# EAGLE schematic 10MHzRefOsc_3V0 (EAGLE 7.2.0), part 1 of 2
DF4IAH - 10 MHz Reference Oscillator

## Sheet 1 of 28: Overview
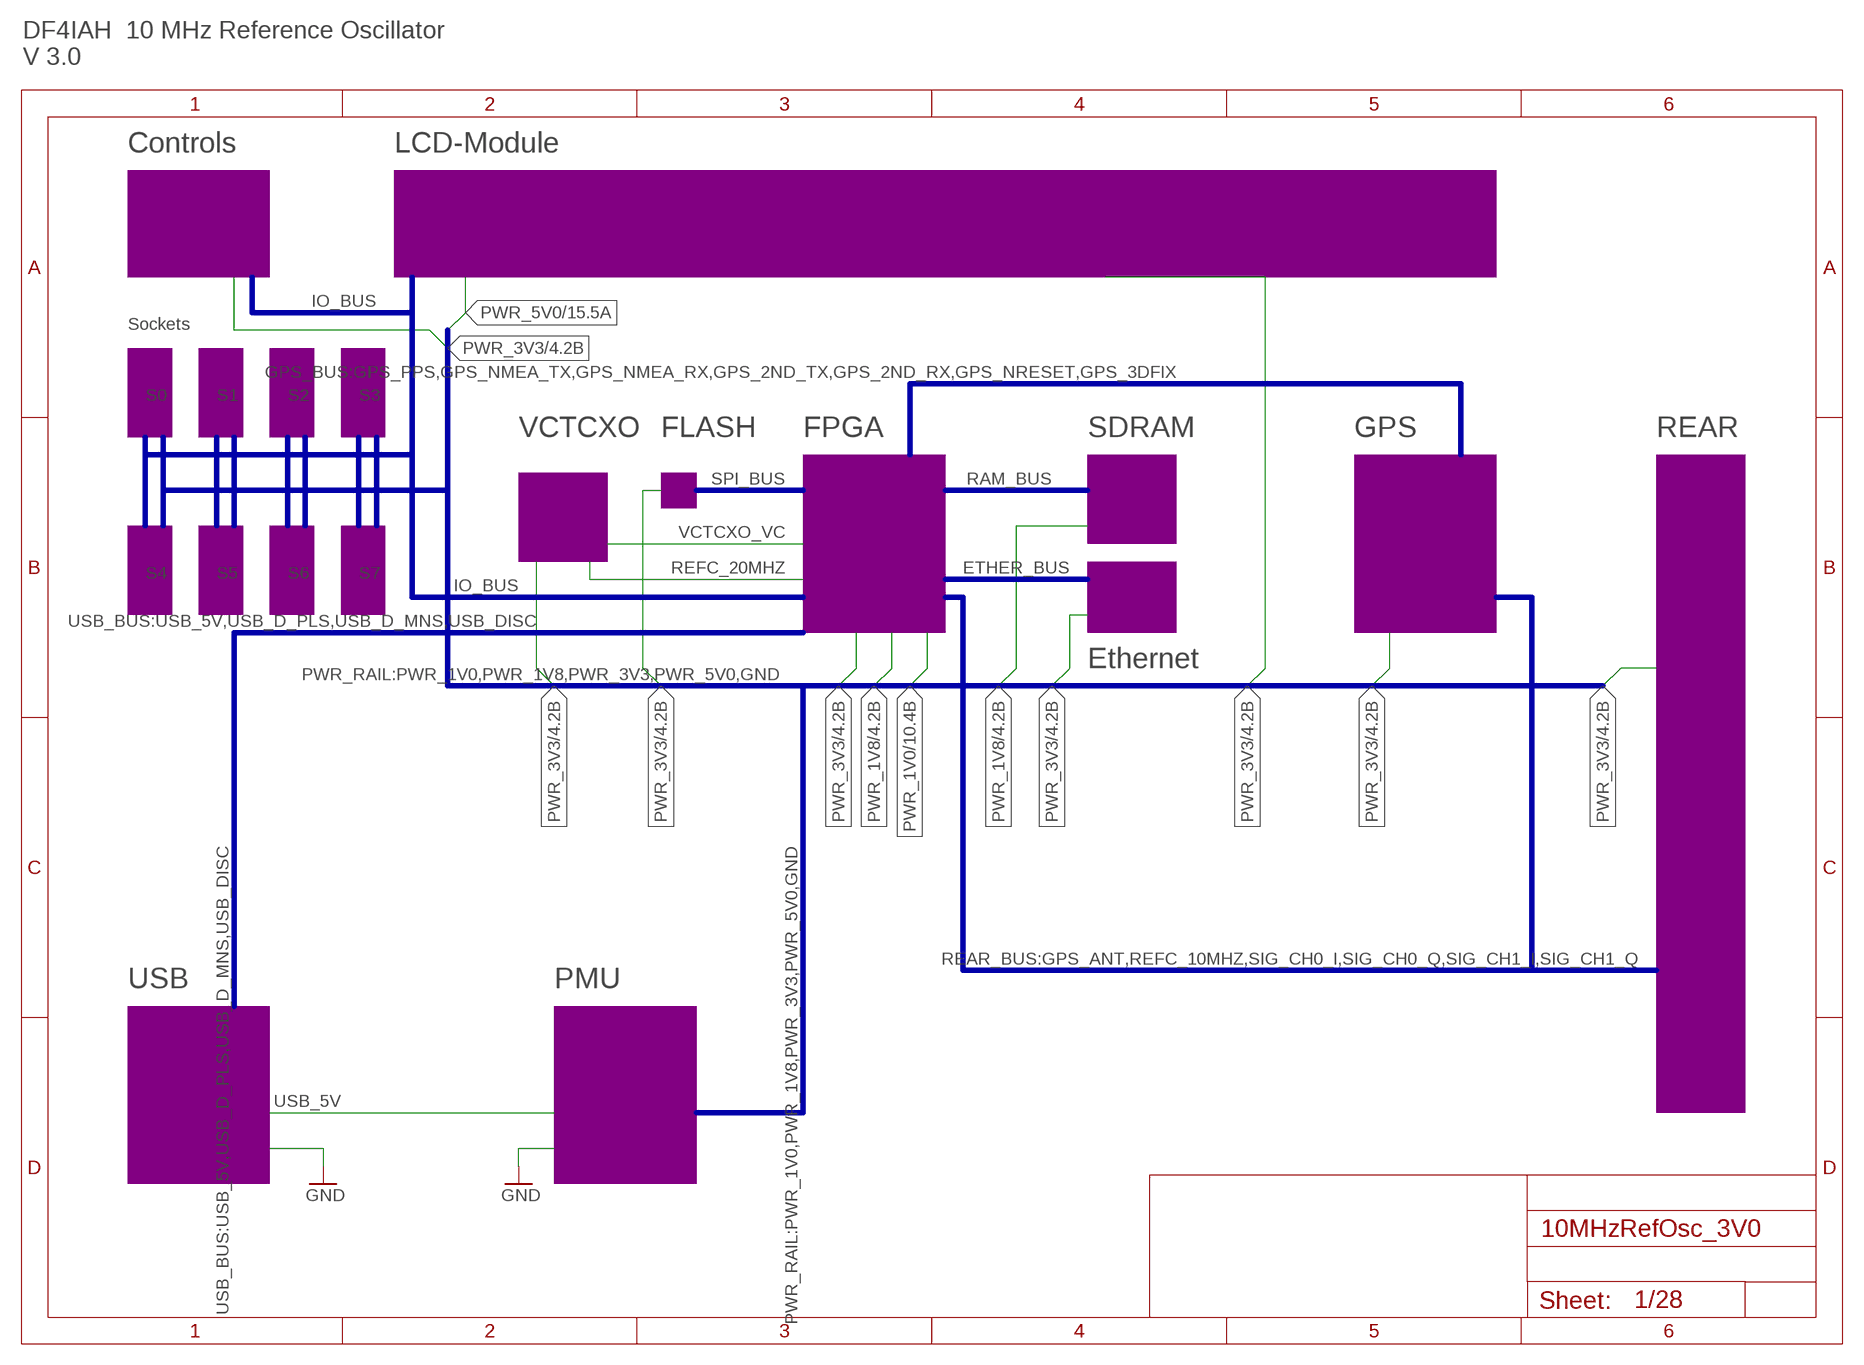
[diagram p0: schematic, sheet 1]

### Buses
USB_BUS:USB_5V,USB_D_PLS,USB_D_MNS,USB_DISC
PWR_RAIL:PWR_1V0,PWR_1V8,PWR_3V3,PWR_5V0,GND
GPS_BUS:GPS_PPS,GPS_NMEA_TX,GPS_NMEA_RX,GPS_2ND_TX,GPS_2ND_RX,GPS_NRESET,GPS_3DFIX
REAR_BUS:GPS_ANT,REFC_10MHZ,SIG_CH0_I,SIG_CH0_Q,SIG_CH1_I,SIG_CH1_Q
IO_BUS
RAM_BUS
ETHER_BUS
SPI_BUS

### Notes on the sheet
- DF4IAH  10 MHz Reference Oscillator
  V 3.0
- Controls | LCD-Module
- Sockets
- S0 | S1 | S2 | S3
- VCTCXO | FLASH | FPGA | SDRAM | GPS | REAR
- S4 | S5 | S6 | S7
- Ethernet
- USB | PMU

## Sheet 2 of 28: PMU
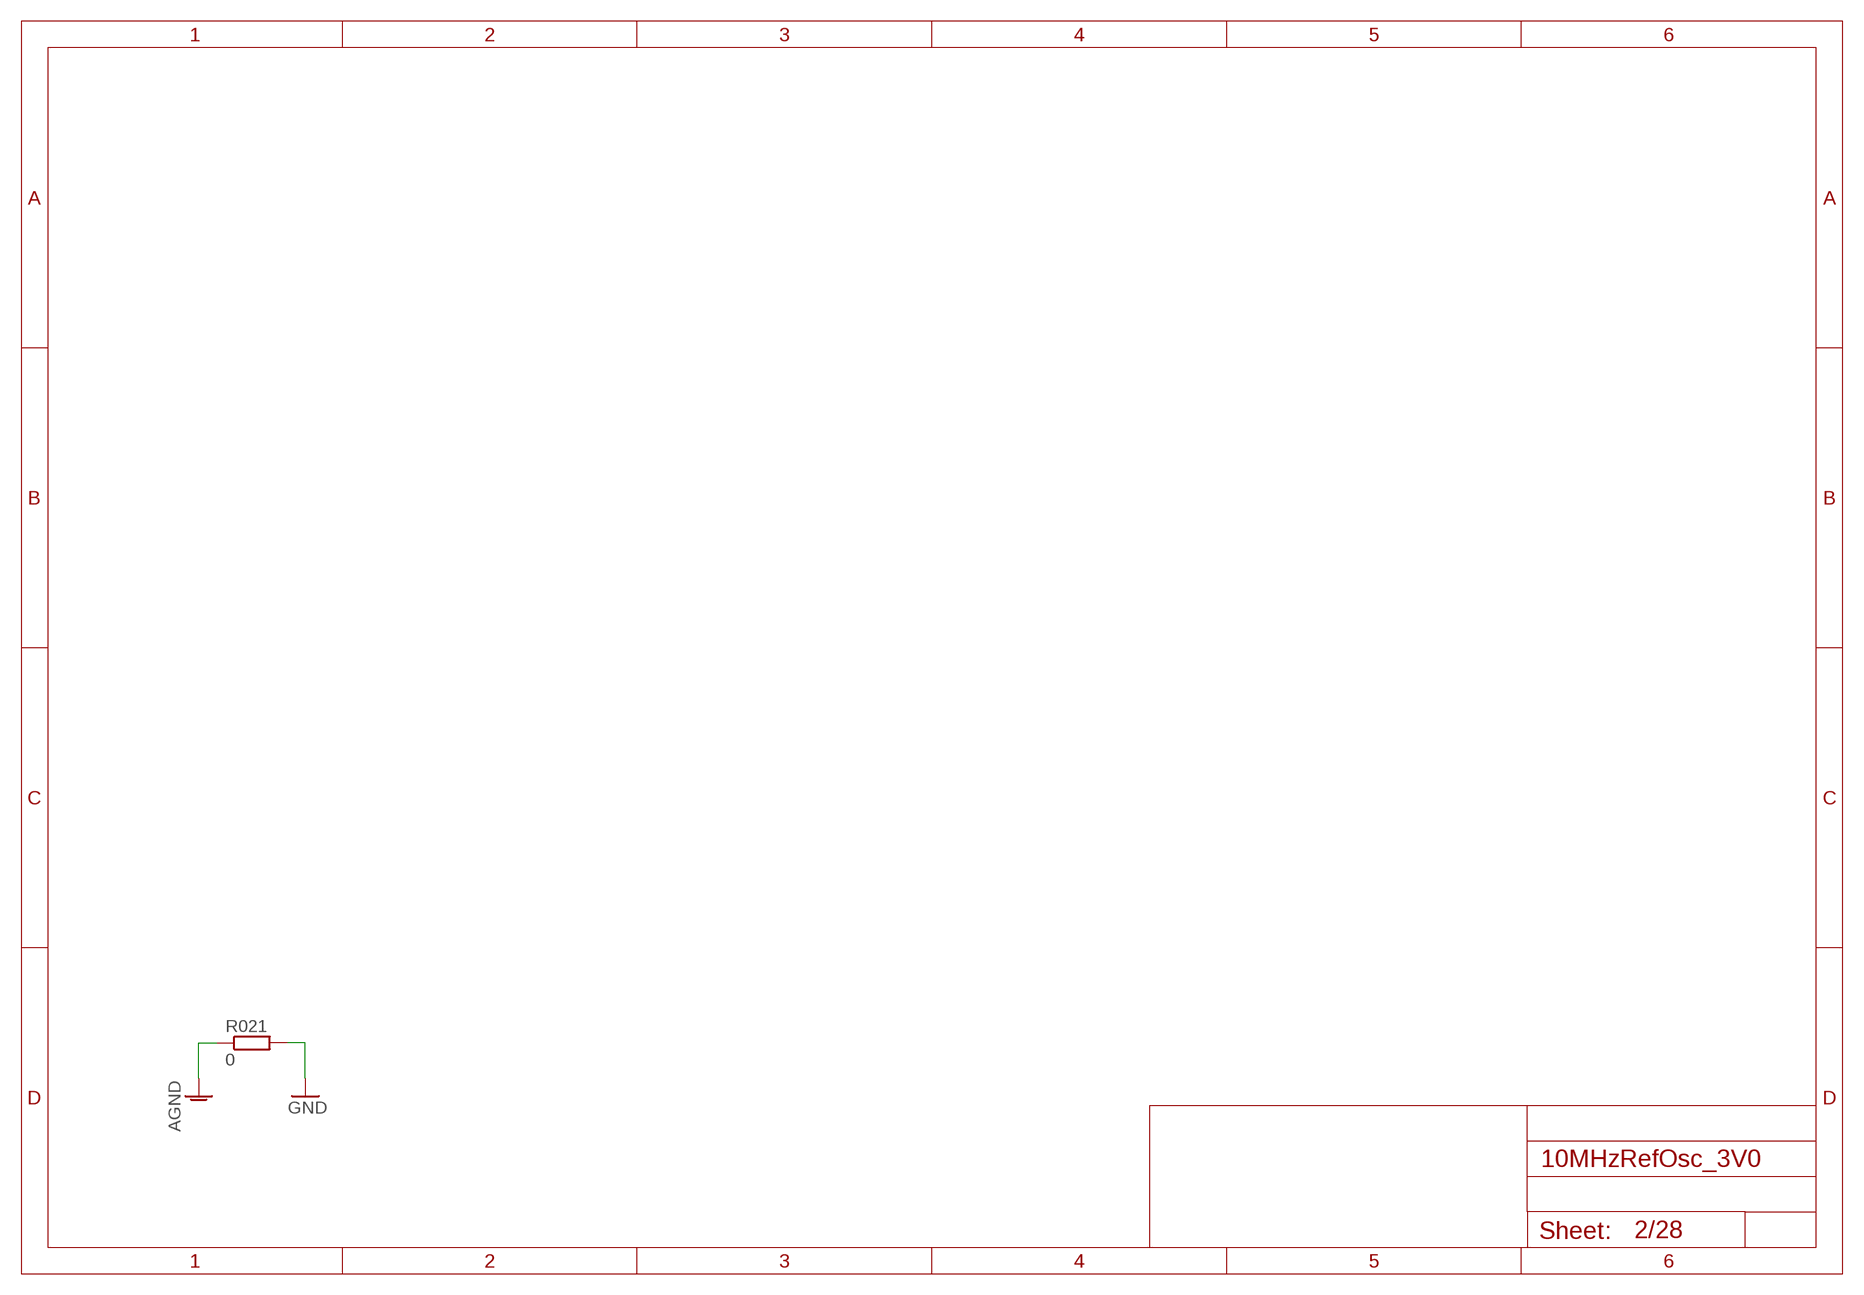
[diagram p1: schematic, sheet 2]

### Parts
R021  0  R-EU_R0805  [R0805]

### Nets
AGND: R021.1 ; also sheet 9
GND: R021.2 ; also sheet 1,3,4,5,6,7,8,9,10,14,15,18,19

## Sheet 3 of 28: VCTCXO
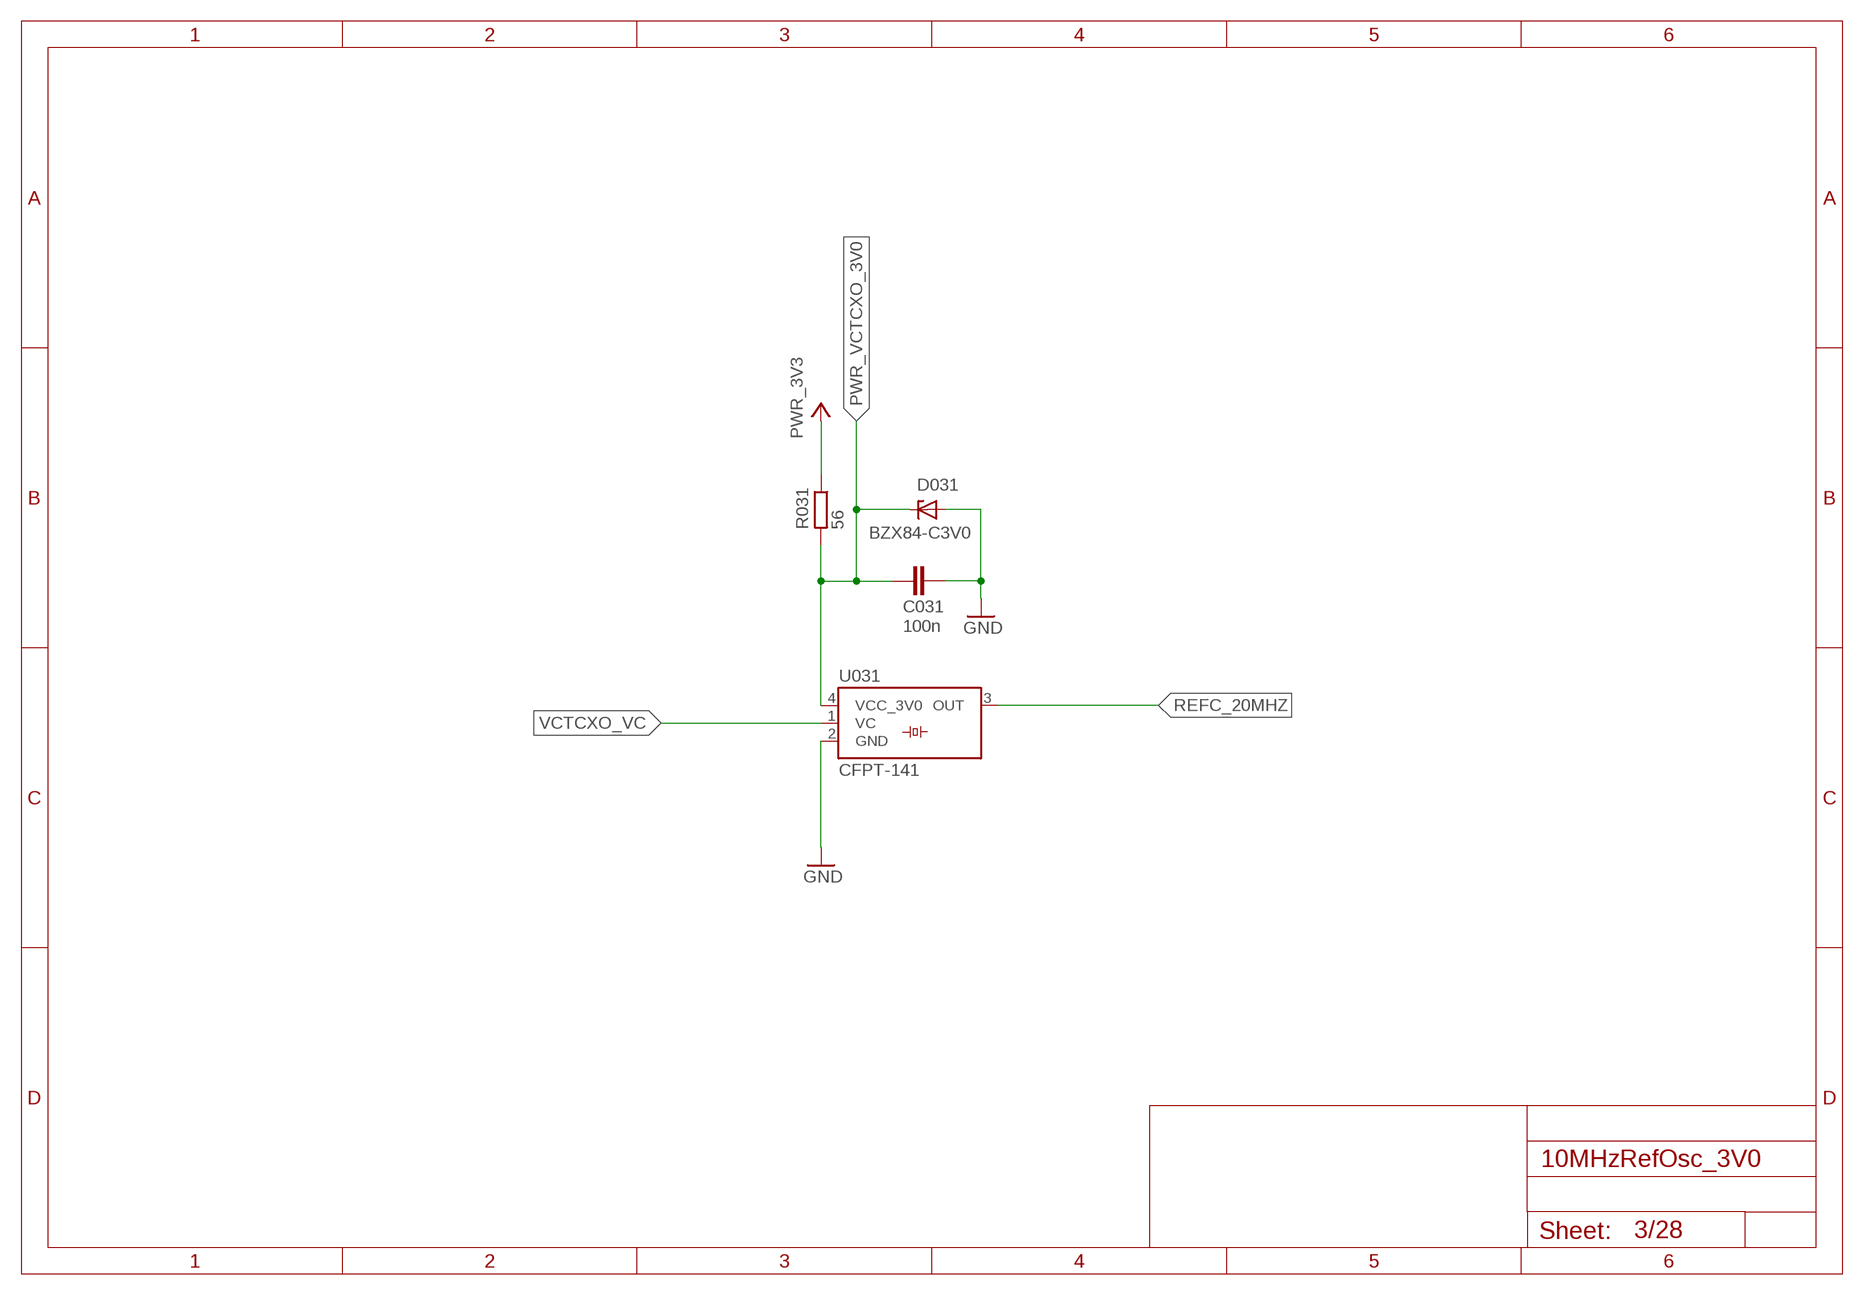
[diagram p2: schematic, sheet 3]

### Parts
C031  100n  C-EUC0805  [C0805]
D031  BZX84-C3V0  BZX84CSMD  [TO236]
R031  56  R-EU_R0805  [R0805]
U031  CFPT-141  [CFPT-141]

### Nets
GND: C031.2 D031.A U031.2(GND) ; also sheet 1,2,4,5,6,7,8,9,10,14,15,18,19
PWR_3V3 [PWR_MED]: R031.1 ; also sheet 1,4,5,6,7,8,15
PWR_VCTCXO_3V0 [PWR_LOW]: C031.1 D031.C R031.2 U031.4(VCC_3V0)
REFC_20MHZ [CLK]: U031.3(OUT) ; also sheet 1
VCTCXO_VC: U031.1(VC) ; also sheet 1

## Sheet 4 of 28: FPGA_B0_1of7
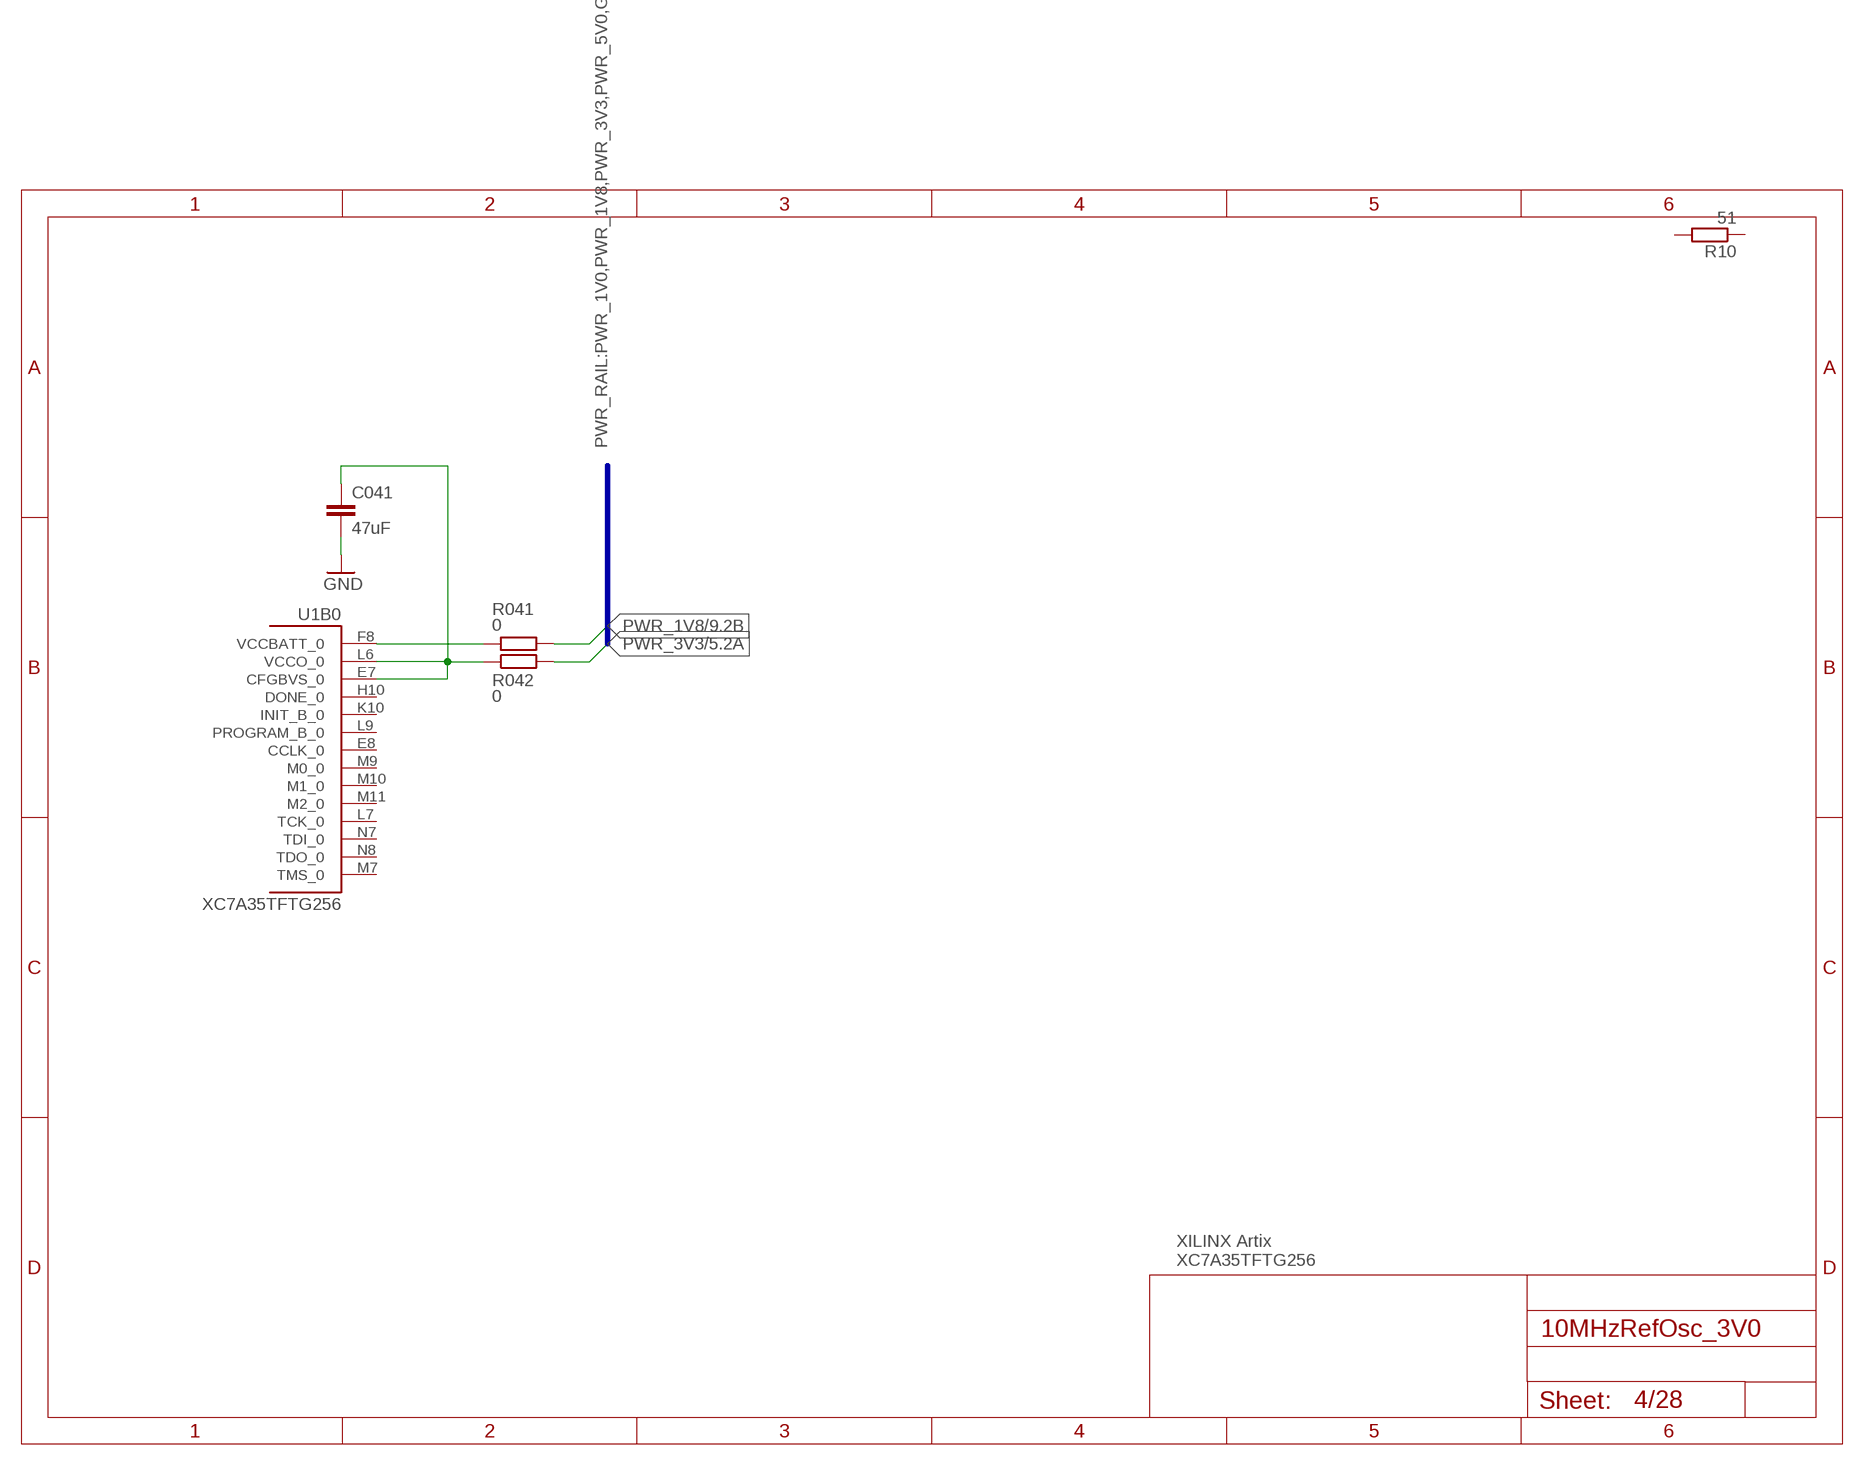
[diagram p3: schematic, sheet 4]

### Parts
C041  47uF  C-EUC0805  [C0805]
R10  51  R-EU_R0805  [R0805]
R041  0  R-EU_R0402  [R0402]
R042  0  R-EU_R0402  [R0402]
U1  XC7A35TFTG256  [FTG256_0MM4]

### Nets
FPGA_VCCBATT: R041.1 U1.F8(B0:VCCBATT_0)
FPGA_VCCO_0: C041.1 R042.1 U1.E7(B0:CFGBVS_0) U1.L6(B0:VCCO_0)
GND: C041.2 ; also sheet 1,2,3,5,6,7,8,9,10,14,15,18,19
PWR_1V8 [PWR_LOW]: R041.2 ; also sheet 1,9,10
PWR_3V3 [PWR_MED]: R042.2 ; also sheet 1,3,5,6,7,8,15
Unconnected: R10.1 R10.2 U1.E8(B0:CCLK_0) U1.H10(B0:DONE_0) U1.K10(B0:INIT_B_0) U1.L7(B0:TCK_0) U1.L9(B0:PROGRAM_B_0) U1.M7(B0:TMS_0) U1.M9(B0:M0_0) U1.M10(B0:M1_0) U1.M11(B0:M2_0) U1.N7(B0:TDI_0) U1.N8(B0:TDO_0)

### Buses
PWR_RAIL:PWR_1V0,PWR_1V8,PWR_3V3,PWR_5V0,GND

### Notes on the sheet
- XILINX Artix
  XC7A35TFTG256

## Sheet 5 of 28: FPGA_B14_2of7
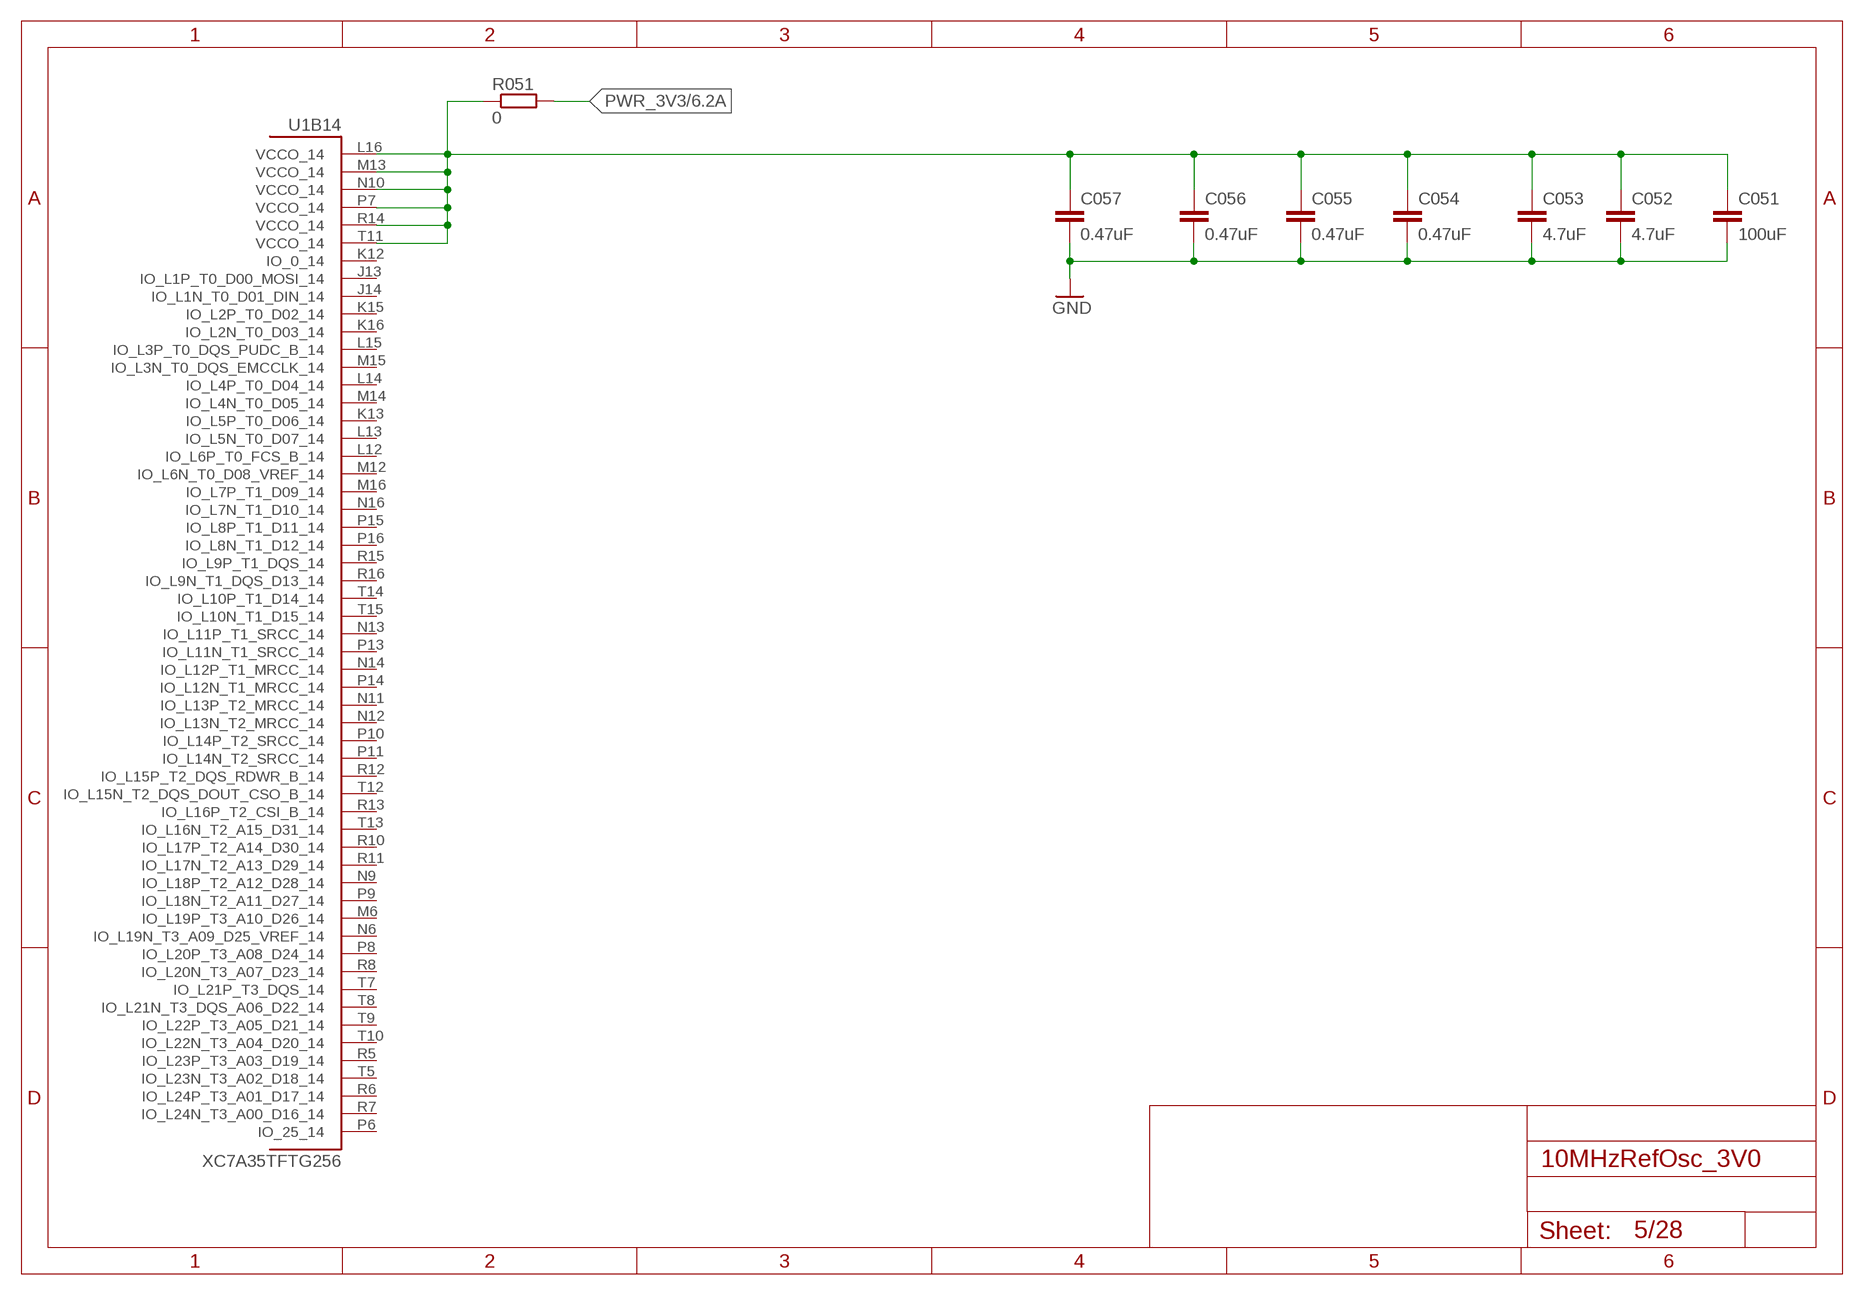
[diagram p4: schematic, sheet 5]

### Parts
C051  100uF  C-EUC1206  [C1206]
C052  4.7uF  C-EUC0402  [C0402]
C053  4.7uF  C-EUC0402  [C0402]
C054  0.47uF  C-EUC0402  [C0402]
C055  0.47uF  C-EUC0402  [C0402]
C056  0.47uF  C-EUC0402  [C0402]
C057  0.47uF  C-EUC0402  [C0402]
R051  0  R-EU_R0402  [R0402]

### Nets
FPGA_VCCO_14: C051.1 C052.1 C053.1 C054.1 C055.1 C056.1 C057.1 R051.1 U1.L16(B14:VCCO_14) U1.M13(B14:VCCO_14) U1.N10(B14:VCCO_14) U1.P7(B14:VCCO_14) U1.R14(B14:VCCO_14) U1.T11(B14:VCCO_14)
GND: C051.2 C052.2 C053.2 C054.2 C055.2 C056.2 C057.2 ; also sheet 1,2,3,4,6,7,8,9,10,14,15,18,19
PWR_3V3 [PWR_MED]: R051.2 ; also sheet 1,3,4,6,7,8,15
Unconnected: U1.J13(B14:IO_L1P_T0_D00_MOSI_14) U1.J14(B14:IO_L1N_T0_D01_DIN_14) U1.K12(B14:IO_0_14) U1.K13(B14:IO_L5P_T0_D06_14) U1.K15(B14:IO_L2P_T0_D02_14) U1.K16(B14:IO_L2N_T0_D03_14) U1.L12(B14:IO_L6P_T0_FCS_B_14) U1.L13(B14:IO_L5N_T0_D07_14) U1.L14(B14:IO_L4P_T0_D04_14) U1.L15(B14:IO_L3P_T0_DQS_PUDC_B_14) U1.M6(B14:IO_L19P_T3_A10_D26_14) U1.M12(B14:IO_L6N_T0_D08_VREF_14) U1.M14(B14:IO_L4N_T0_D05_14) U1.M15(B14:IO_L3N_T0_DQS_EMCCLK_14) U1.M16(B14:IO_L7P_T1_D09_14) U1.N6(B14:IO_L19N_T3_A09_D25_VREF_14) U1.N9(B14:IO_L18P_T2_A12_D28_14) U1.N11(B14:IO_L13P_T2_MRCC_14) U1.N12(B14:IO_L13N_T2_MRCC_14) U1.N13(B14:IO_L11P_T1_SRCC_14) U1.N14(B14:IO_L12P_T1_MRCC_14) U1.N16(B14:IO_L7N_T1_D10_14) U1.P6(B14:IO_25_14) U1.P8(B14:IO_L20P_T3_A08_D24_14) U1.P9(B14:IO_L18N_T2_A11_D27_14) U1.P10(B14:IO_L14P_T2_SRCC_14) U1.P11(B14:IO_L14N_T2_SRCC_14) U1.P13(B14:IO_L11N_T1_SRCC_14) U1.P14(B14:IO_L12N_T1_MRCC_14) U1.P15(B14:IO_L8P_T1_D11_14) U1.P16(B14:IO_L8N_T1_D12_14) U1.R5(B14:IO_L23P_T3_A03_D19_14) U1.R6(B14:IO_L24P_T3_A01_D17_14) U1.R7(B14:IO_L24N_T3_A00_D16_14) U1.R8(B14:IO_L20N_T3_A07_D23_14) U1.R10(B14:IO_L17P_T2_A14_D30_14) U1.R11(B14:IO_L17N_T2_A13_D29_14) U1.R12(B14:IO_L15P_T2_DQS_RDWR_B_14) U1.R13(B14:IO_L16P_T2_CSI_B_14) U1.R15(B14:IO_L9P_T1_DQS_14) U1.R16(B14:IO_L9N_T1_DQS_D13_14) U1.T5(B14:IO_L23N_T3_A02_D18_14) U1.T7(B14:IO_L21P_T3_DQS_14) U1.T8(B14:IO_L21N_T3_DQS_A06_D22_14) U1.T9(B14:IO_L22P_T3_A05_D21_14) U1.T10(B14:IO_L22N_T3_A04_D20_14) U1.T12(B14:IO_L15N_T2_DQS_DOUT_CSO_B_14) U1.T13(B14:IO_L16N_T2_A15_D31_14) U1.T14(B14:IO_L10P_T1_D14_14) U1.T15(B14:IO_L10N_T1_D15_14)

## Sheet 6 of 28: FPGA_B15_3of7
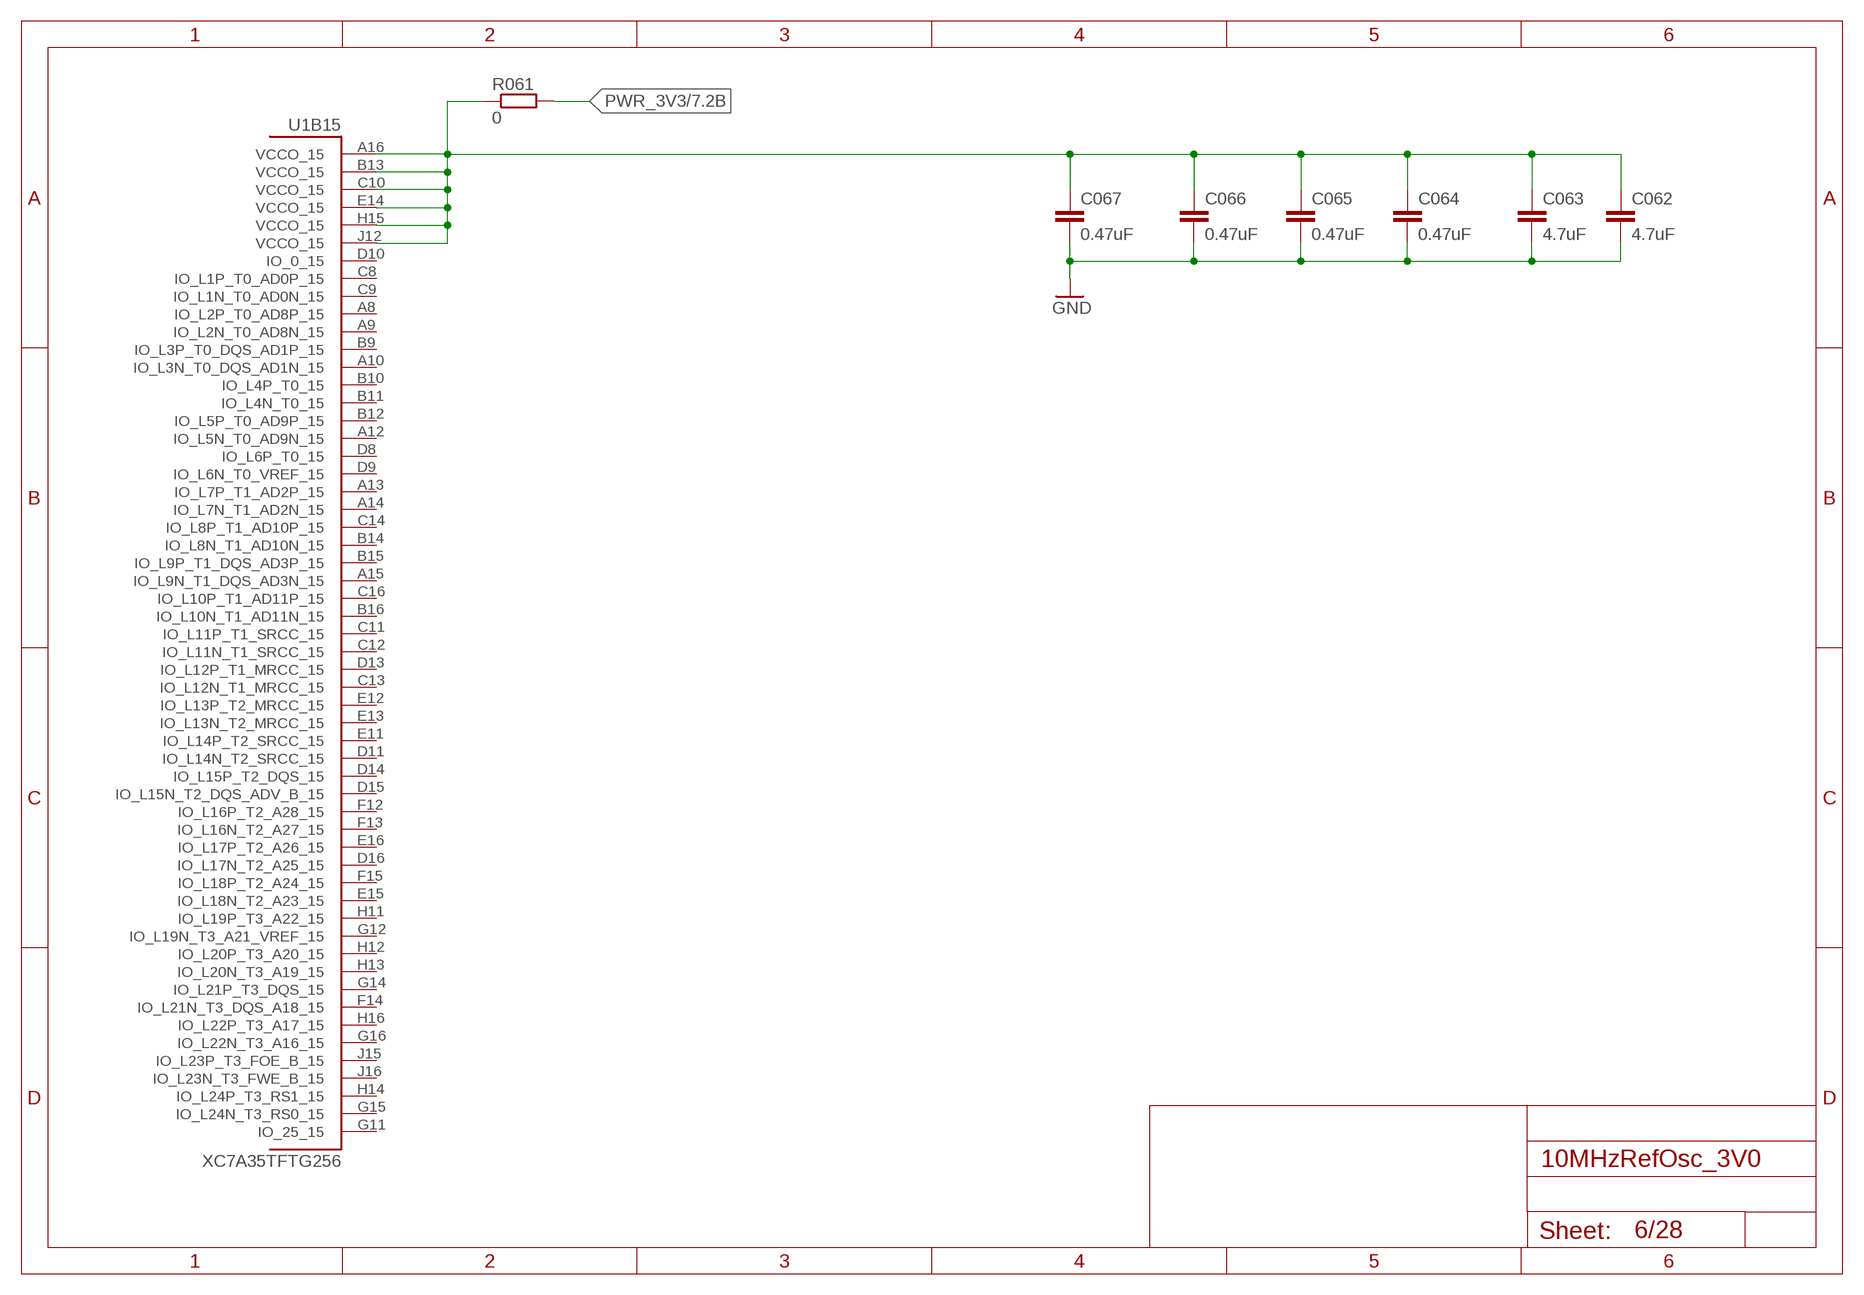
[diagram p5: schematic, sheet 6]

### Parts
C062  4.7uF  C-EUC0402  [C0402]
C063  4.7uF  C-EUC0402  [C0402]
C064  0.47uF  C-EUC0402  [C0402]
C065  0.47uF  C-EUC0402  [C0402]
C066  0.47uF  C-EUC0402  [C0402]
C067  0.47uF  C-EUC0402  [C0402]
R061  0  R-EU_R0402  [R0402]

### Nets
FPGA_VCCO_15: C062.1 C063.1 C064.1 C065.1 C066.1 C067.1 R061.1 U1.A16(B15:VCCO_15) U1.B13(B15:VCCO_15) U1.C10(B15:VCCO_15) U1.E14(B15:VCCO_15) U1.H15(B15:VCCO_15) U1.J12(B15:VCCO_15)
GND: C062.2 C063.2 C064.2 C065.2 C066.2 C067.2 ; also sheet 1,2,3,4,5,7,8,9,10,14,15,18,19
PWR_3V3 [PWR_MED]: R061.2 ; also sheet 1,3,4,5,7,8,15
Unconnected: U1.A8(B15:IO_L2P_T0_AD8P_15) U1.A9(B15:IO_L2N_T0_AD8N_15) U1.A10(B15:IO_L3N_T0_DQS_AD1N_15) U1.A12(B15:IO_L5N_T0_AD9N_15) U1.A13(B15:IO_L7P_T1_AD2P_15) U1.A14(B15:IO_L7N_T1_AD2N_15) U1.A15(B15:IO_L9N_T1_DQS_AD3N_15) U1.B9(B15:IO_L3P_T0_DQS_AD1P_15) U1.B10(B15:IO_L4P_T0_15) U1.B11(B15:IO_L4N_T0_15) U1.B12(B15:IO_L5P_T0_AD9P_15) U1.B14(B15:IO_L8N_T1_AD10N_15) U1.B15(B15:IO_L9P_T1_DQS_AD3P_15) U1.B16(B15:IO_L10N_T1_AD11N_15) U1.C8(B15:IO_L1P_T0_AD0P_15) U1.C9(B15:IO_L1N_T0_AD0N_15) U1.C11(B15:IO_L11P_T1_SRCC_15) U1.C12(B15:IO_L11N_T1_SRCC_15) U1.C13(B15:IO_L12N_T1_MRCC_15) U1.C14(B15:IO_L8P_T1_AD10P_15) U1.C16(B15:IO_L10P_T1_AD11P_15) U1.D8(B15:IO_L6P_T0_15) U1.D9(B15:IO_L6N_T0_VREF_15) U1.D10(B15:IO_0_15) U1.D11(B15:IO_L14N_T2_SRCC_15) U1.D13(B15:IO_L12P_T1_MRCC_15) U1.D14(B15:IO_L15P_T2_DQS_15) U1.D15(B15:IO_L15N_T2_DQS_ADV_B_15) U1.D16(B15:IO_L17N_T2_A25_15) U1.E11(B15:IO_L14P_T2_SRCC_15) U1.E12(B15:IO_L13P_T2_MRCC_15) U1.E13(B15:IO_L13N_T2_MRCC_15) U1.E15(B15:IO_L18N_T2_A23_15) U1.E16(B15:IO_L17P_T2_A26_15) U1.F12(B15:IO_L16P_T2_A28_15) U1.F13(B15:IO_L16N_T2_A27_15) U1.F14(B15:IO_L21N_T3_DQS_A18_15) U1.F15(B15:IO_L18P_T2_A24_15) U1.G11(B15:IO_25_15) U1.G12(B15:IO_L19N_T3_A21_VREF_15) U1.G14(B15:IO_L21P_T3_DQS_15) U1.G15(B15:IO_L24N_T3_RS0_15) U1.G16(B15:IO_L22N_T3_A16_15) U1.H11(B15:IO_L19P_T3_A22_15) U1.H12(B15:IO_L20P_T3_A20_15) U1.H13(B15:IO_L20N_T3_A19_15) U1.H14(B15:IO_L24P_T3_RS1_15) U1.H16(B15:IO_L22P_T3_A17_15) U1.J15(B15:IO_L23P_T3_FOE_B_15) U1.J16(B15:IO_L23N_T3_FWE_B_15)

## Sheet 7 of 28: FPGA_B34_4of7
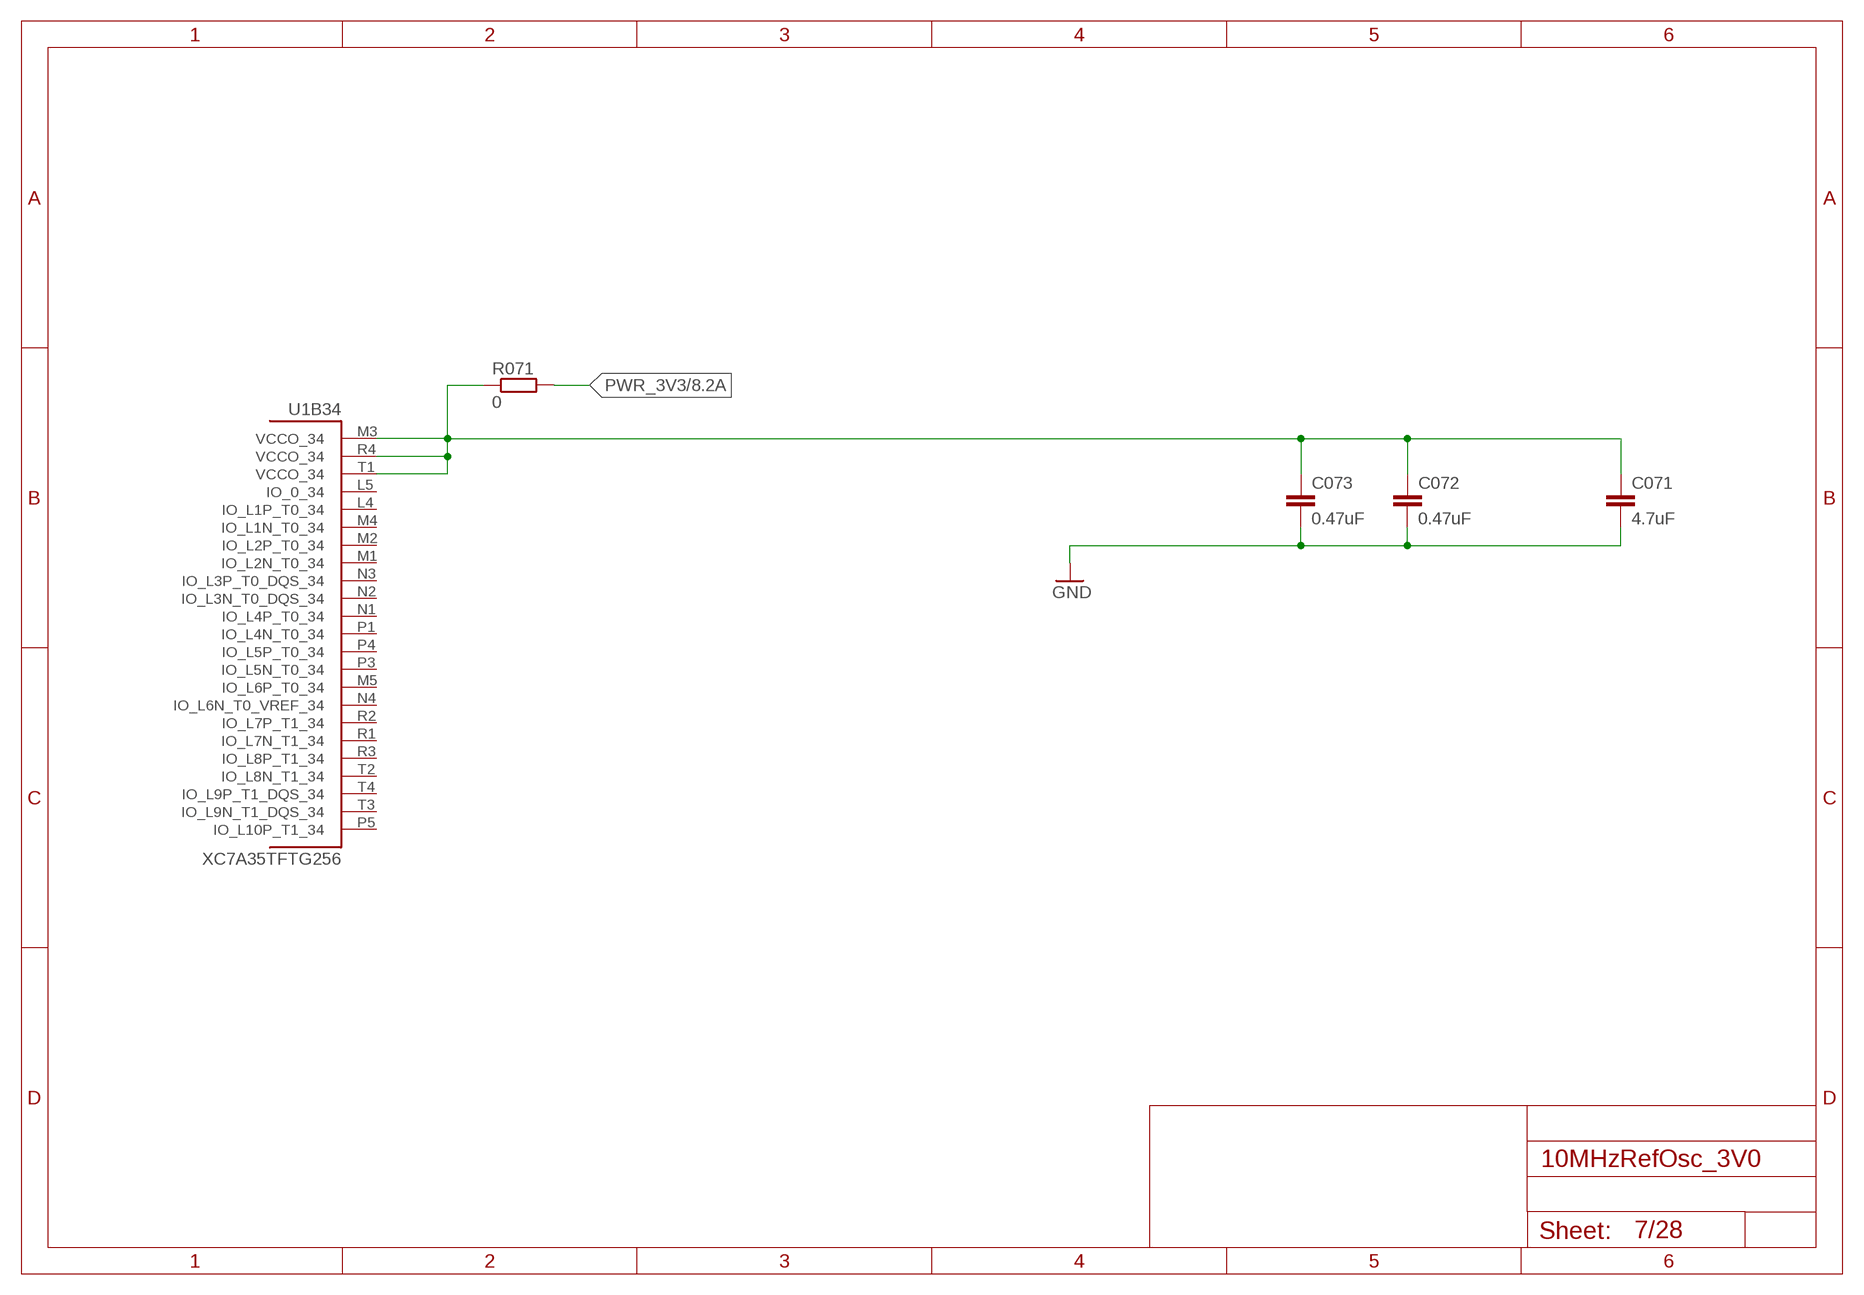
[diagram p6: schematic, sheet 7]

### Parts
C071  4.7uF  C-EUC0402  [C0402]
C072  0.47uF  C-EUC0402  [C0402]
C073  0.47uF  C-EUC0402  [C0402]
R071  0  R-EU_R0402  [R0402]

### Nets
FPGA_VCCO_34: C071.1 C072.1 C073.1 R071.1 U1.M3(B34:VCCO_34) U1.R4(B34:VCCO_34) U1.T1(B34:VCCO_34)
GND: C071.2 C072.2 C073.2 ; also sheet 1,2,3,4,5,6,8,9,10,14,15,18,19
PWR_3V3 [PWR_MED]: R071.2 ; also sheet 1,3,4,5,6,8,15
Unconnected: U1.L4(B34:IO_L1P_T0_34) U1.L5(B34:IO_0_34) U1.M1(B34:IO_L2N_T0_34) U1.M2(B34:IO_L2P_T0_34) U1.M4(B34:IO_L1N_T0_34) U1.M5(B34:IO_L6P_T0_34) U1.N1(B34:IO_L4P_T0_34) U1.N2(B34:IO_L3N_T0_DQS_34) U1.N3(B34:IO_L3P_T0_DQS_34) U1.N4(B34:IO_L6N_T0_VREF_34) U1.P1(B34:IO_L4N_T0_34) U1.P3(B34:IO_L5N_T0_34) U1.P4(B34:IO_L5P_T0_34) U1.P5(B34:IO_L10P_T1_34) U1.R1(B34:IO_L7N_T1_34) U1.R2(B34:IO_L7P_T1_34) U1.R3(B34:IO_L8P_T1_34) U1.T2(B34:IO_L8N_T1_34) U1.T3(B34:IO_L9N_T1_DQS_34) U1.T4(B34:IO_L9P_T1_DQS_34)

## Sheet 8 of 28: FPGA_B35_5of7
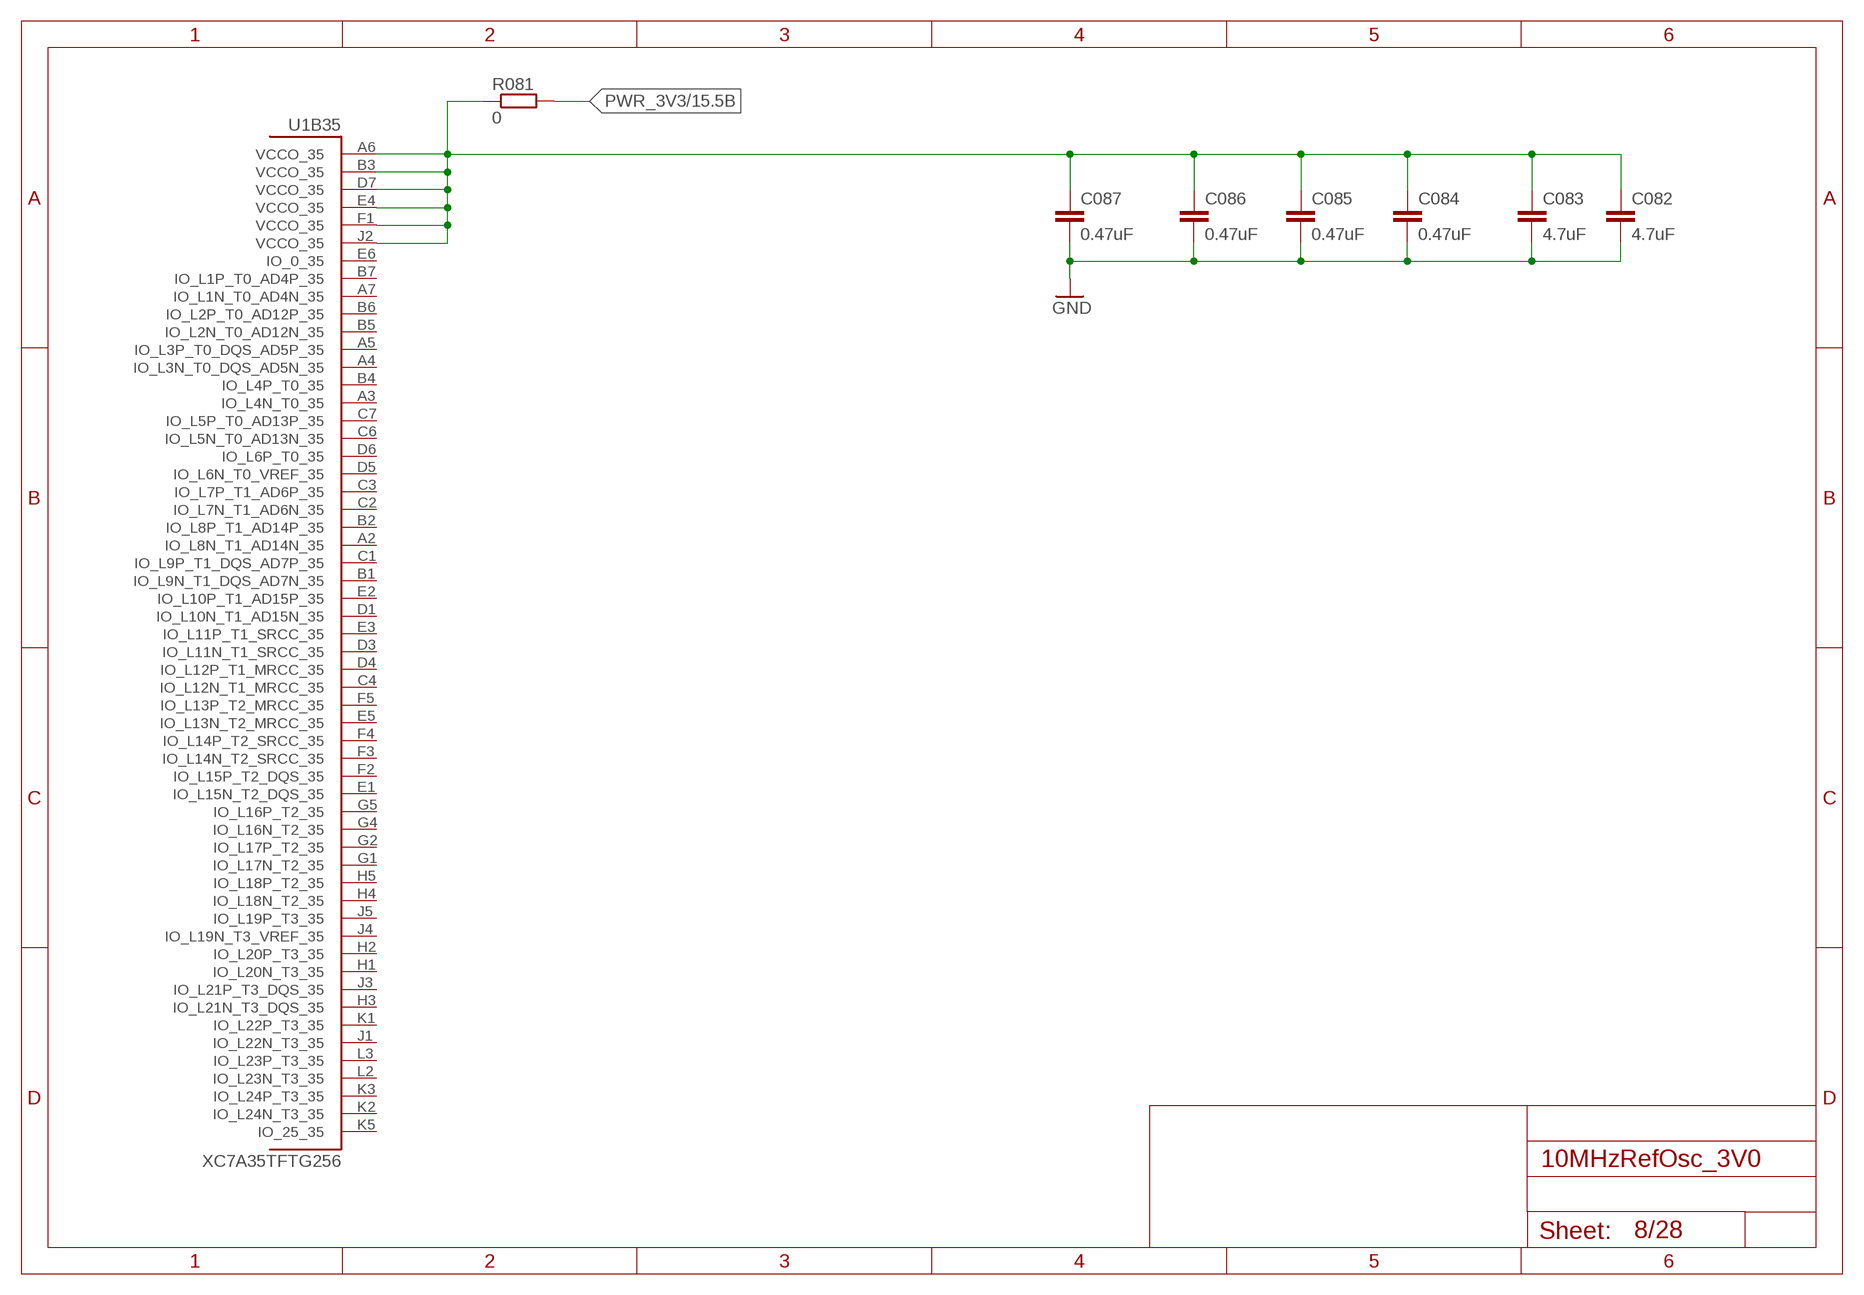
[diagram p7: schematic, sheet 8]

### Parts
C082  4.7uF  C-EUC0402  [C0402]
C083  4.7uF  C-EUC0402  [C0402]
C084  0.47uF  C-EUC0402  [C0402]
C085  0.47uF  C-EUC0402  [C0402]
C086  0.47uF  C-EUC0402  [C0402]
C087  0.47uF  C-EUC0402  [C0402]
R081  0  R-EU_R0402  [R0402]

### Nets
FPGA_VCCO_35: C082.1 C083.1 C084.1 C085.1 C086.1 C087.1 R081.1 U1.A6(B35:VCCO_35) U1.B3(B35:VCCO_35) U1.D7(B35:VCCO_35) U1.E4(B35:VCCO_35) U1.F1(B35:VCCO_35) U1.J2(B35:VCCO_35)
GND: C082.2 C083.2 C084.2 C085.2 C086.2 C087.2 ; also sheet 1,2,3,4,5,6,7,9,10,14,15,18,19
PWR_3V3 [PWR_MED]: R081.2 ; also sheet 1,3,4,5,6,7,15
Unconnected: U1.A2(B35:IO_L8N_T1_AD14N_35) U1.A3(B35:IO_L4N_T0_35) U1.A4(B35:IO_L3N_T0_DQS_AD5N_35) U1.A5(B35:IO_L3P_T0_DQS_AD5P_35) U1.A7(B35:IO_L1N_T0_AD4N_35) U1.B1(B35:IO_L9N_T1_DQS_AD7N_35) U1.B2(B35:IO_L8P_T1_AD14P_35) U1.B4(B35:IO_L4P_T0_35) U1.B5(B35:IO_L2N_T0_AD12N_35) U1.B6(B35:IO_L2P_T0_AD12P_35) U1.B7(B35:IO_L1P_T0_AD4P_35) U1.C1(B35:IO_L9P_T1_DQS_AD7P_35) U1.C2(B35:IO_L7N_T1_AD6N_35) U1.C3(B35:IO_L7P_T1_AD6P_35) U1.C4(B35:IO_L12N_T1_MRCC_35) U1.C6(B35:IO_L5N_T0_AD13N_35) U1.C7(B35:IO_L5P_T0_AD13P_35) U1.D1(B35:IO_L10N_T1_AD15N_35) U1.D3(B35:IO_L11N_T1_SRCC_35) U1.D4(B35:IO_L12P_T1_MRCC_35) U1.D5(B35:IO_L6N_T0_VREF_35) U1.D6(B35:IO_L6P_T0_35) U1.E1(B35:IO_L15N_T2_DQS_35) U1.E2(B35:IO_L10P_T1_AD15P_35) U1.E3(B35:IO_L11P_T1_SRCC_35) U1.E5(B35:IO_L13N_T2_MRCC_35) U1.E6(B35:IO_0_35) U1.F2(B35:IO_L15P_T2_DQS_35) U1.F3(B35:IO_L14N_T2_SRCC_35) U1.F4(B35:IO_L14P_T2_SRCC_35) U1.F5(B35:IO_L13P_T2_MRCC_35) U1.G1(B35:IO_L17N_T2_35) U1.G2(B35:IO_L17P_T2_35) U1.G4(B35:IO_L16N_T2_35) U1.G5(B35:IO_L16P_T2_35) U1.H1(B35:IO_L20N_T3_35) U1.H2(B35:IO_L20P_T3_35) U1.H3(B35:IO_L21N_T3_DQS_35) U1.H4(B35:IO_L18N_T2_35) U1.H5(B35:IO_L18P_T2_35) U1.J1(B35:IO_L22N_T3_35) U1.J3(B35:IO_L21P_T3_DQS_35) U1.J4(B35:IO_L19N_T3_VREF_35) U1.J5(B35:IO_L19P_T3_35) U1.K1(B35:IO_L22P_T3_35) U1.K2(B35:IO_L24N_T3_35) U1.K3(B35:IO_L24P_T3_35) U1.K5(B35:IO_25_35) U1.L2(B35:IO_L23N_T3_35) U1.L3(B35:IO_L23P_T3_35)

## Sheet 9 of 28: FPGA_BADC_6of7
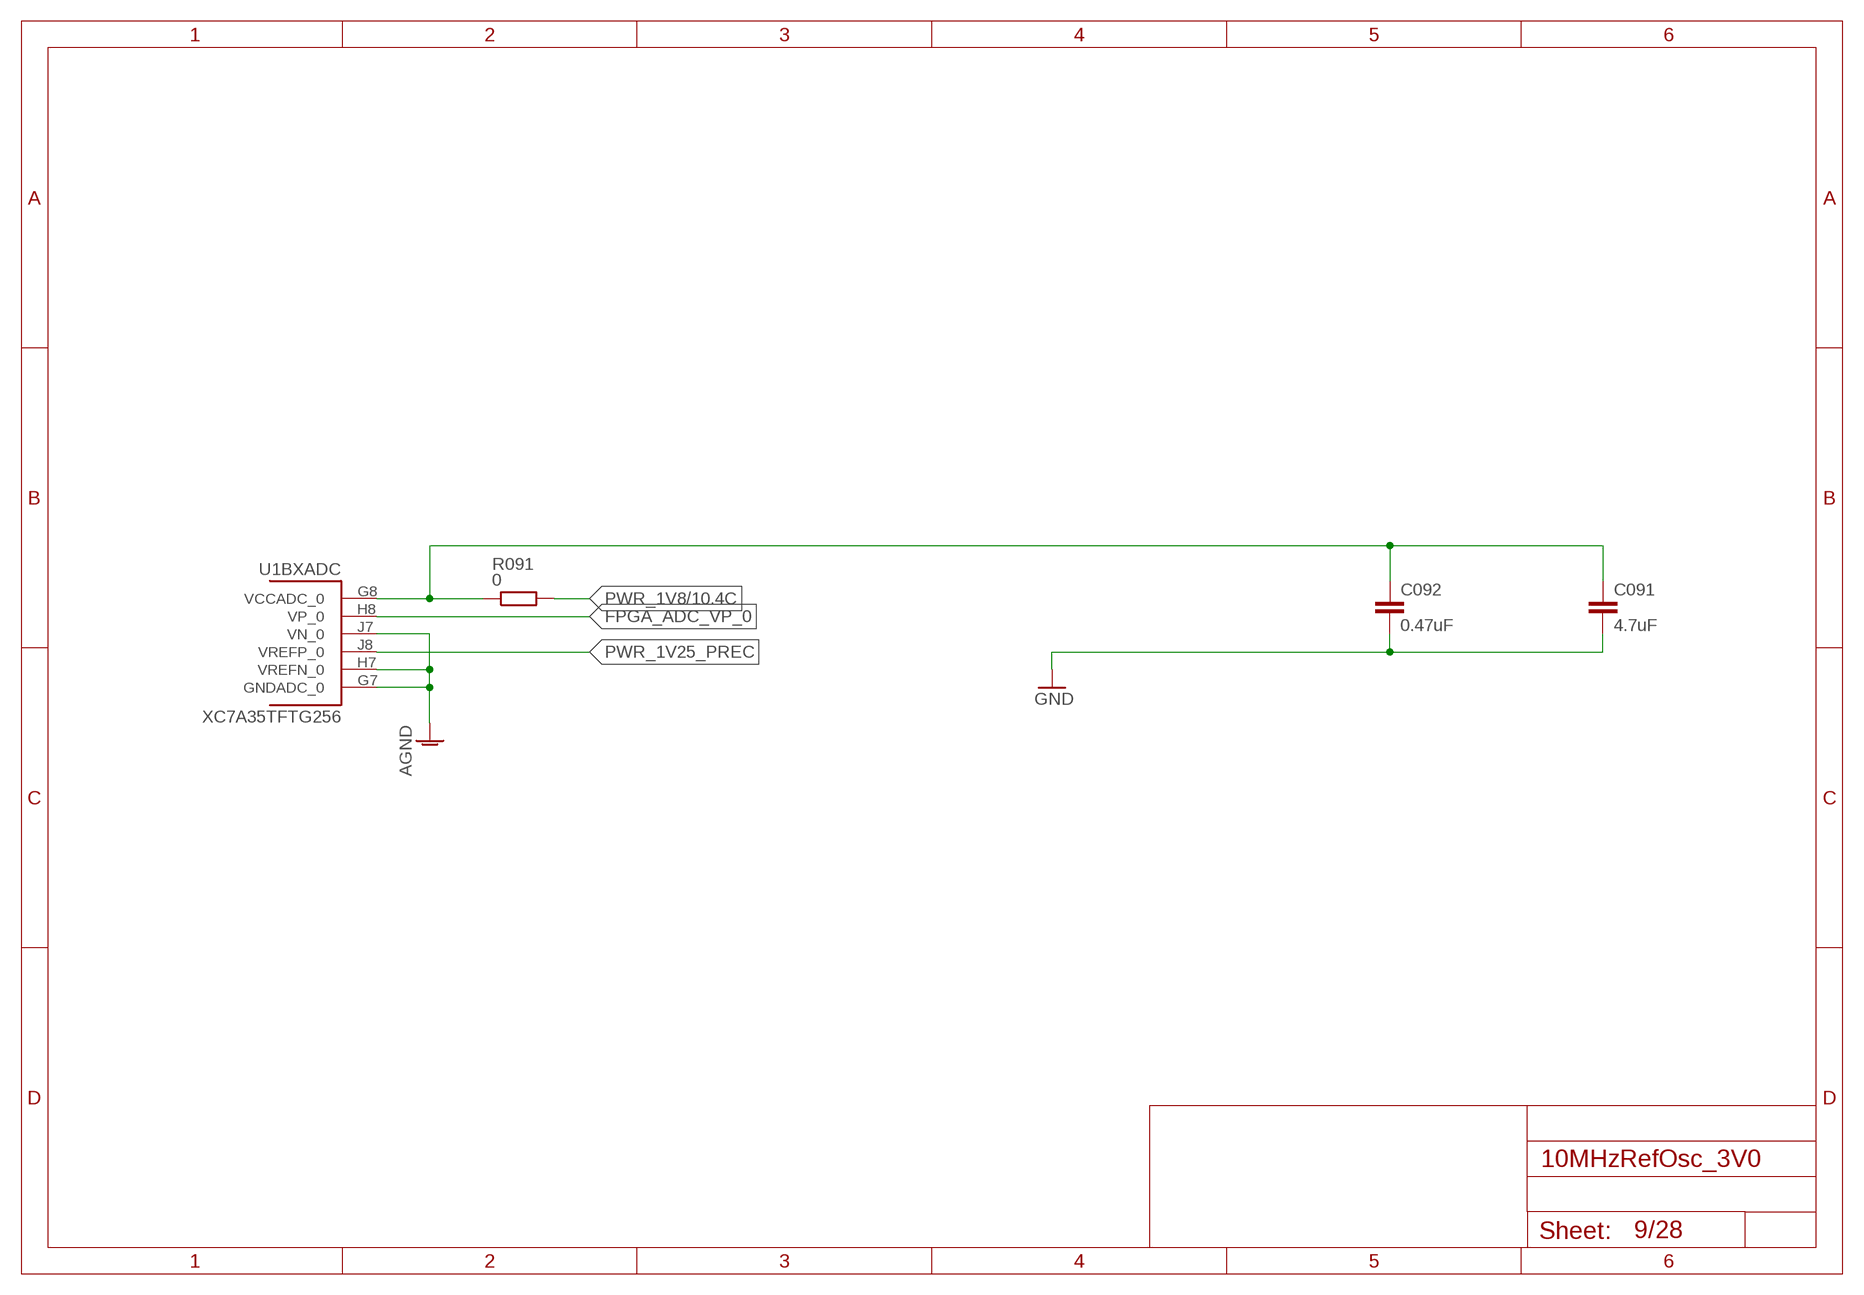
[diagram p8: schematic, sheet 9]

### Parts
C091  4.7uF  C-EUC0402  [C0402]
C092  0.47uF  C-EUC0402  [C0402]
R091  0  R-EU_R0402  [R0402]

### Nets
AGND: U1.G7(BXADC:GNDADC_0) U1.H7(BXADC:VREFN_0) U1.J7(BXADC:VN_0) ; also sheet 2
FPGA_ADC_VP_0: U1.H8(BXADC:VP_0)
FPGA_VCCADC_0: C091.1 C092.1 R091.1 U1.G8(BXADC:VCCADC_0)
GND: C091.2 C092.2 ; also sheet 1,2,3,4,5,6,7,8,10,14,15,18,19
PWR_1V8 [PWR_LOW]: R091.2 ; also sheet 1,4,10
PWR_1V25_PREC: U1.J8(BXADC:VREFP_0)

## Sheet 10 of 28: FPGA_SUPPLY_7of7
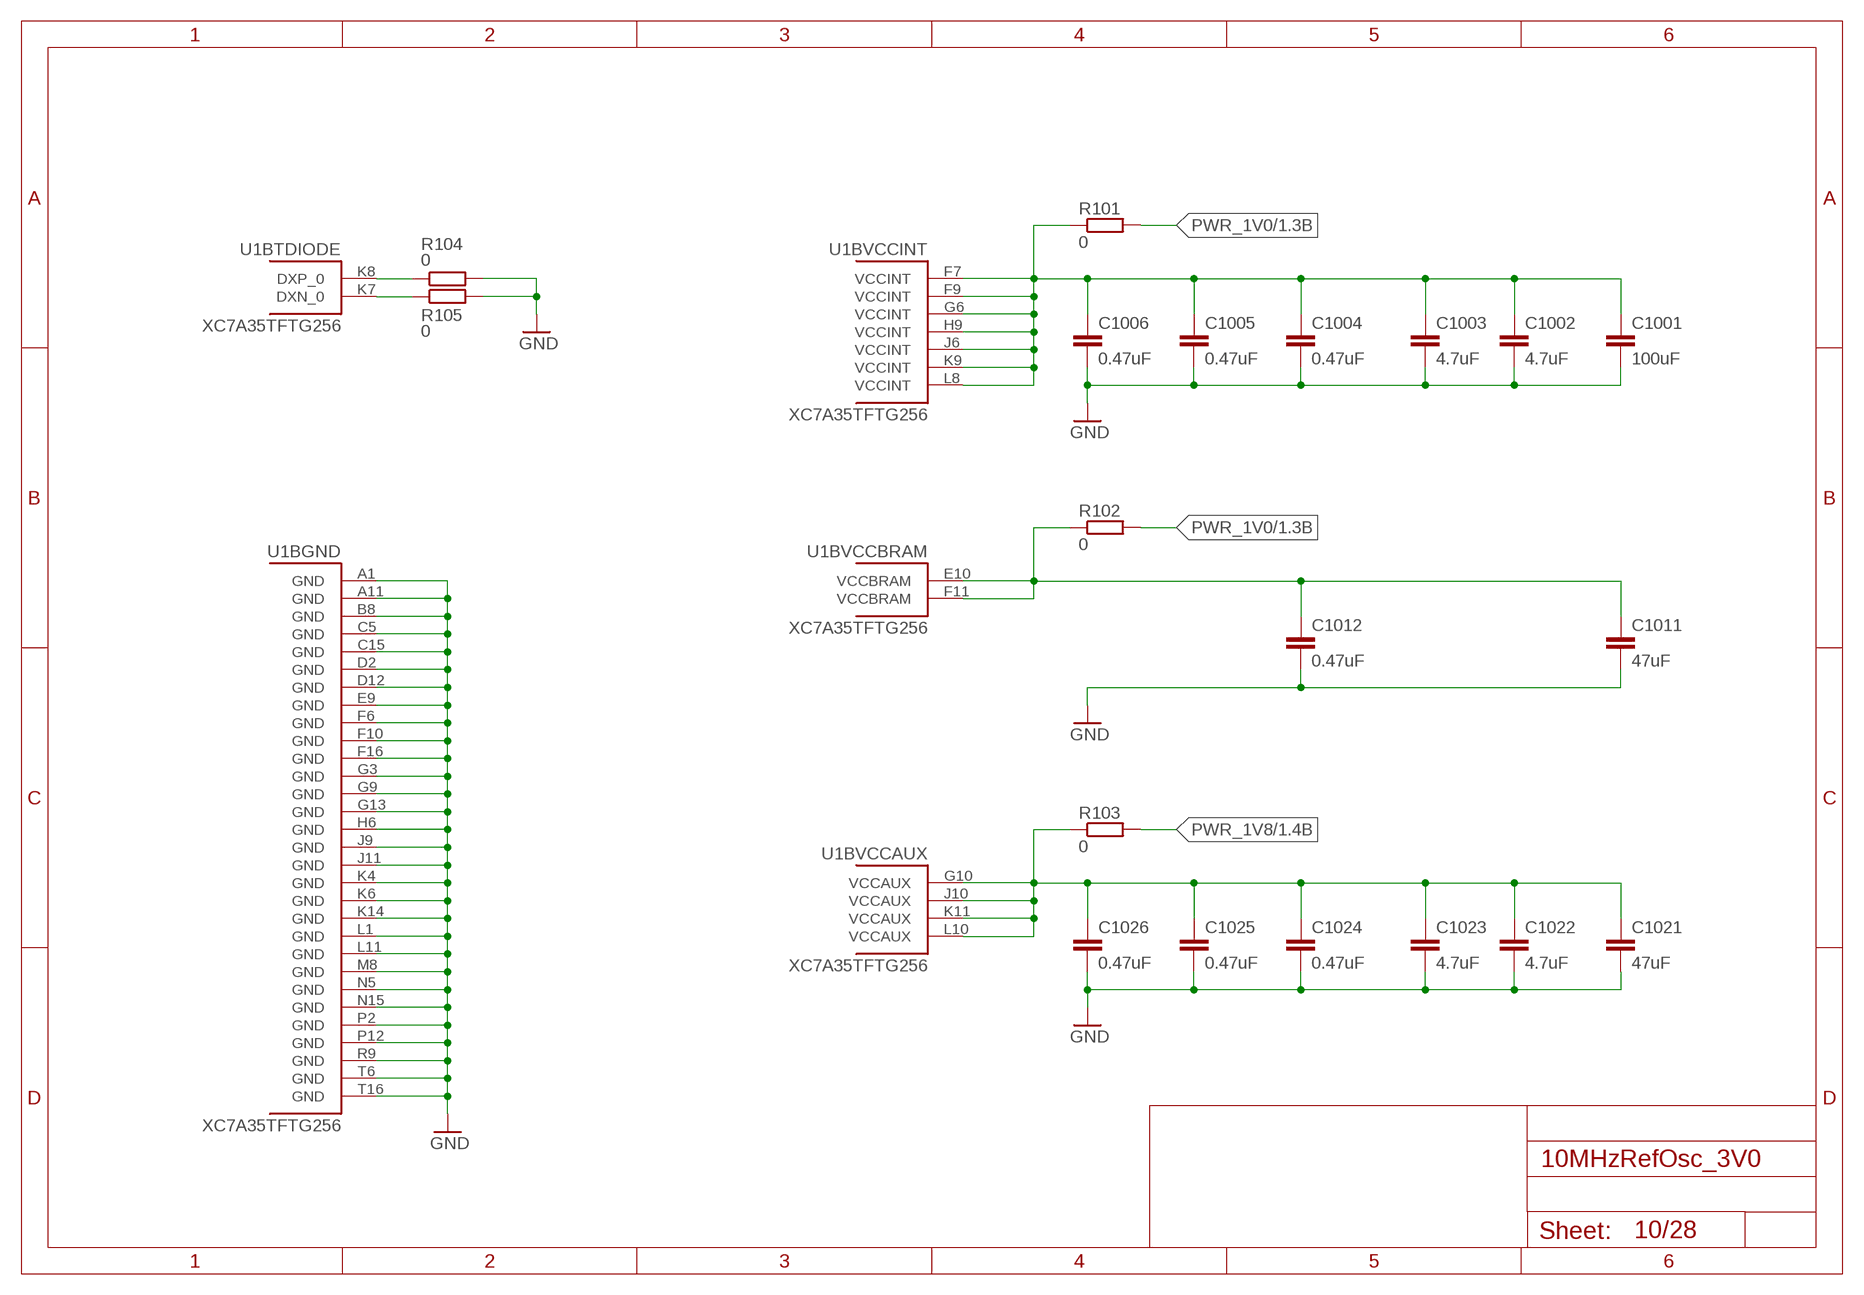
[diagram p9: schematic, sheet 10]

### Parts
C1001  100uF  C-EUC1206  [C1206]
C1002  4.7uF  C-EUC0402  [C0402]
C1003  4.7uF  C-EUC0402  [C0402]
C1004  0.47uF  C-EUC0402  [C0402]
C1005  0.47uF  C-EUC0402  [C0402]
C1006  0.47uF  C-EUC0402  [C0402]
C1011  47uF  C-EUC0805  [C0805]
C1012  0.47uF  C-EUC0402  [C0402]
C1021  47uF  C-EUC0805  [C0805]
C1022  4.7uF  C-EUC0402  [C0402]
C1023  4.7uF  C-EUC0402  [C0402]
C1024  0.47uF  C-EUC0402  [C0402]
C1025  0.47uF  C-EUC0402  [C0402]
C1026  0.47uF  C-EUC0402  [C0402]
R101  0  R-EU_R0402  [R0402]
R102  0  R-EU_R0402  [R0402]
R103  0  R-EU_R0402  [R0402]
R104  0  R-EU_R0402  [R0402]
R105  0  R-EU_R0402  [R0402]

### Nets
FPGA_DXN_0: R105.1 U1.K7(BTDIODE:DXN_0)
FPGA_DXP_0: R104.1 U1.K8(BTDIODE:DXP_0)
FPGA_VCCAUX: C1021.1 C1022.1 C1023.1 C1024.1 C1025.1 C1026.1 R103.1 U1.G10(BVCCAUX:VCCAUX) U1.J10(BVCCAUX:VCCAUX) U1.K11(BVCCAUX:VCCAUX) U1.L10(BVCCAUX:VCCAUX)
FPGA_VCCBRAM: C1011.1 C1012.1 R102.1 U1.E10(BVCCBRAM:VCCBRAM) U1.F11(BVCCBRAM:VCCBRAM)
FPGA_VCCINT: C1001.1 C1002.1 C1003.1 C1004.1 C1005.1 C1006.1 R101.1 U1.F7(BVCCINT:VCCINT) U1.F9(BVCCINT:VCCINT) U1.G6(BVCCINT:VCCINT) U1.H9(BVCCINT:VCCINT) U1.J6(BVCCINT:VCCINT) U1.K9(BVCCINT:VCCINT) U1.L8(BVCCINT:VCCINT)
GND: C1001.2 C1002.2 C1003.2 C1004.2 C1005.2 C1006.2 C1011.2 C1012.2 C1021.2 C1022.2 C1023.2 C1024.2 C1025.2 C1026.2 R104.2 R105.2 U1.A1(BGND:GND) U1.A11(BGND:GND) U1.B8(BGND:GND) U1.C5(BGND:GND) U1.C15(BGND:GND) U1.D2(BGND:GND) U1.D12(BGND:GND) U1.E9(BGND:GND) U1.F6(BGND:GND) U1.F10(BGND:GND) U1.F16(BGND:GND) U1.G3(BGND:GND) U1.G9(BGND:GND) U1.G13(BGND:GND) U1.H6(BGND:GND) U1.J9(BGND:GND) U1.J11(BGND:GND) U1.K4(BGND:GND) U1.K6(BGND:GND) U1.K14(BGND:GND) U1.L1(BGND:GND) U1.L11(BGND:GND) U1.M8(BGND:GND) U1.N5(BGND:GND) U1.N15(BGND:GND) U1.P2(BGND:GND) U1.P12(BGND:GND) U1.R9(BGND:GND) U1.T6(BGND:GND) U1.T16(BGND:GND) ; also sheet 1,2,3,4,5,6,7,8,9,14,15,18,19
PWR_1V0 [PWR_LOW]: R101.2 R102.2 ; also sheet 1
PWR_1V8 [PWR_LOW]: R103.2 ; also sheet 1,4,9

## Sheet 11 of 28: FLASH
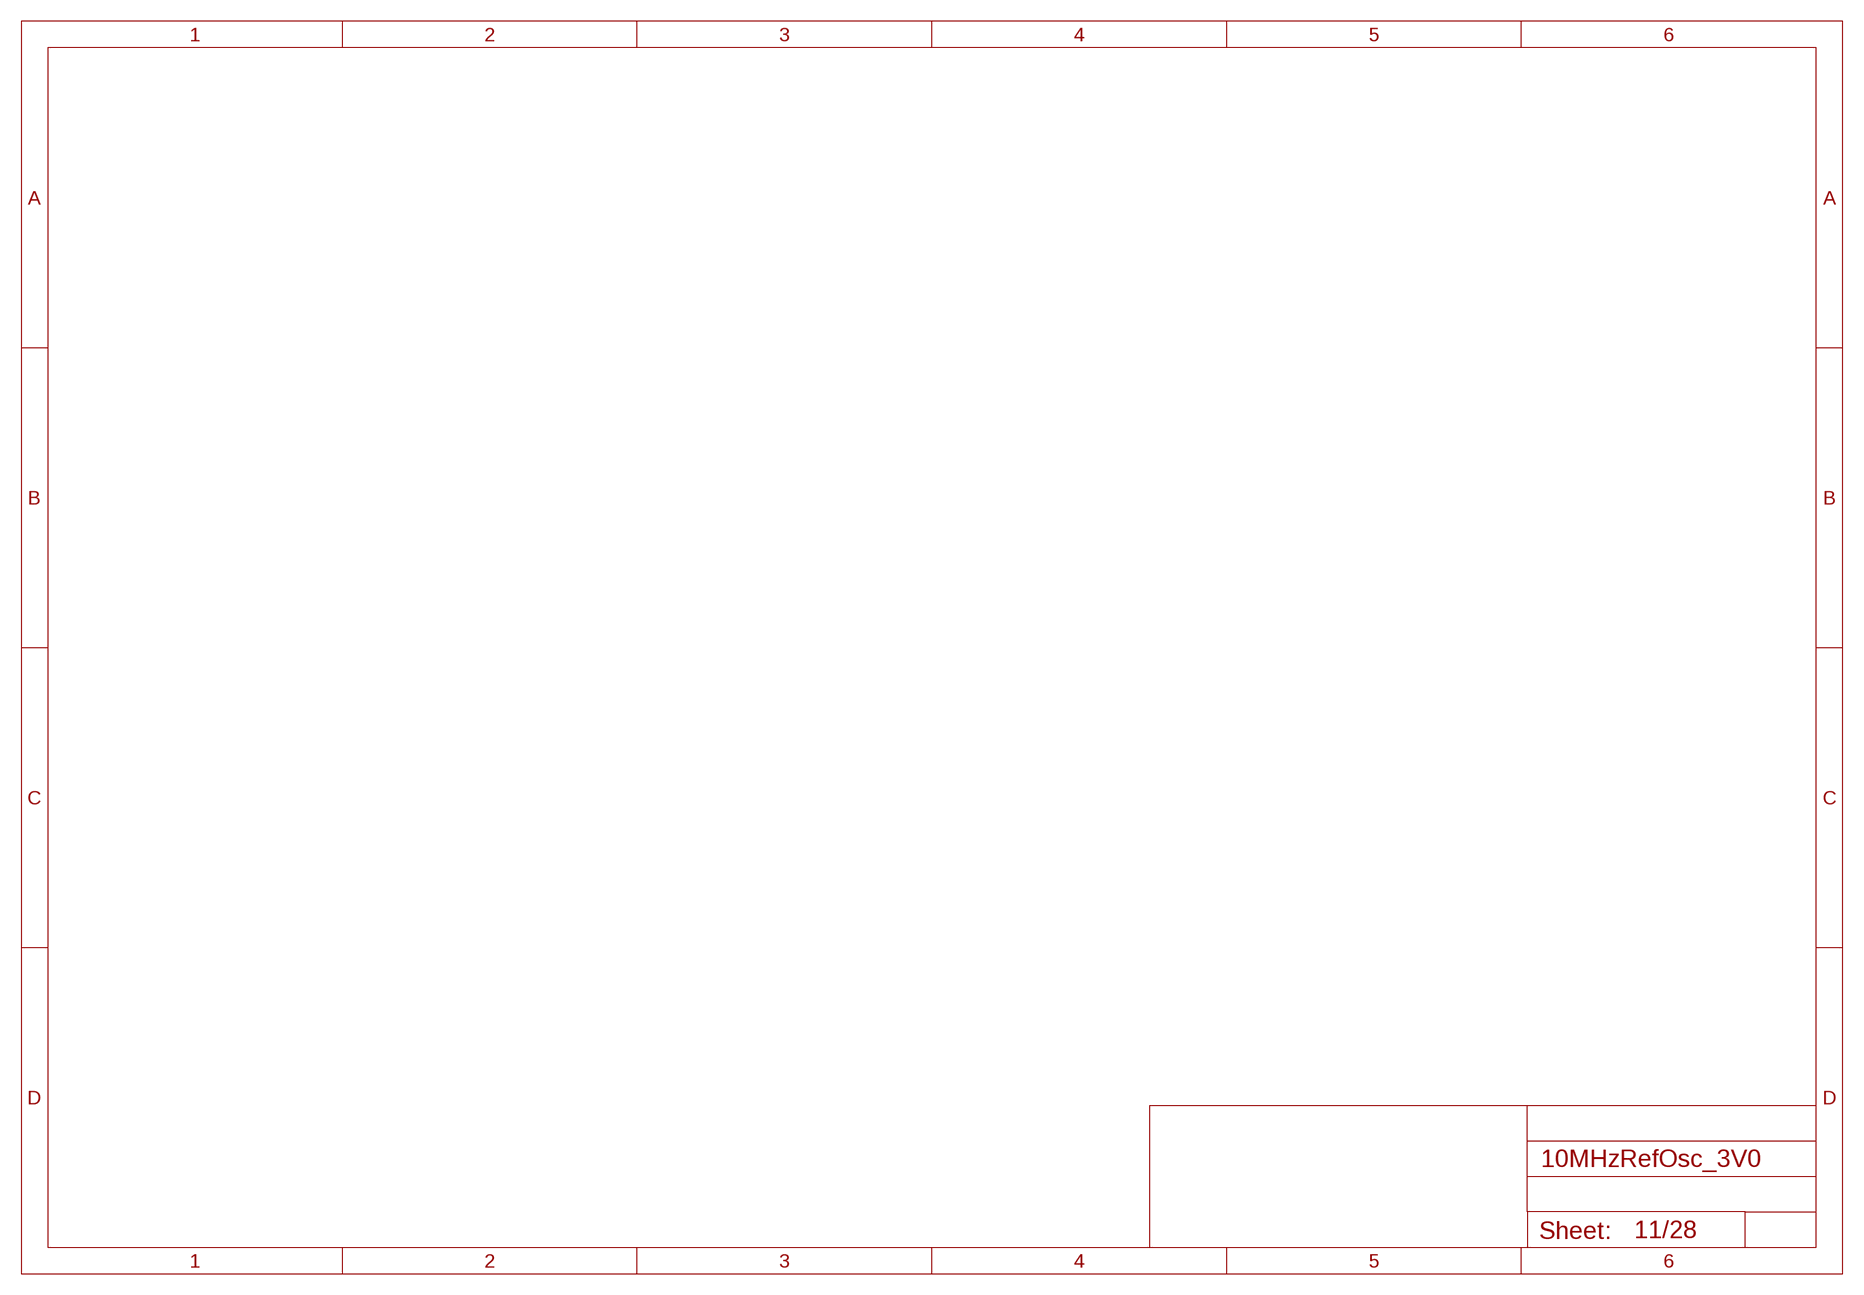
[diagram p10: schematic, sheet 11]

## Sheet 12 of 28: SDRAM
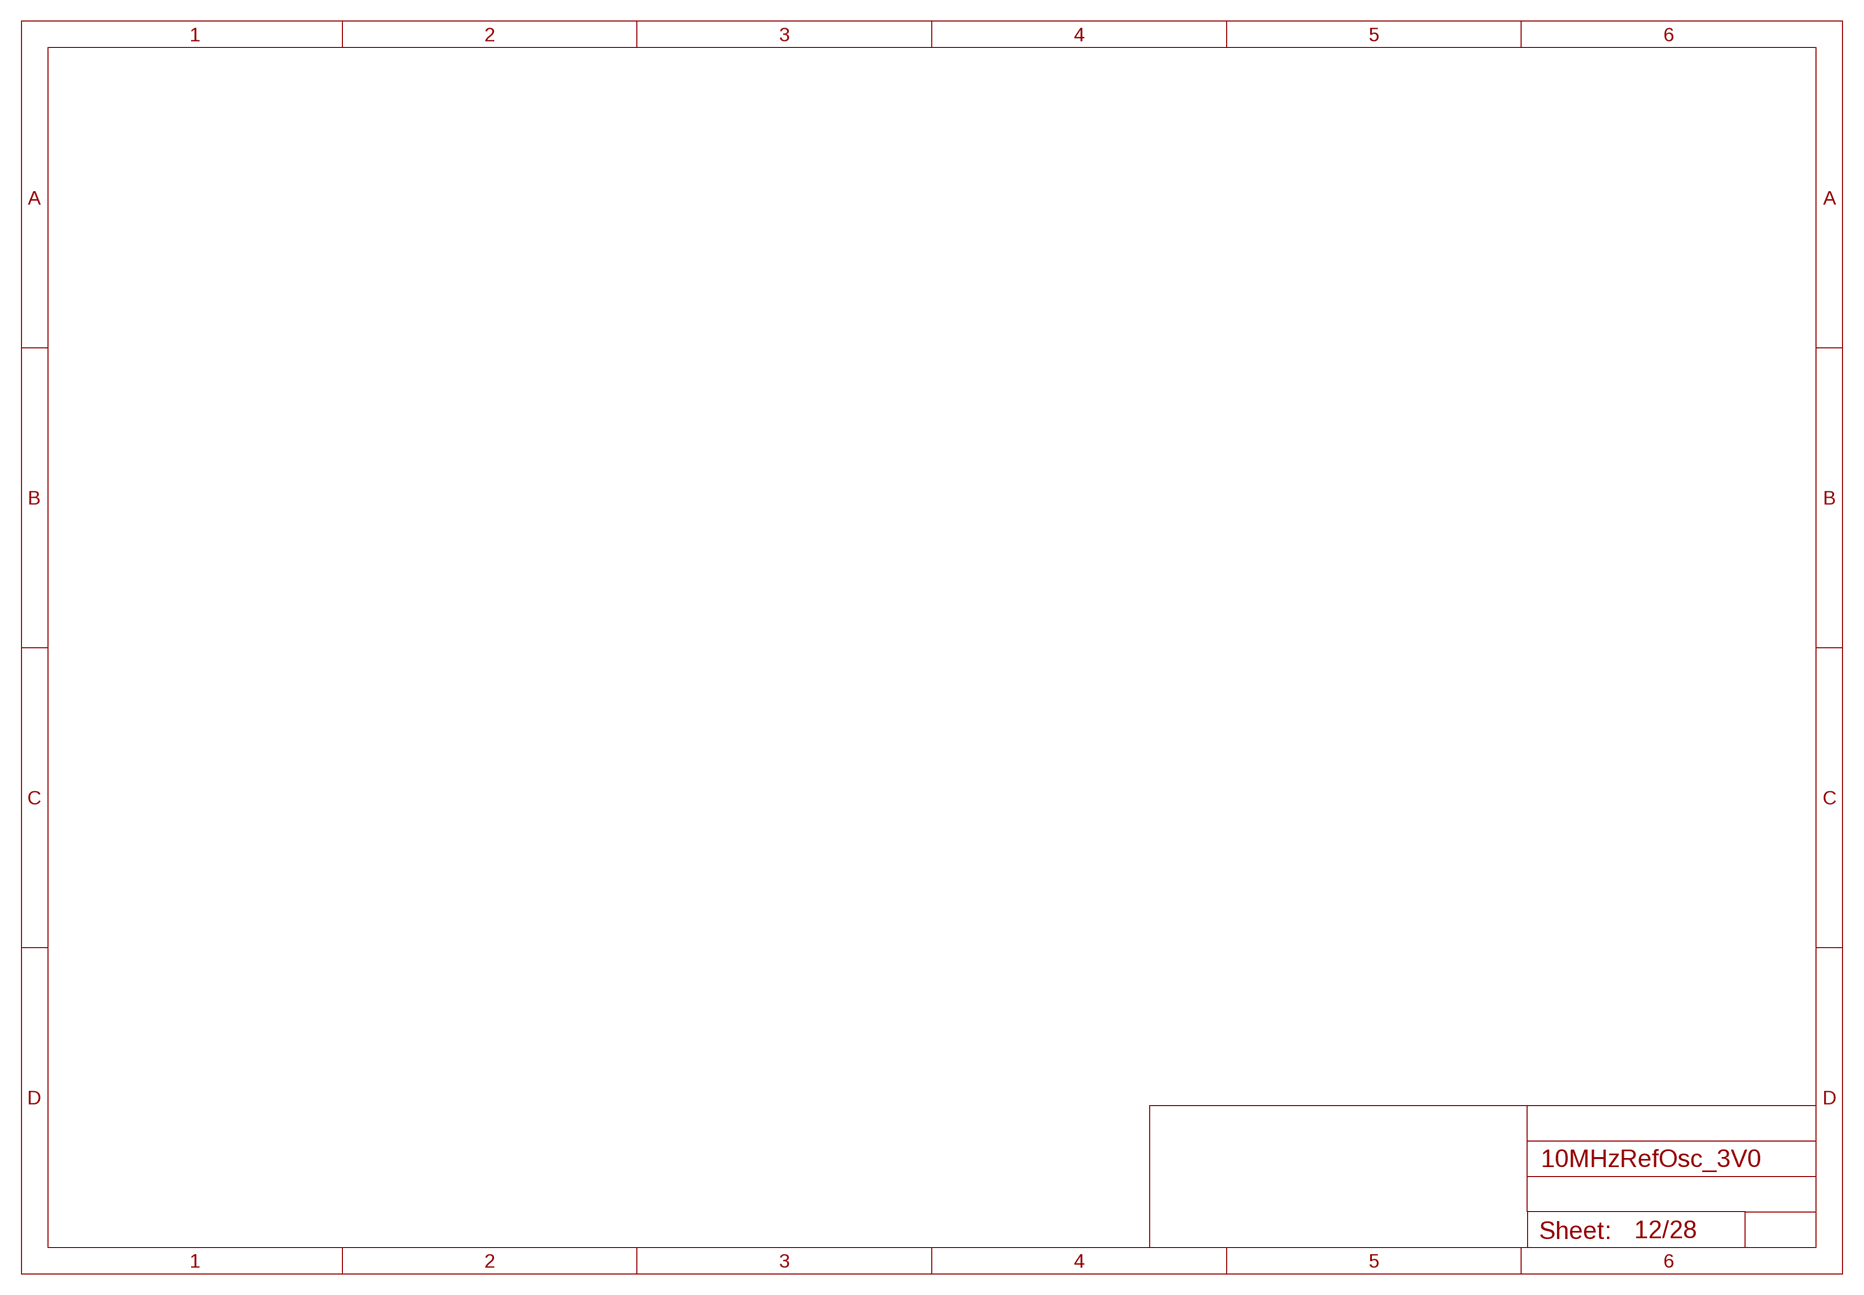
[diagram p11: schematic, sheet 12]

## Sheet 13 of 28: Ethernet
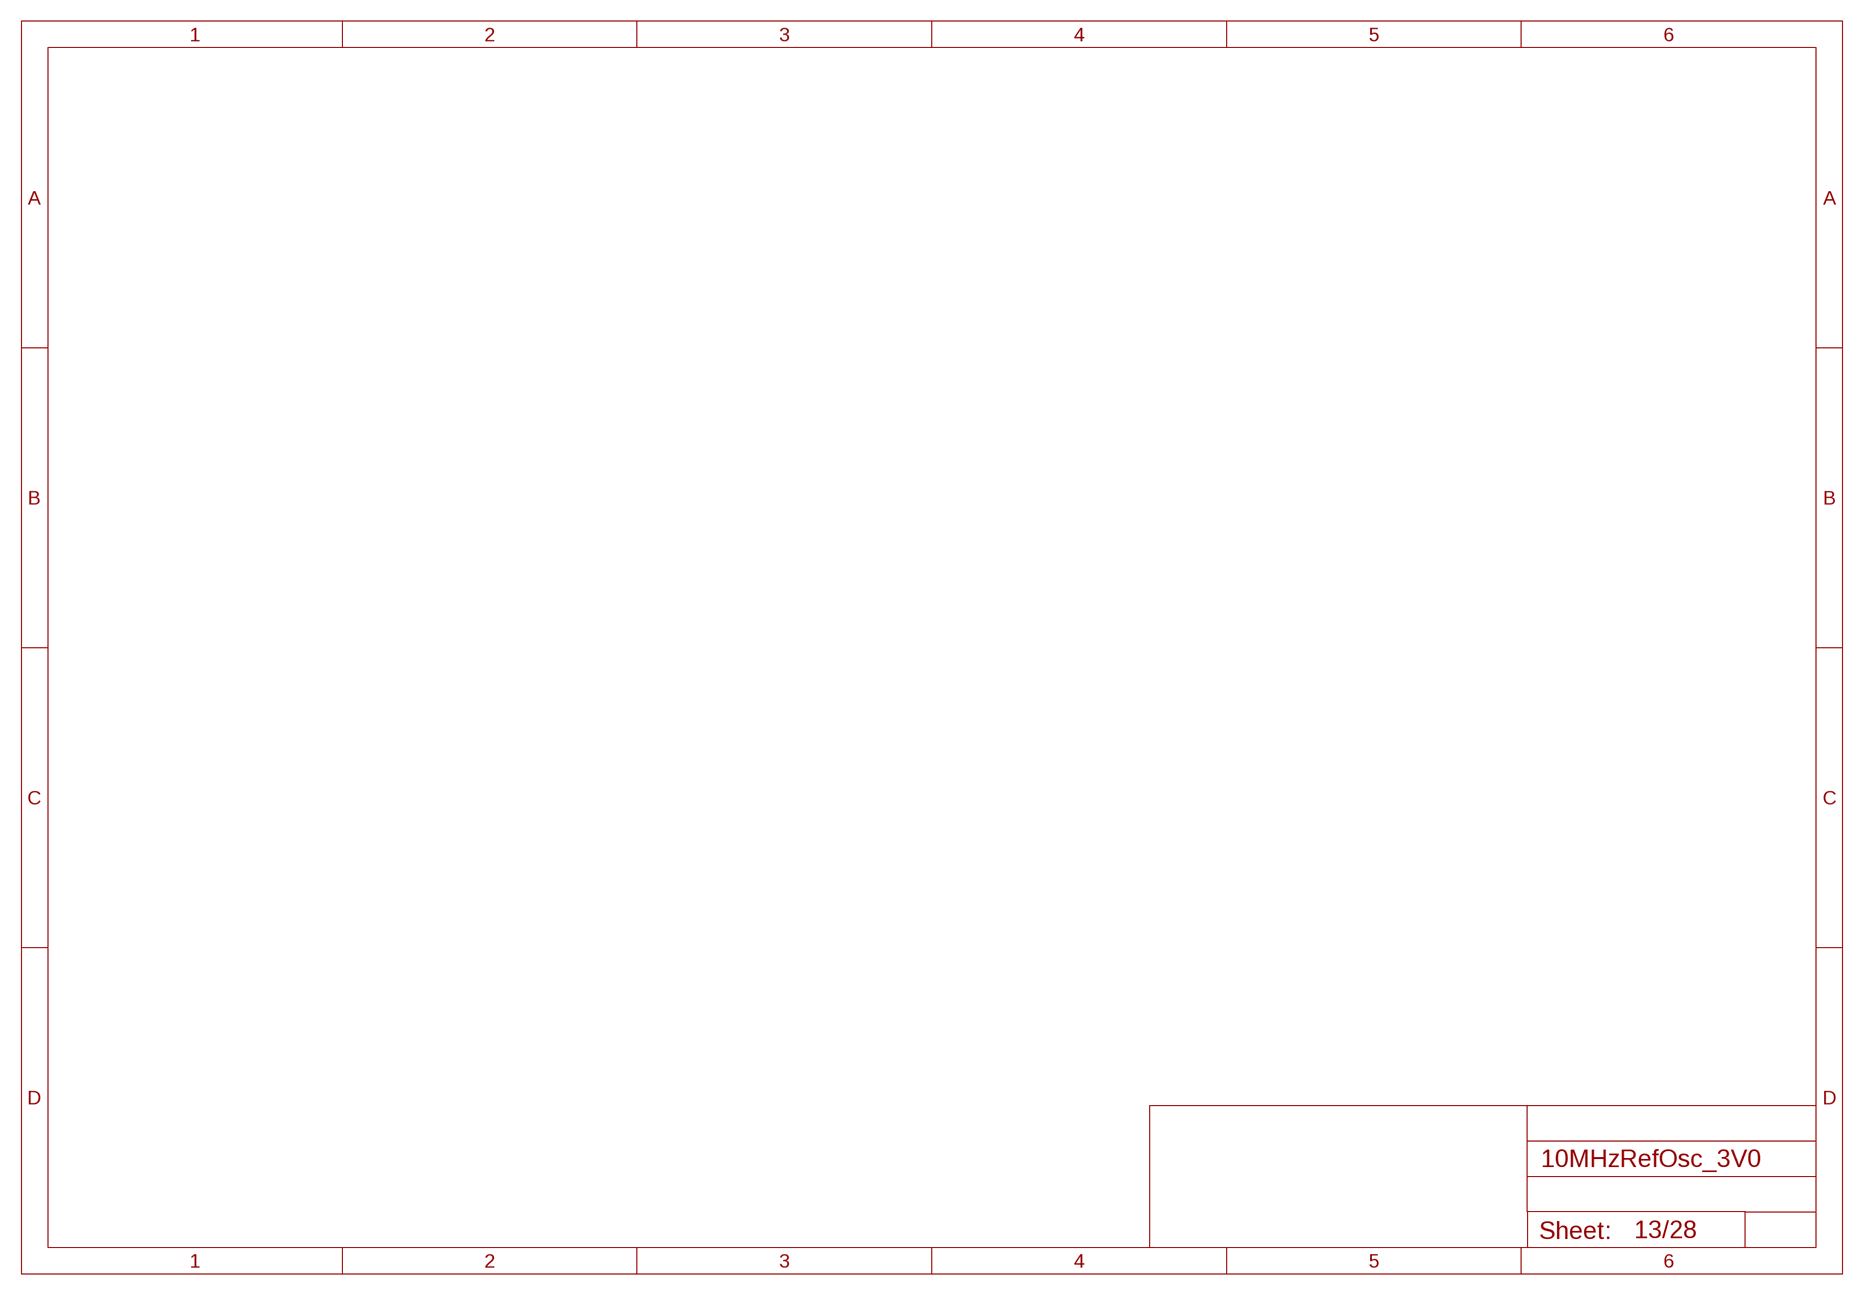
[diagram p12: schematic, sheet 13]

## Sheet 14 of 28: USB
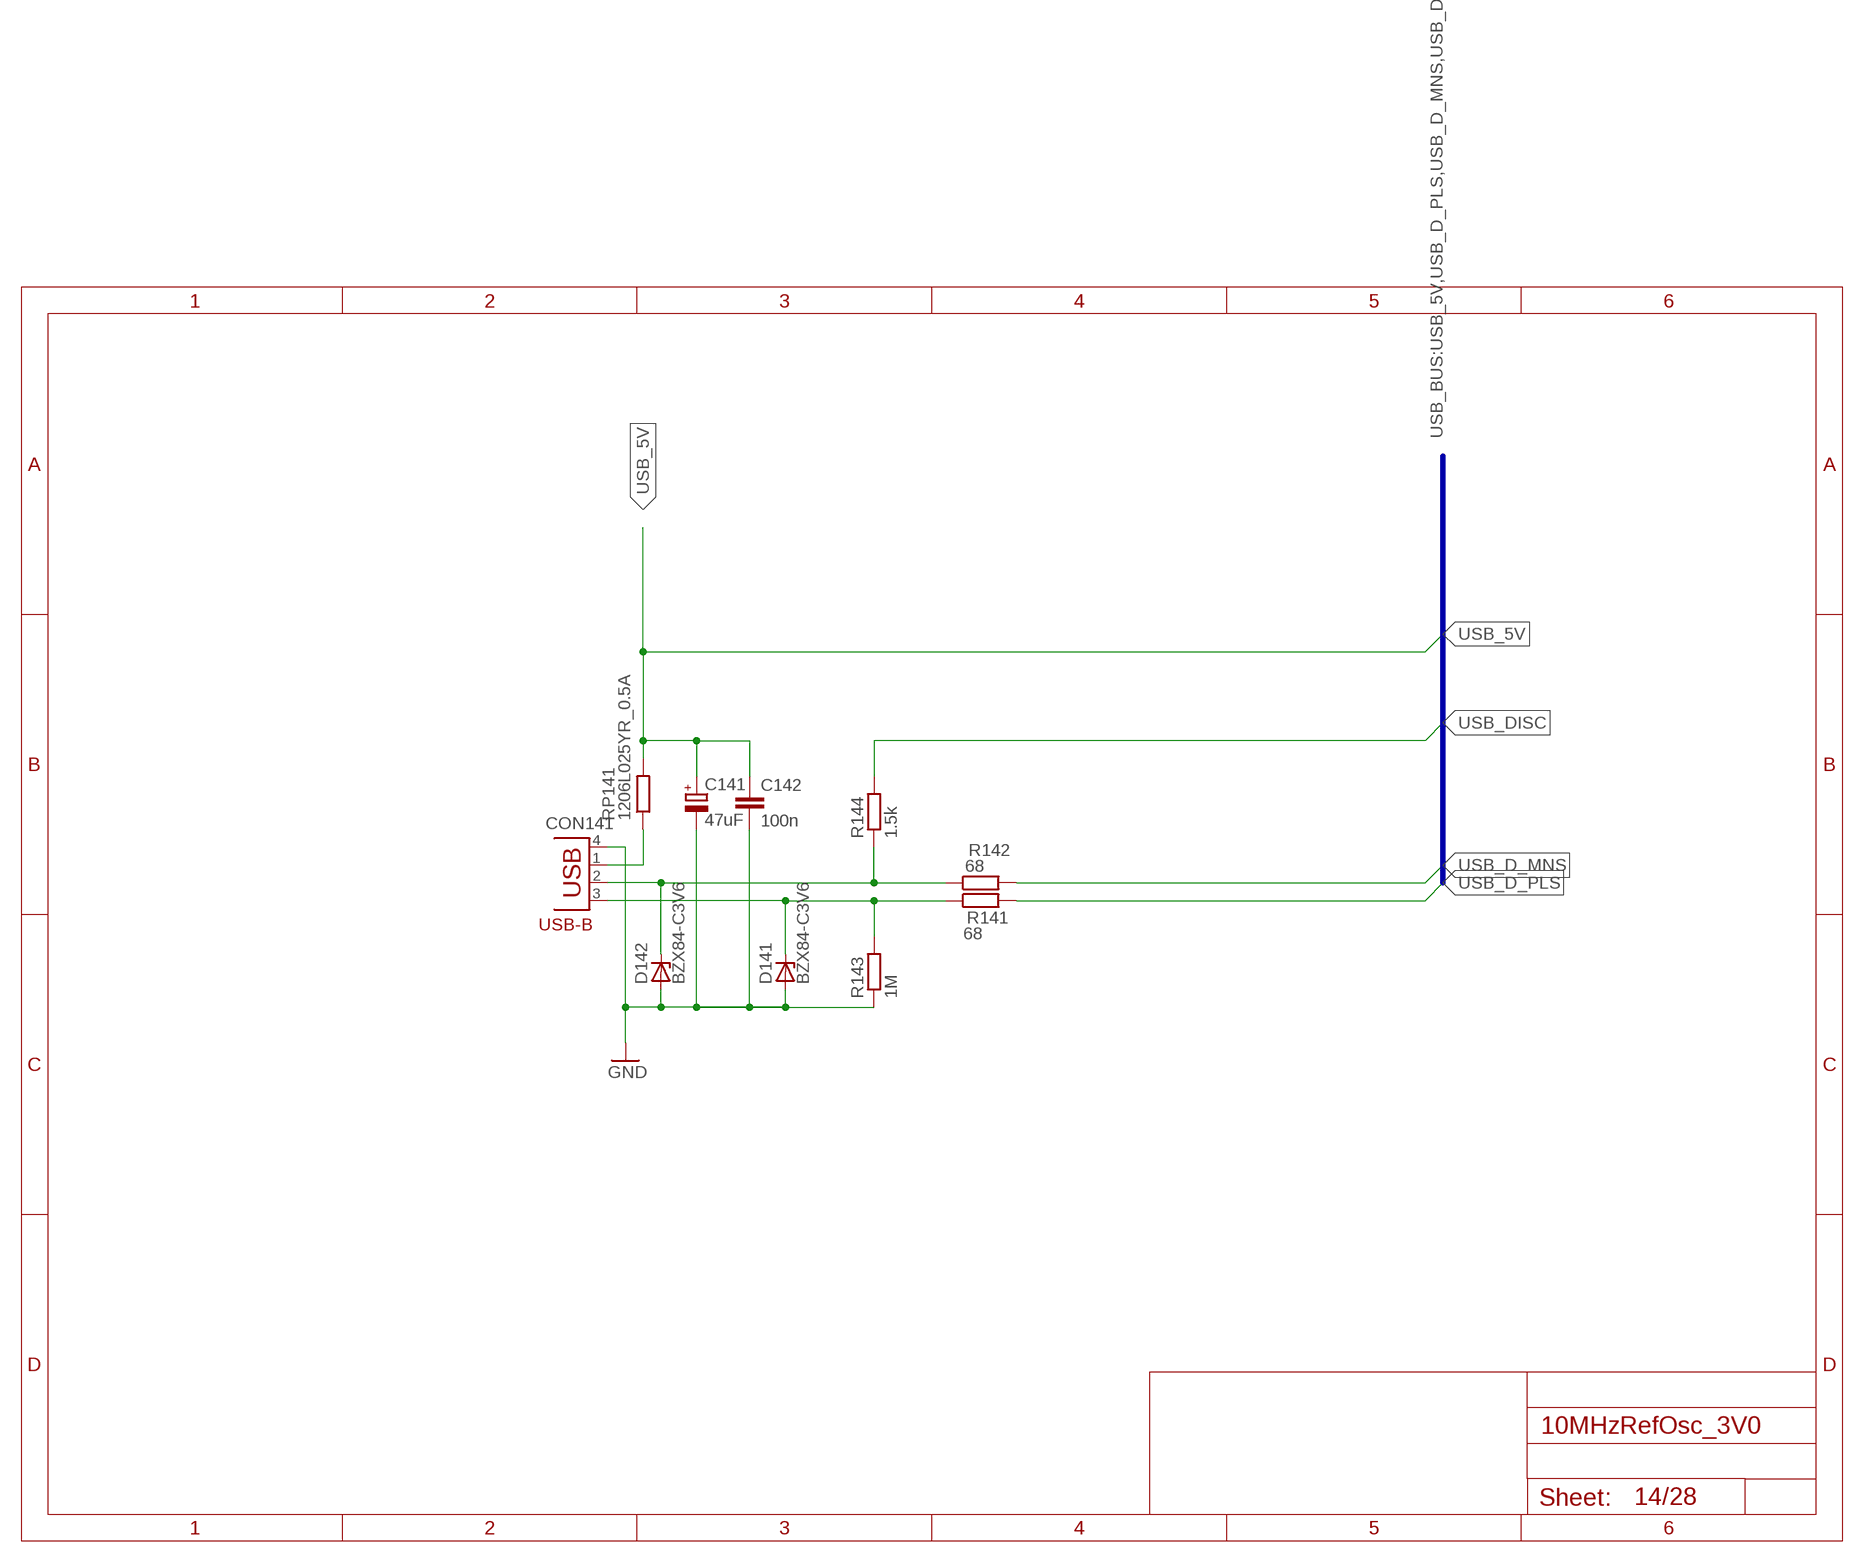
[diagram p13: schematic, sheet 14]

### Parts
C141  47uF  CPOL-EUC  [PANASONIC_C]
C142  100n  C-EUC0805  [C0805]
CON141  TYCO-AMP_USBUSB-B_SMT  [TYCO-AMP_USB-B_SMT]
D141  BZX84-C3V6  BZX84CSMD  [TO236]
D142  BZX84-C3V6  BZX84CSMD  [TO236]
R141  68  R-EU_R0805  [R0805]
R142  68  R-EU_R0805  [R0805]
R143  1M  R-EU_R0805  [R0805]
R144  1.5k  R-EU_R0805  [R0805]
RP141  1206L025YR_0.5A  R-EU_M1206  [M1206]

### Nets
GND: C141.- C142.2 CON141.4(GND) D141.A D142.A R143.1 ; also sheet 1,2,3,4,5,6,7,8,9,10,15,18,19
USB_5V [PWR_HI]: C141.+ C142.1 RP141.2 ; also sheet 1
USB_D_MIN1: CON141.2(D-) D142.C R142.1 R144.1
USB_D_MNS: R142.2
USB_D_PLS: R141.2
USB_D_PLS1: CON141.3(D+) D141.C R141.1 R143.2
USB_DISC: R144.2
USB_PWR1: CON141.1(VBUS) RP141.1

### Buses
USB_BUS:USB_5V,USB_D_PLS,USB_D_MNS,USB_DISC

### Notes on the sheet
- USB-B

## Sheet 15 of 28: GPS
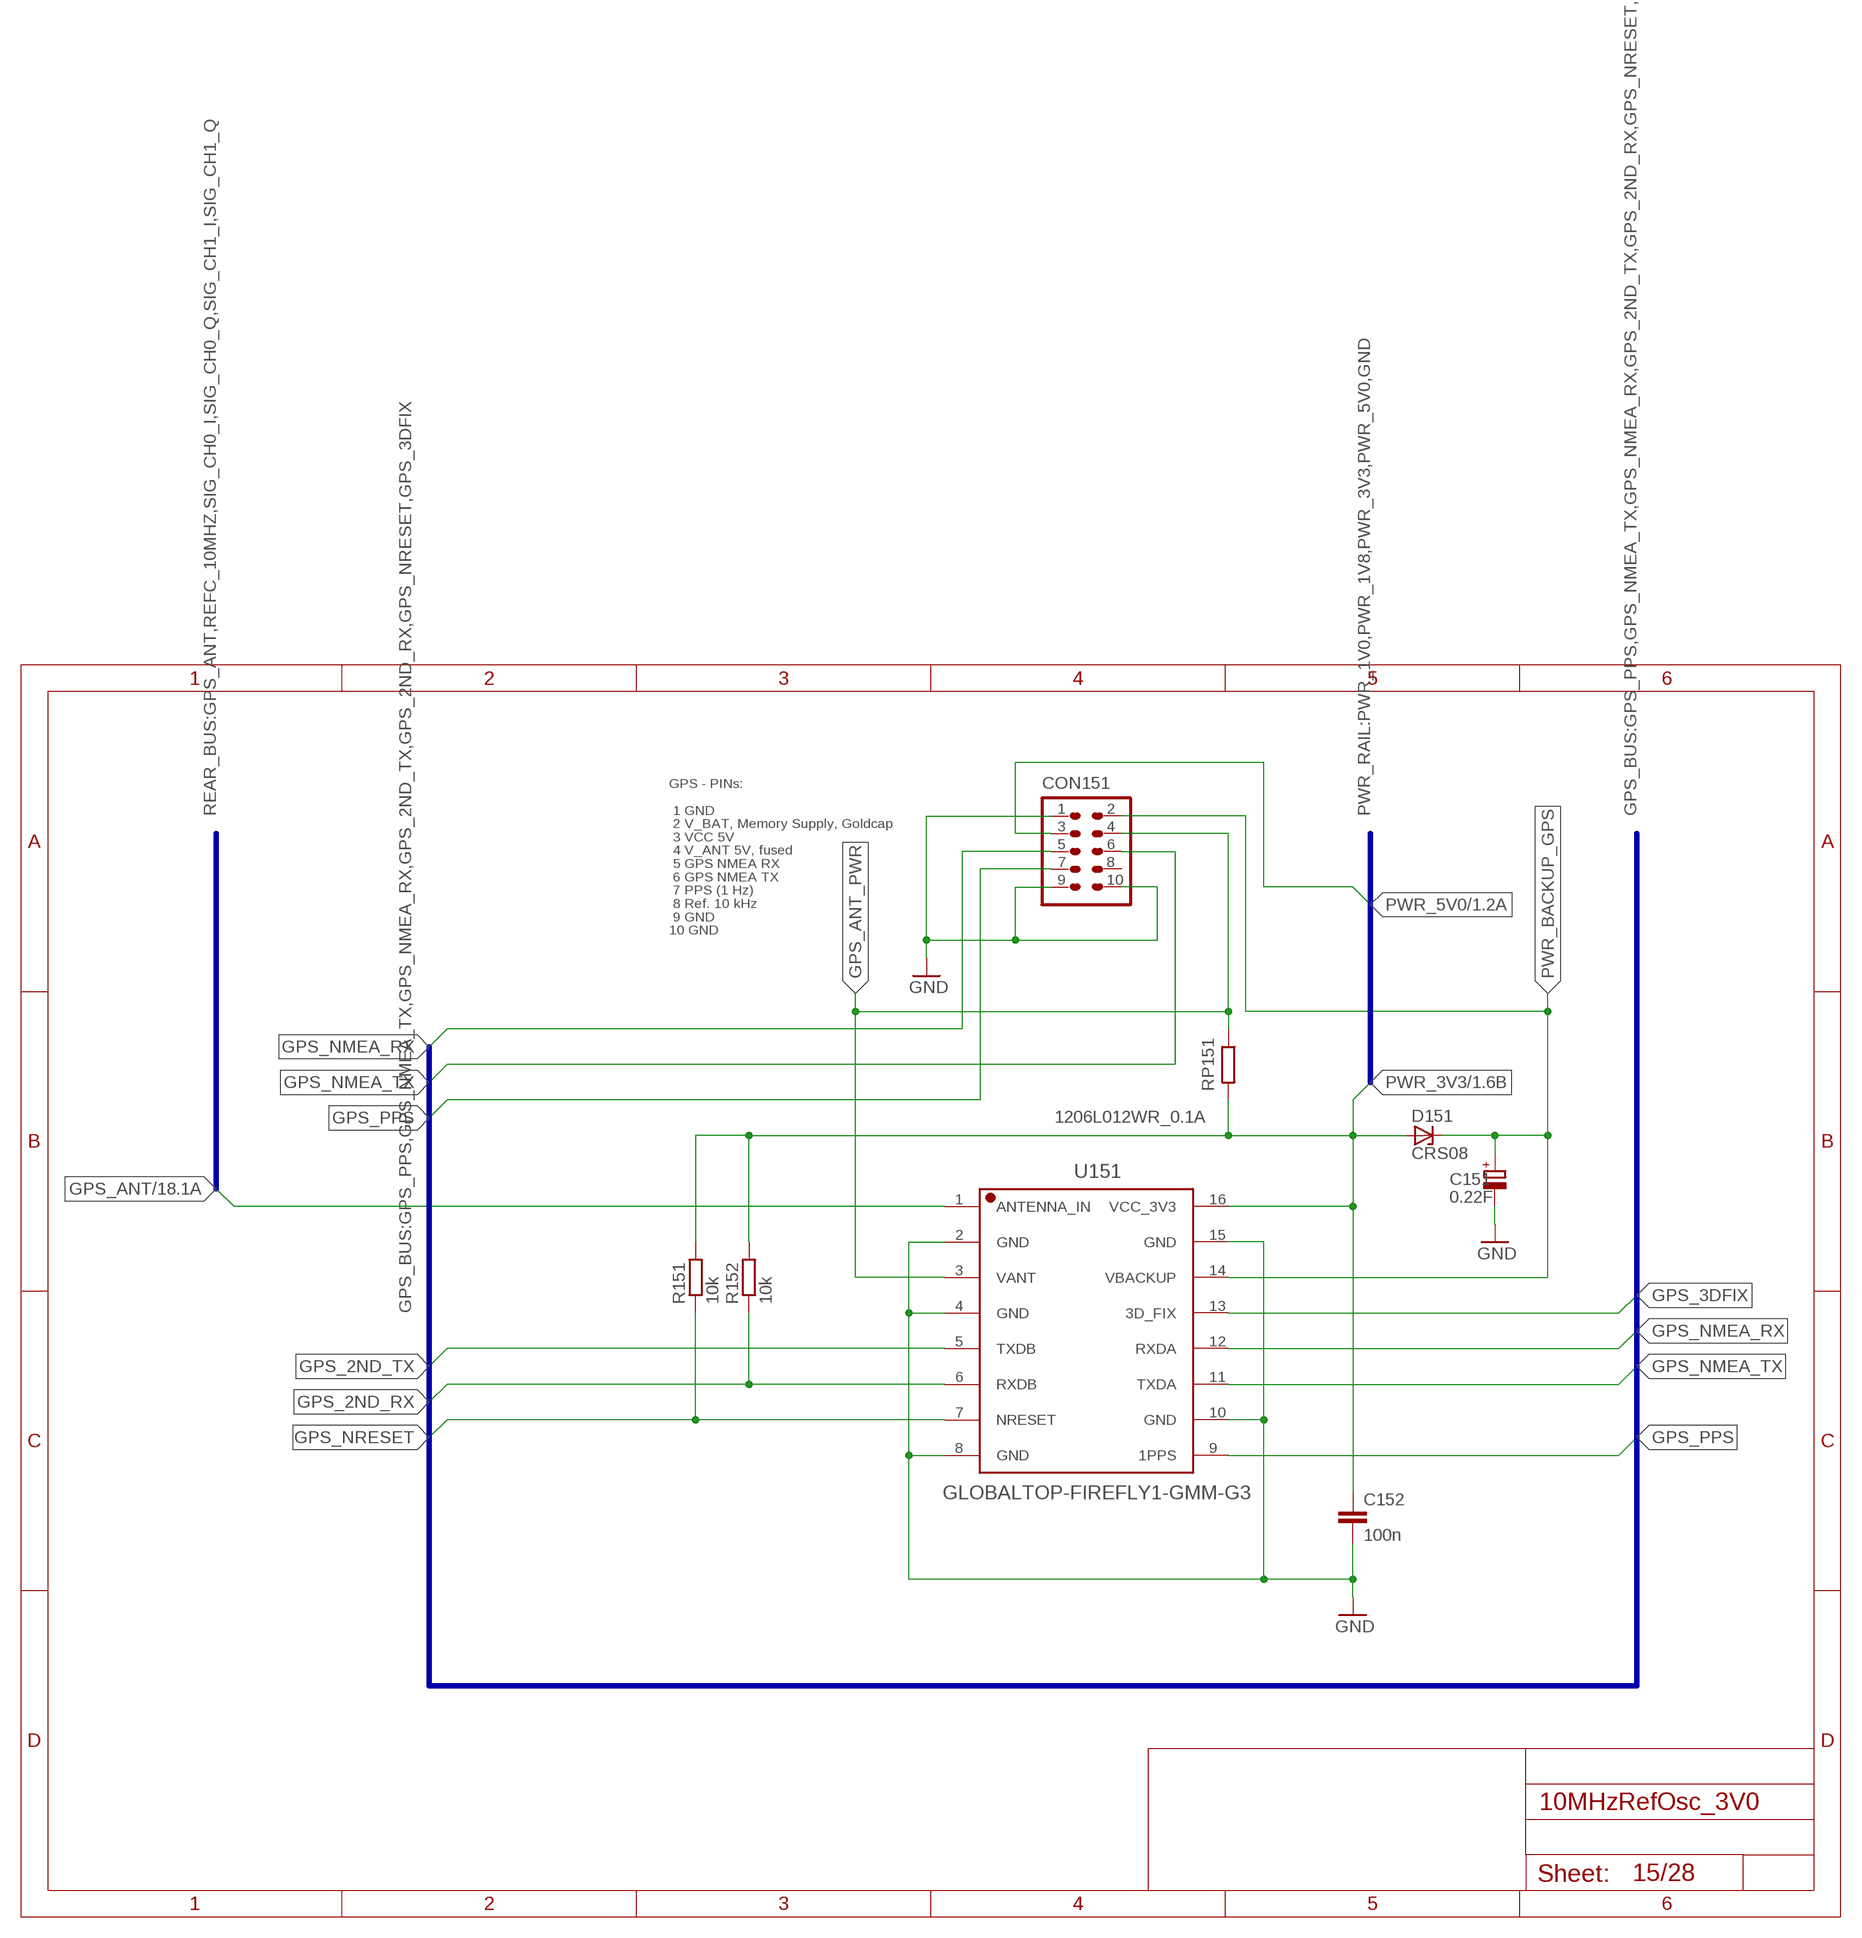
[diagram p14: schematic, sheet 15]

### Parts
C151  0.22F  CPOL-EUC  [PANASONIC_C]
C152  100n  C-EUC0805  [C0805]
CON151  HEADER-2X5SMD  [2X5SMD]
D151  CRS08  ZENER-DIODESOT23  [SOT23]
R151  10k  R-EU_R0805  [R0805]
R152  10k  R-EU_R0805  [R0805]
RP151  1206L012WR_0.1A  R-EU_M1206  [M1206]
U151  GLOBALTOP-FIREFLY1-GMM-G3  [GLOBALTOP-FIREFLY1-GMM-G3]

### Nets
GND: C151.- C152.2 CON151.1 CON151.9 CON151.10 U151.2(GND) U151.4(GND) U151.8(GND) U151.10(GND) U151.15(GND) ; also sheet 1,2,3,4,5,6,7,8,9,10,14,18,19
GPS_2ND_RX: R152.1 U151.6(RXDB)
GPS_2ND_TX: U151.5(TXDB)
GPS_3DFIX: U151.13(3D_FIX)
GPS_ANT: U151.1(ANTENNA_IN) ; also sheet 18
GPS_ANT_PWR [PWR_MED]: CON151.4 RP151.1 U151.3(VANT)
GPS_NMEA_RX: CON151.5 U151.12(RXDA)
GPS_NMEA_TX: CON151.6 U151.11(TXDA)
GPS_NRESET: R151.1 U151.7(NRESET)
GPS_PPS: CON151.7 U151.9(1PPS)
PWR_3V3 [PWR_MED]: C152.1 D151.1(A) R151.2 R152.2 RP151.2 U151.16(VCC_3V3) ; also sheet 1,3,4,5,6,7,8
PWR_5V0: CON151.3 ; also sheet 1
PWR_BACKUP_GPS [PWR_LOW]: C151.+ CON151.2 D151.3(C) U151.14(VBACKUP)
Unconnected: CON151.8

### Buses
REAR_BUS:GPS_ANT,REFC_10MHZ,SIG_CH0_I,SIG_CH0_Q,SIG_CH1_I,SIG_CH1_Q
GPS_BUS:GPS_PPS,GPS_NMEA_TX,GPS_NMEA_RX,GPS_2ND_TX,GPS_2ND_RX,GPS_NRESET,GPS_3DFIX
PWR_RAIL:PWR_1V0,PWR_1V8,PWR_3V3,PWR_5V0,GND

### Notes on the sheet
- GPS - PINs:
  
   1 GND
   2 V_BAT, Memory Supply, Goldcap
   3 VCC 5V
   4 V_ANT 5V, fused
   5 GPS NMEA RX
   6 GPS NMEA TX
   7 PPS (1 Hz)
   8 Ref. 10 kHz
   9 GND
  10 GND

## Sheet 16 of 28: LCD-Module
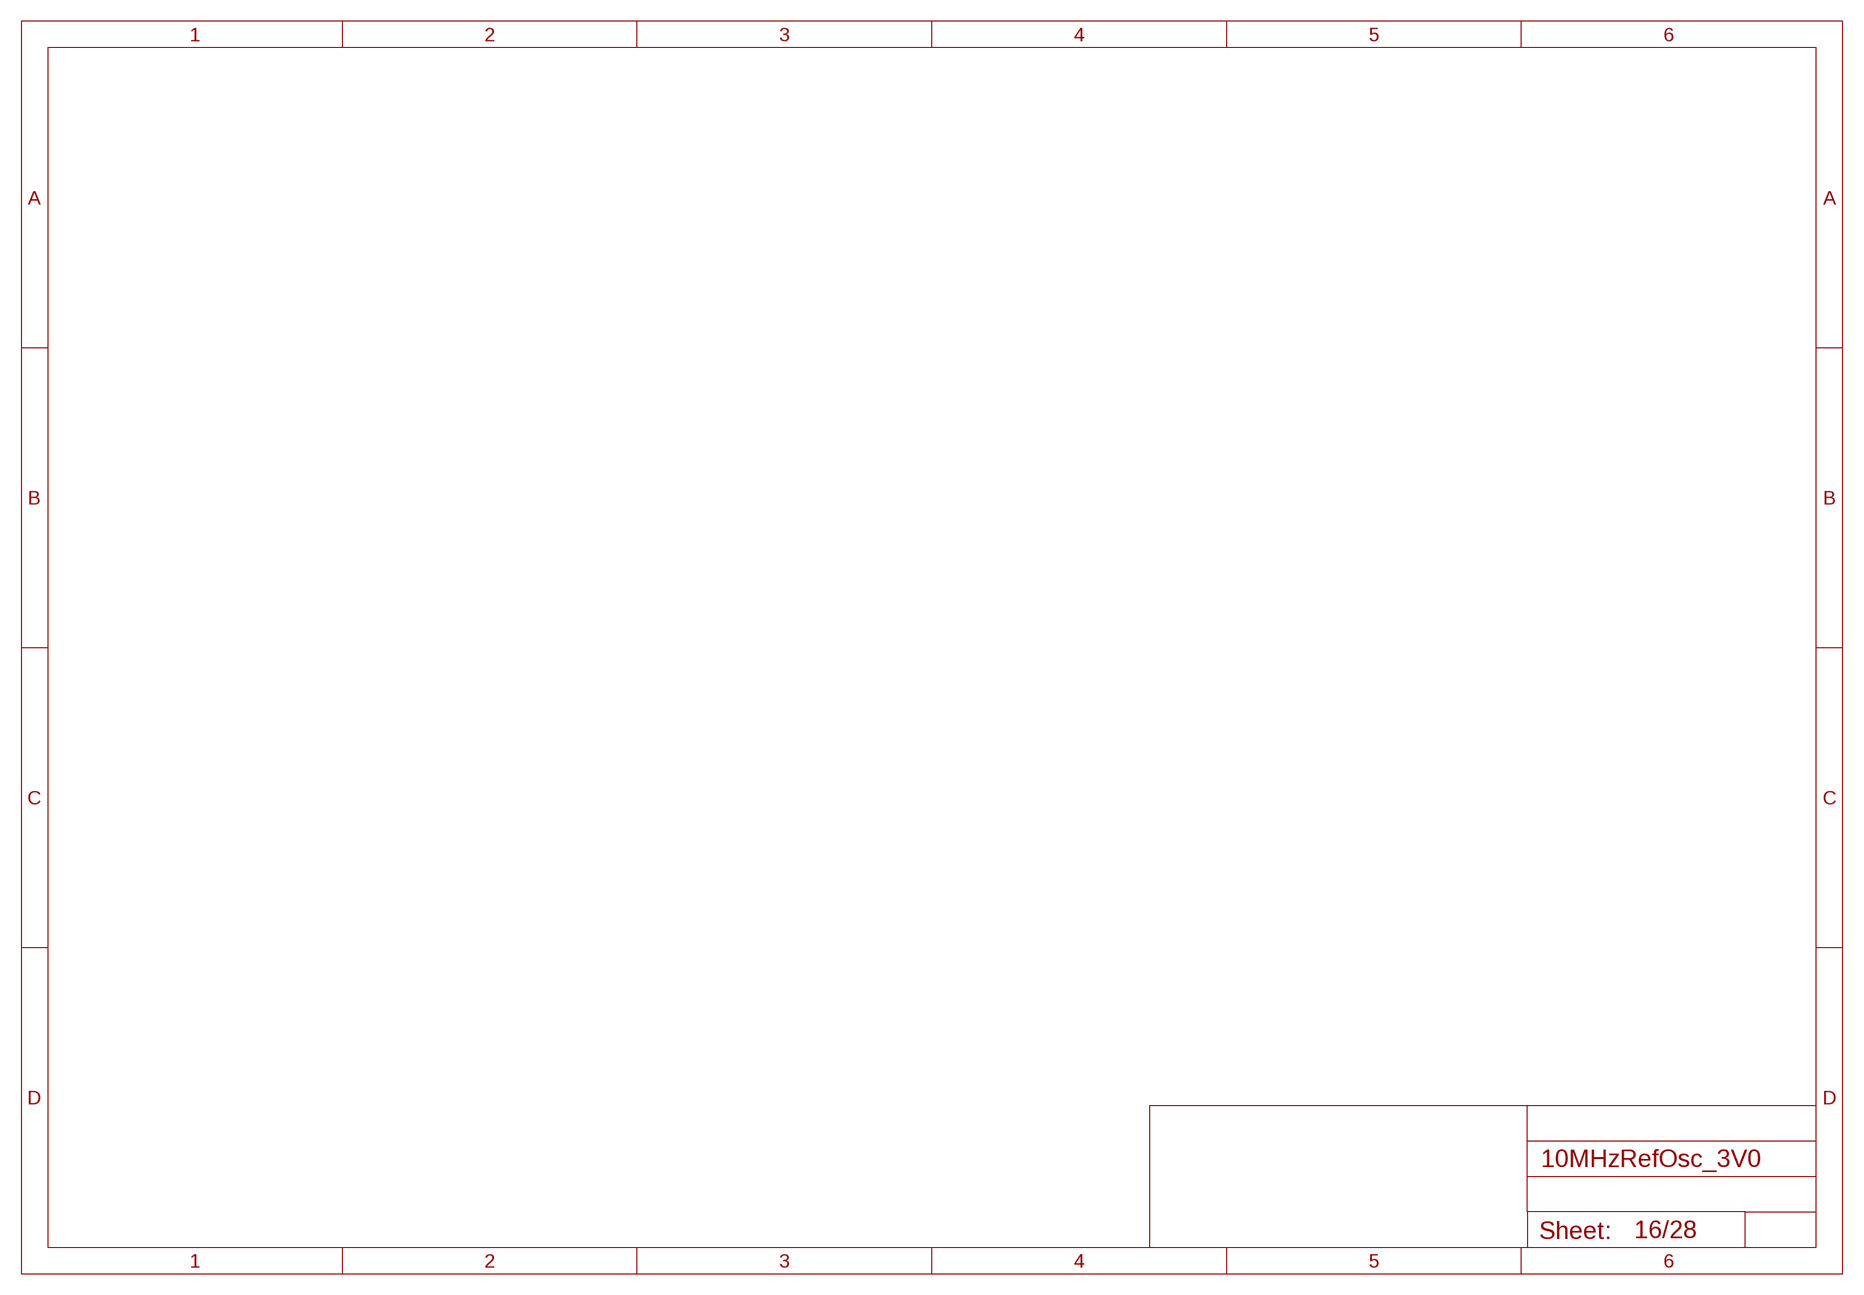
[diagram p15: schematic, sheet 16]

## Sheet 17 of 28: Controls
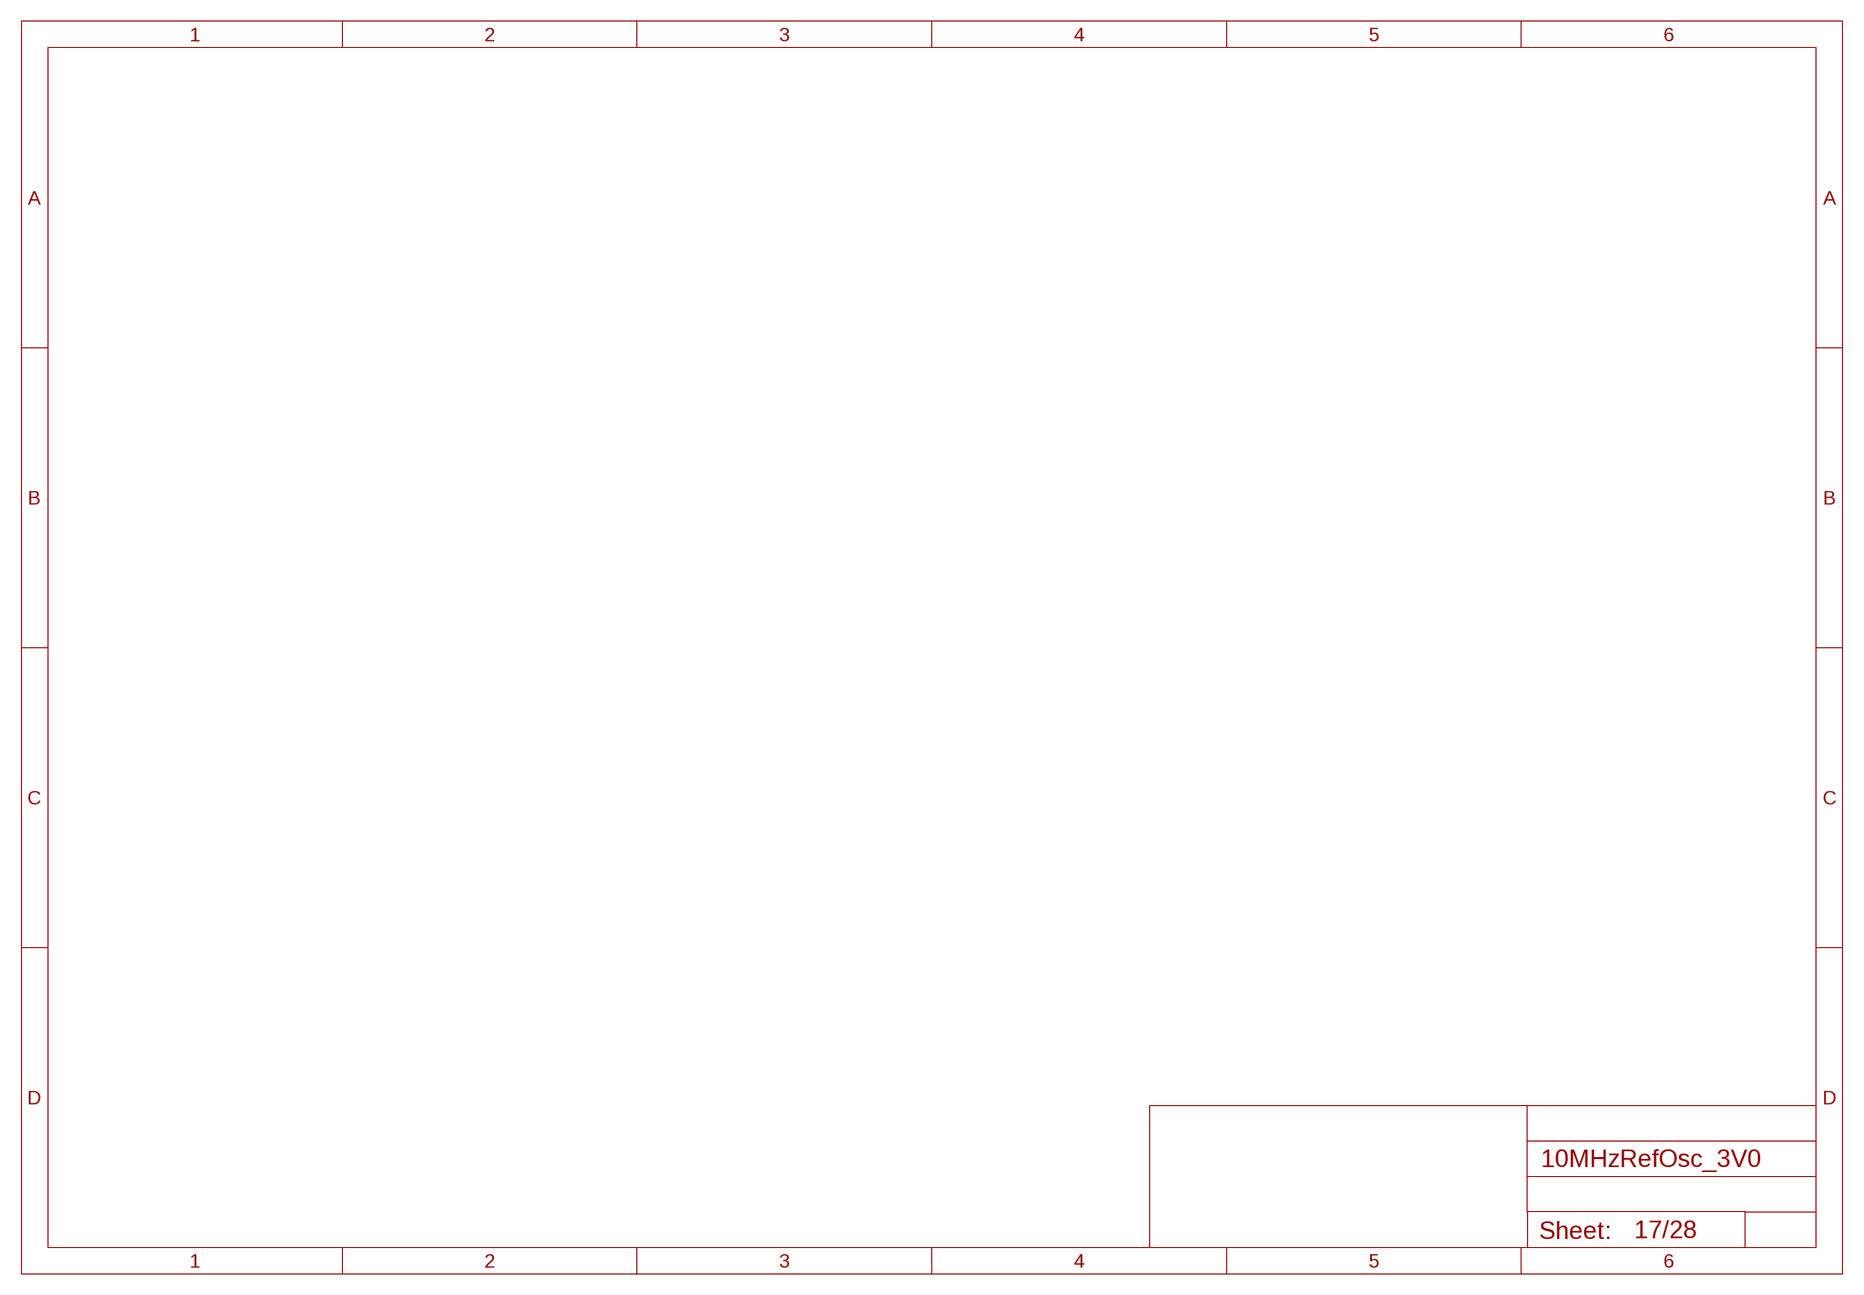
[diagram p16: schematic, sheet 17]

## Sheet 18 of 28: REAR
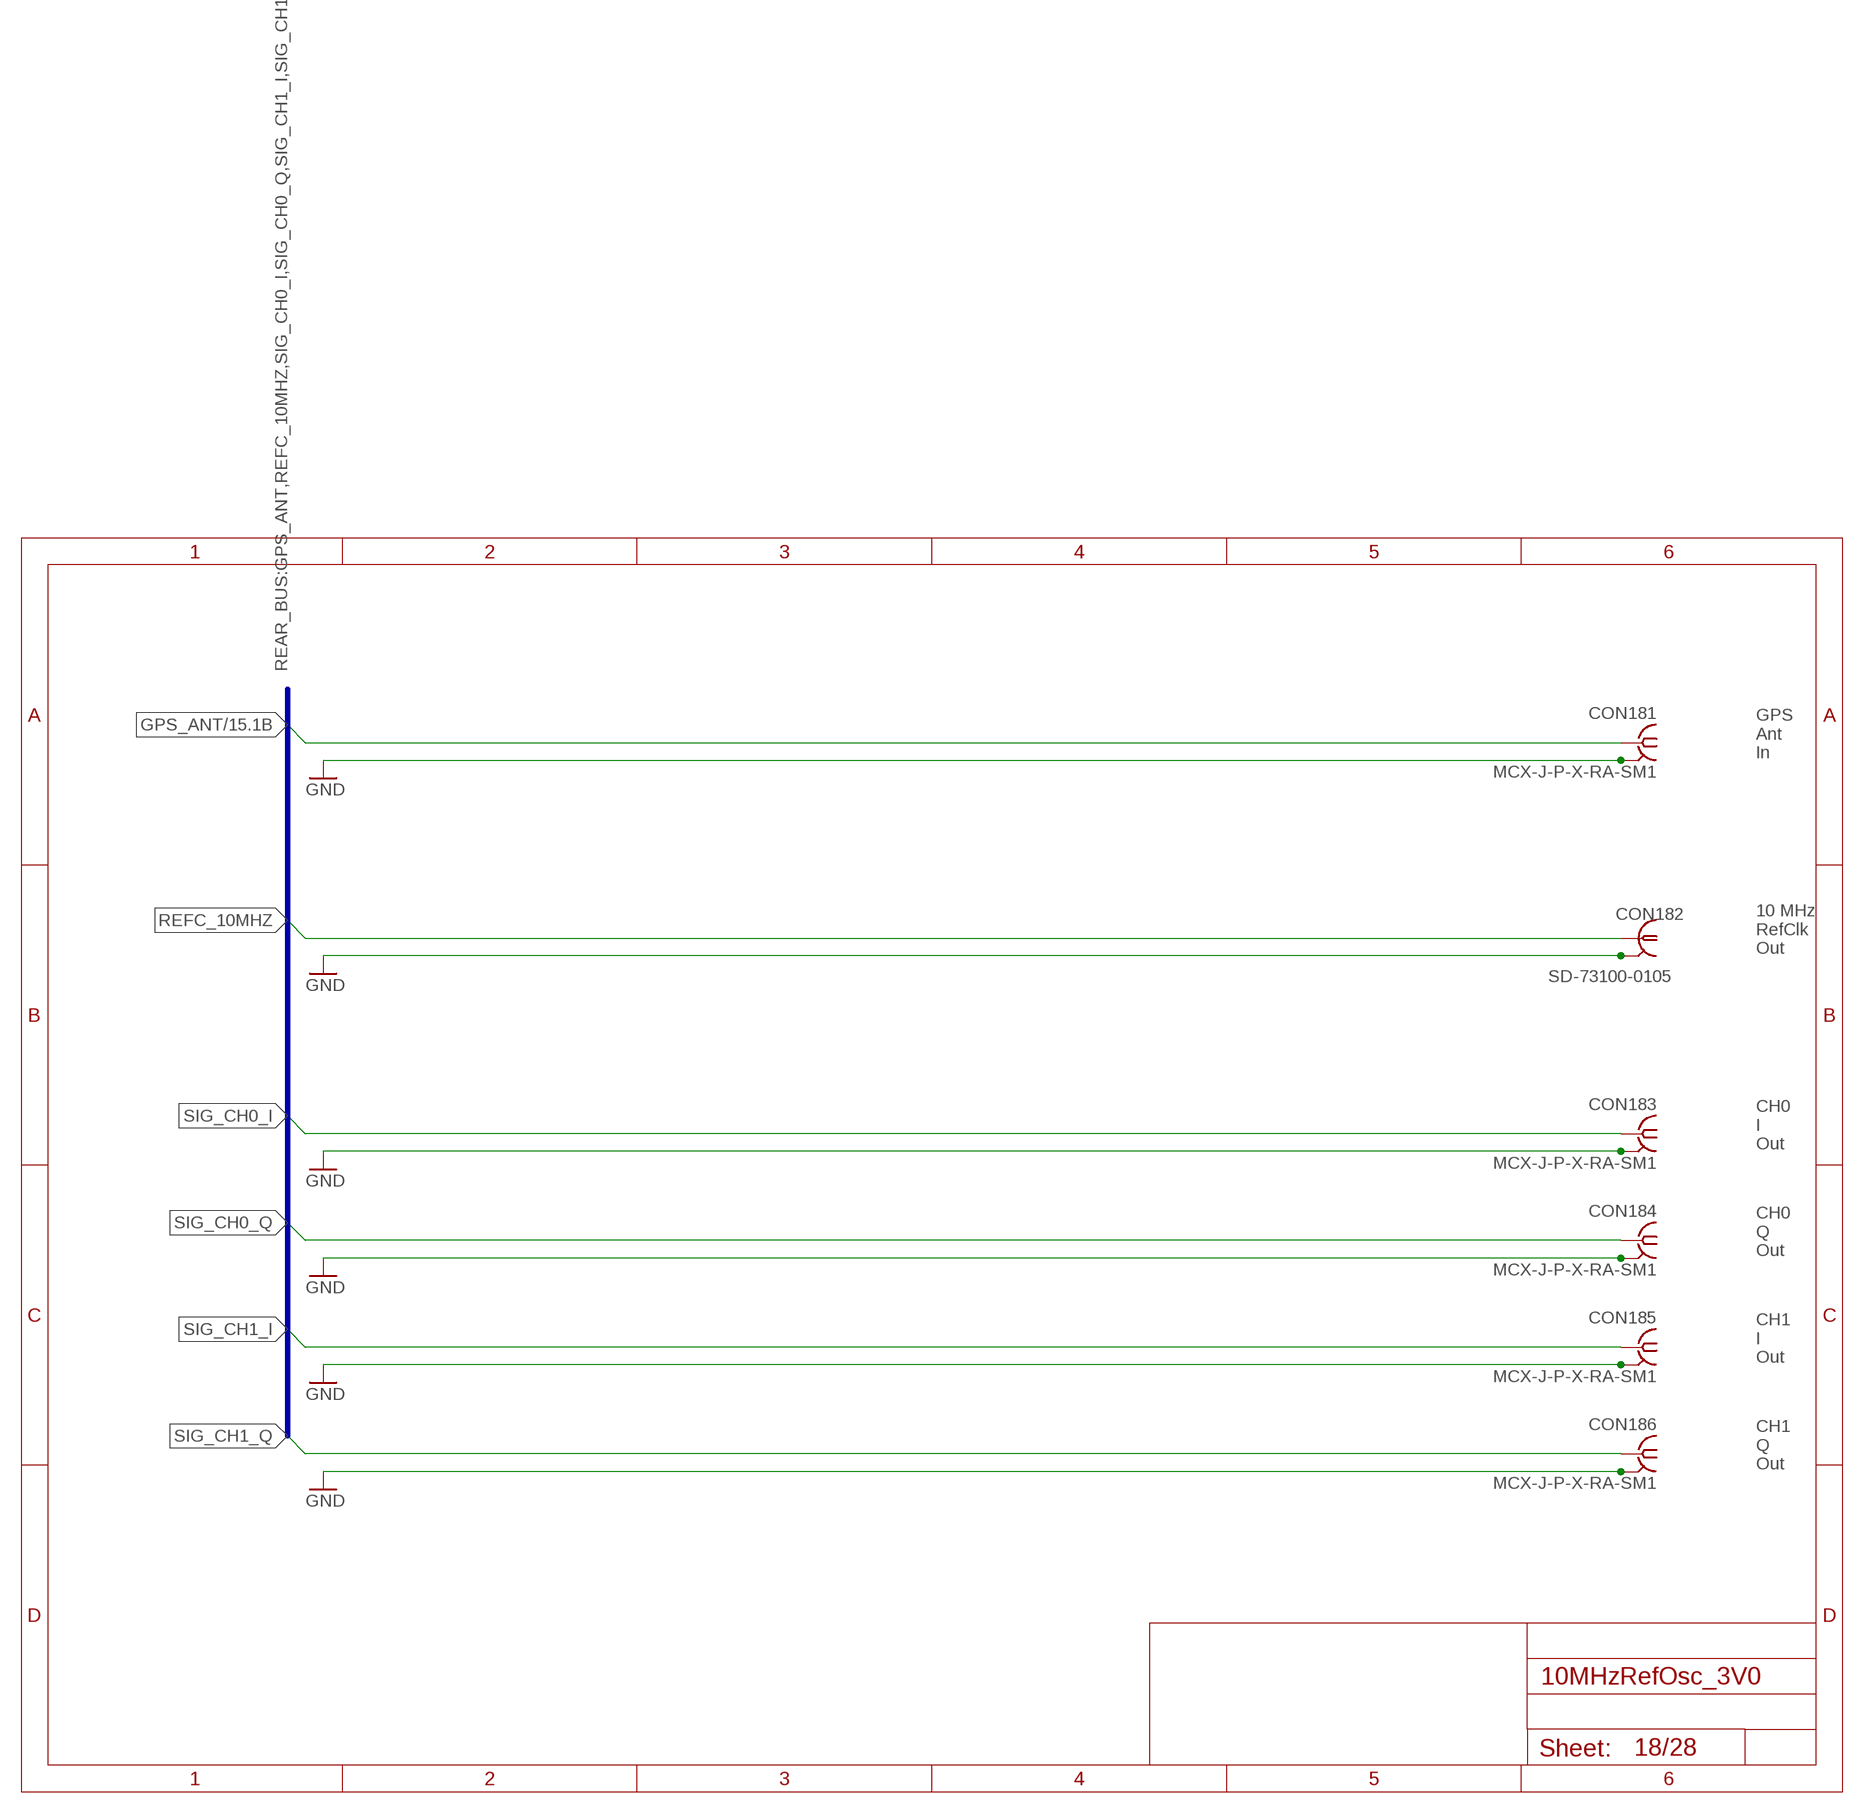
[diagram p17: schematic, sheet 18]

### Parts
CON181  MCX-J-P-X-RA-SM1  [MCX-J-P-X-RA-SM1]
CON182  SD-73100-0105  MOLEX_BNC-JACK-50R_SD-73100-0105  [MOLEX_BNC-JACK-50R_SD-73100-0105]
CON183  MCX-J-P-X-RA-SM1  [MCX-J-P-X-RA-SM1]
CON184  MCX-J-P-X-RA-SM1  [MCX-J-P-X-RA-SM1]
CON185  MCX-J-P-X-RA-SM1  [MCX-J-P-X-RA-SM1]
CON186  MCX-J-P-X-RA-SM1  [MCX-J-P-X-RA-SM1]

### Nets
GND: CON181.2 CON181.3 CON181.4 CON181.5 CON182.2 CON182.3 CON183.2 CON183.3 CON183.4 CON183.5 CON184.2 CON184.3 CON184.4 CON184.5 CON185.2 CON185.3 CON185.4 CON185.5 CON186.2 CON186.3 CON186.4 CON186.5 ; also sheet 1,2,3,4,5,6,7,8,9,10,14,15,19
GPS_ANT: CON181.1 ; also sheet 15
REFC_10MHZ: CON182.1
SIG_CH0_I: CON183.1
SIG_CH0_Q: CON184.1
SIG_CH1_I: CON185.1
SIG_CH1_Q: CON186.1

### Buses
REAR_BUS:GPS_ANT,REFC_10MHZ,SIG_CH0_I,SIG_CH0_Q,SIG_CH1_I,SIG_CH1_Q

### Notes on the sheet
- GPS
  Ant
  In
- 10 MHz
  RefClk
  Out
- CH0
  I
  Out
- CH0
  Q
  Out
- CH1
  I
  Out
- CH1
  Q
  Out

## Sheet 19 of 28: Holes
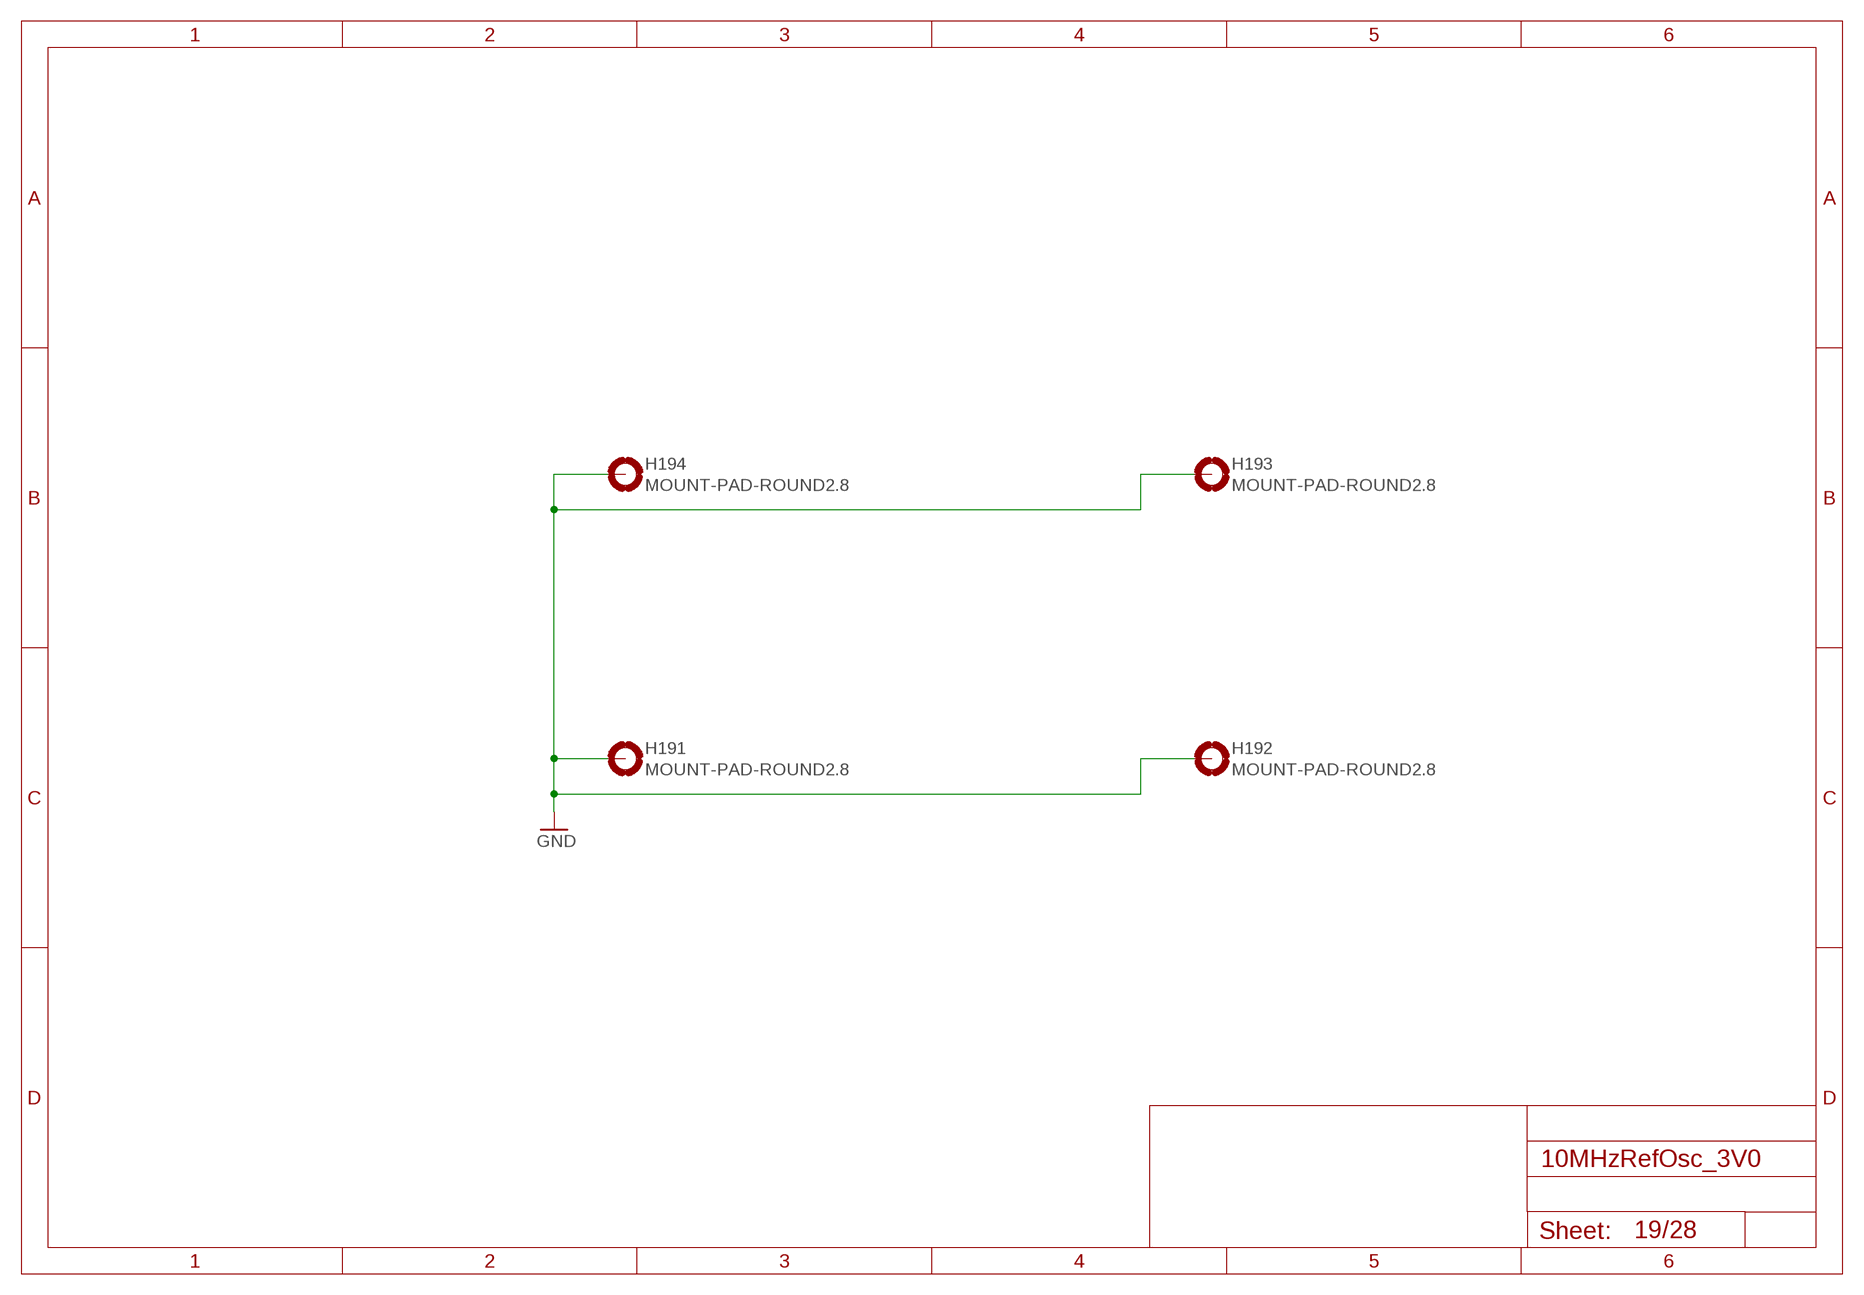
[diagram p18: schematic, sheet 19]

### Parts
H191  MOUNT-PAD-ROUND2.8  [2,8-PAD]
H192  MOUNT-PAD-ROUND2.8  [2,8-PAD]
H193  MOUNT-PAD-ROUND2.8  [2,8-PAD]
H194  MOUNT-PAD-ROUND2.8  [2,8-PAD]

### Nets
GND: H191.B2,8(MOUNT) H192.B2,8(MOUNT) H193.B2,8(MOUNT) H194.B2,8(MOUNT) ; also sheet 1,2,3,4,5,6,7,8,9,10,14,15,18

## Sheet 20 of 28: Socket_0
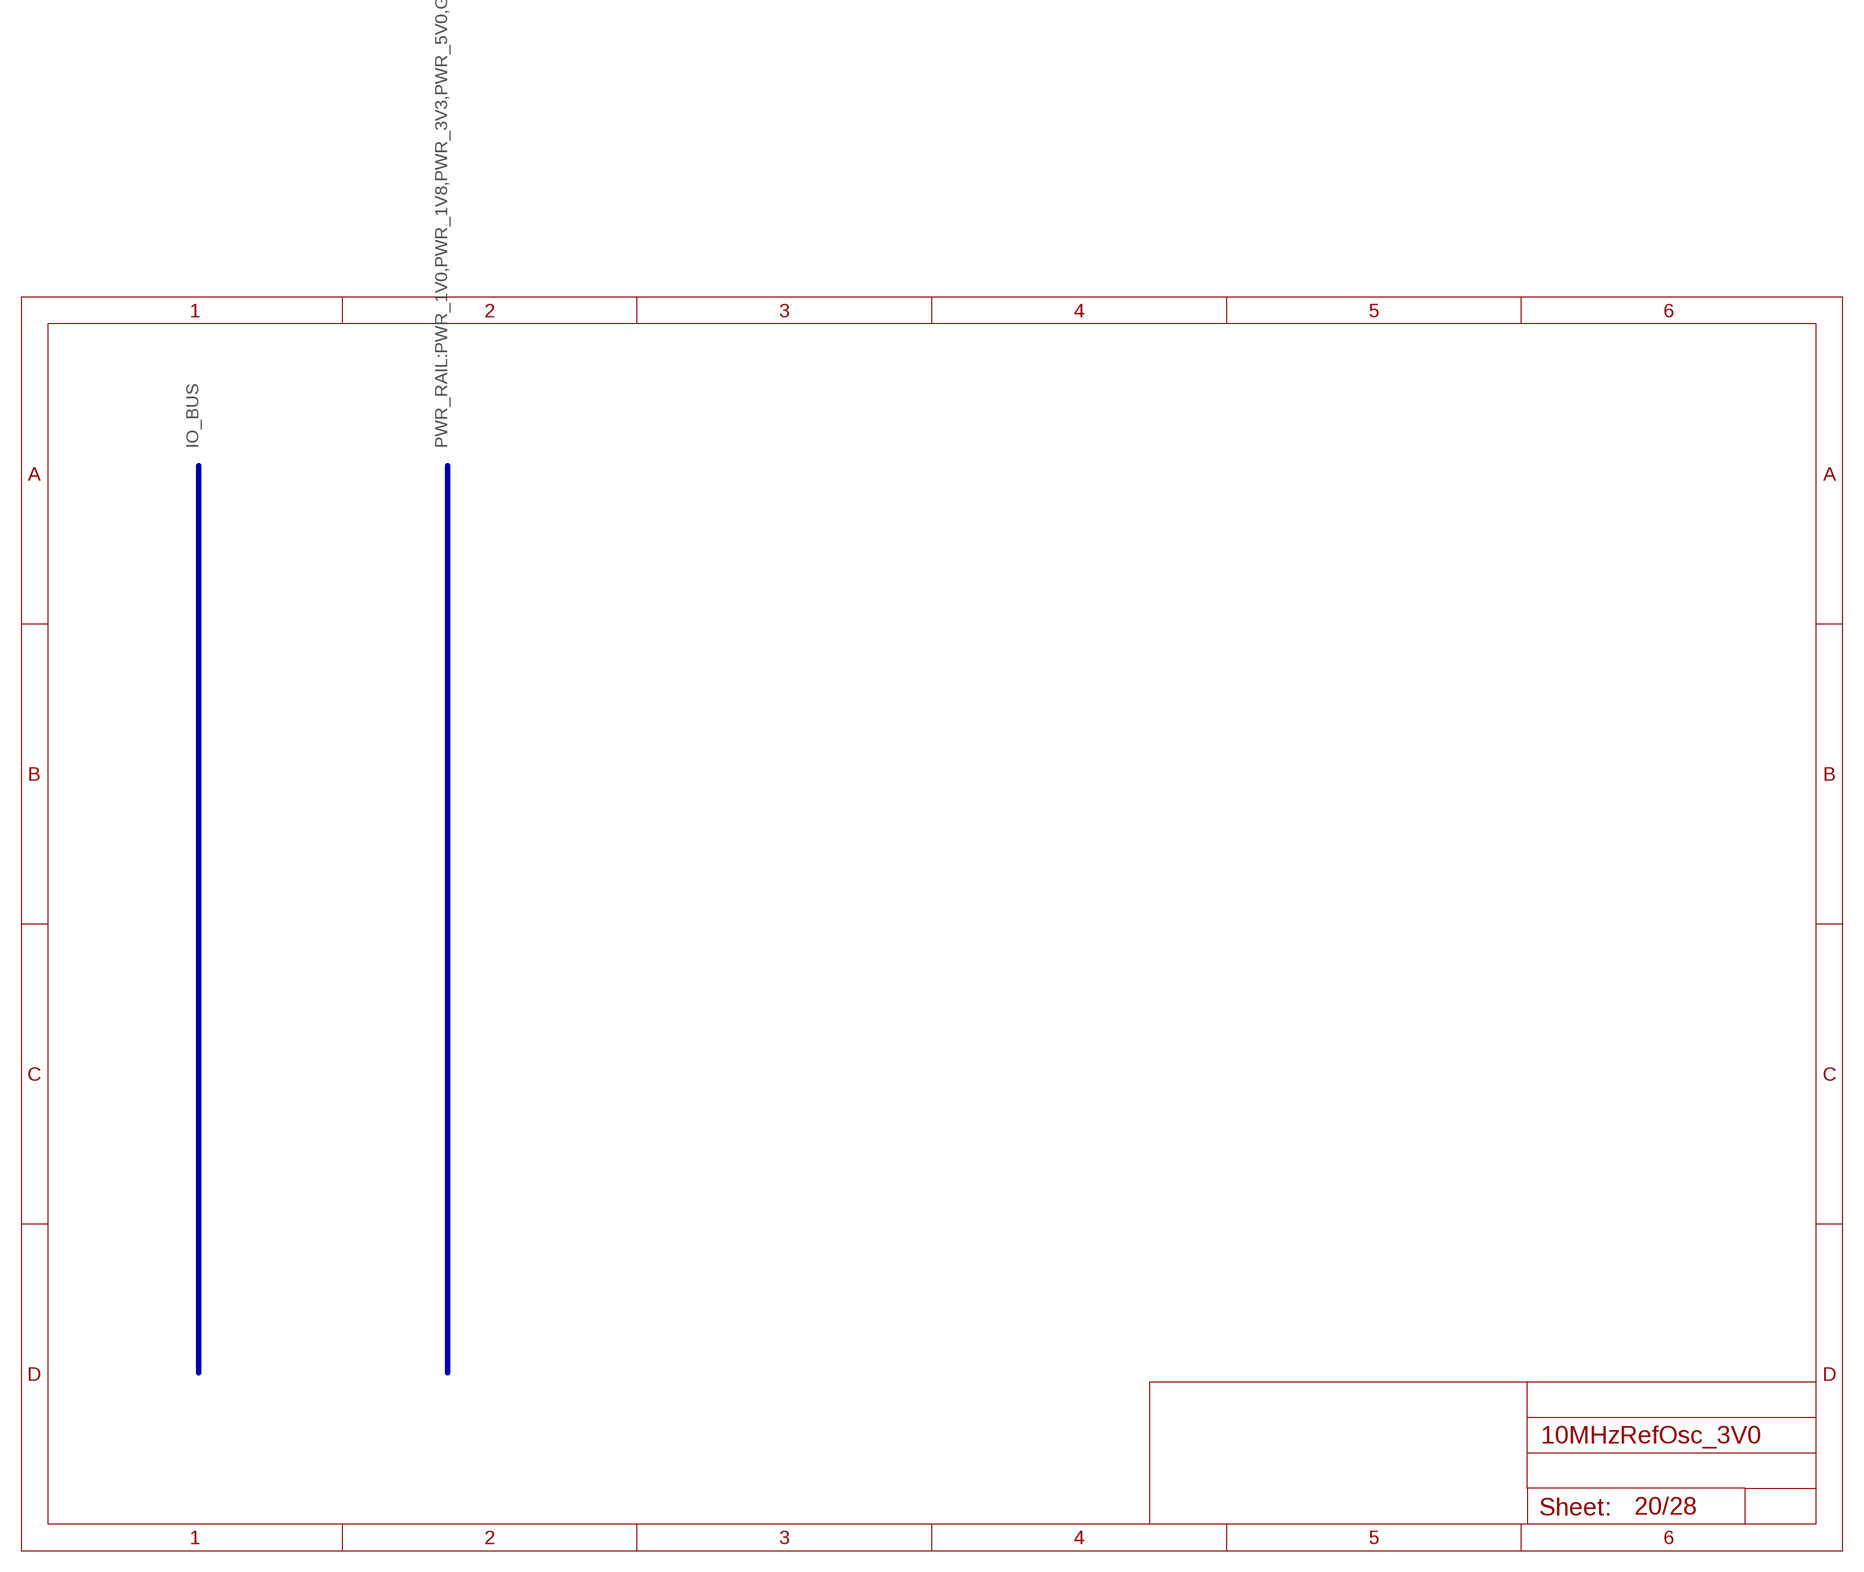
[diagram p19: schematic, sheet 20]

### Buses
IO_BUS
PWR_RAIL:PWR_1V0,PWR_1V8,PWR_3V3,PWR_5V0,GND

## Sheet 21 of 28: Socket_1
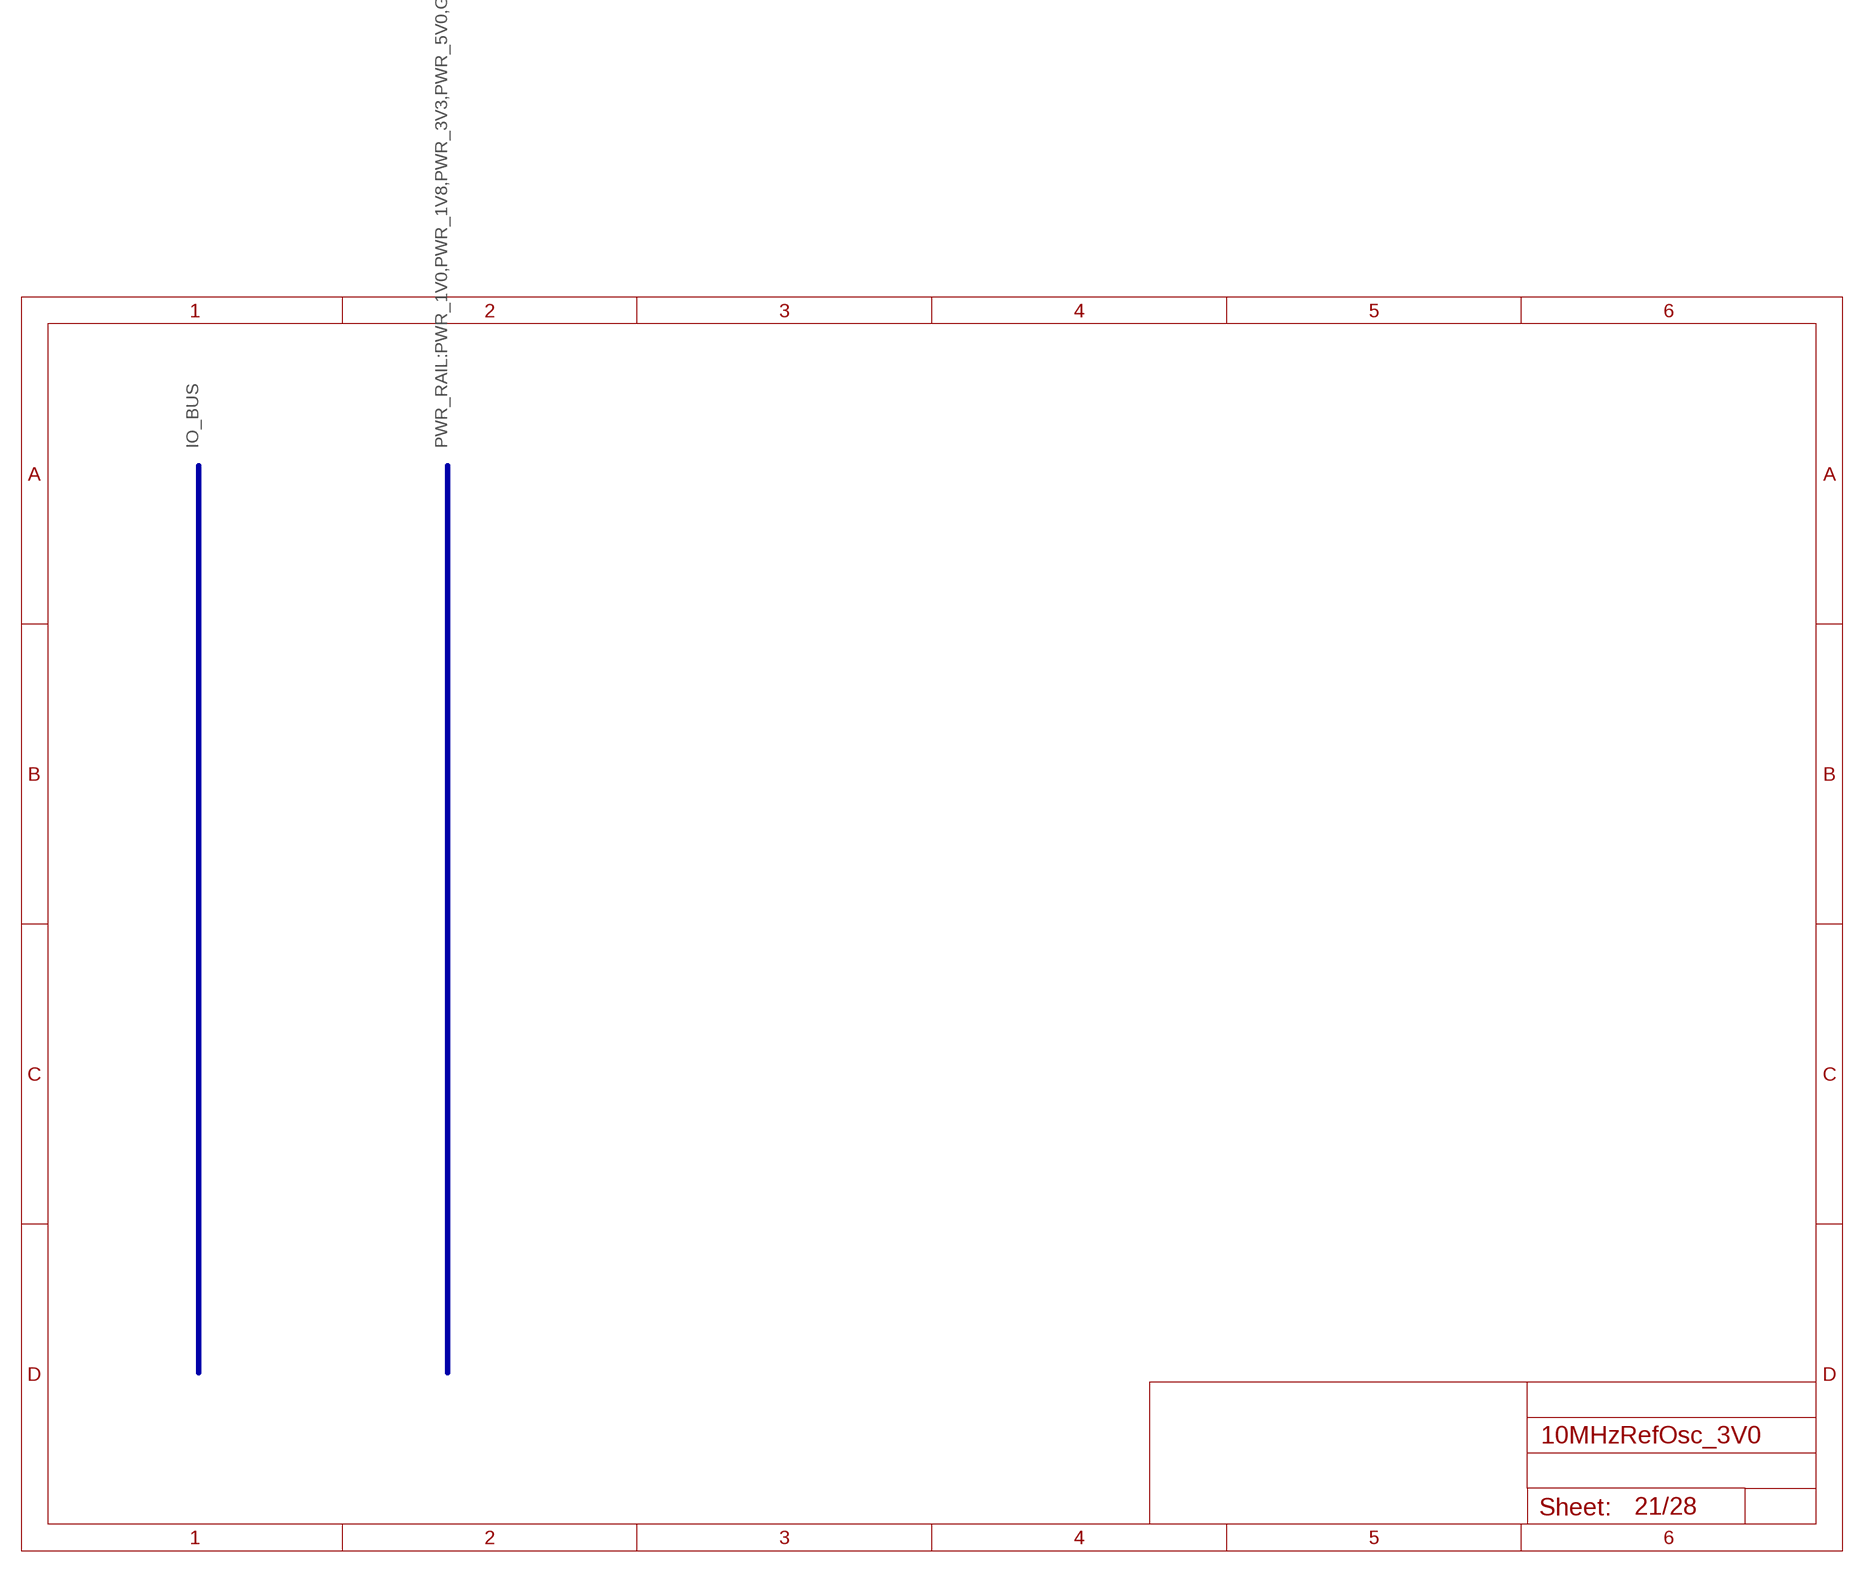
[diagram p20: schematic, sheet 21]

### Buses
IO_BUS
PWR_RAIL:PWR_1V0,PWR_1V8,PWR_3V3,PWR_5V0,GND

## Sheet 22 of 28: Socket_2
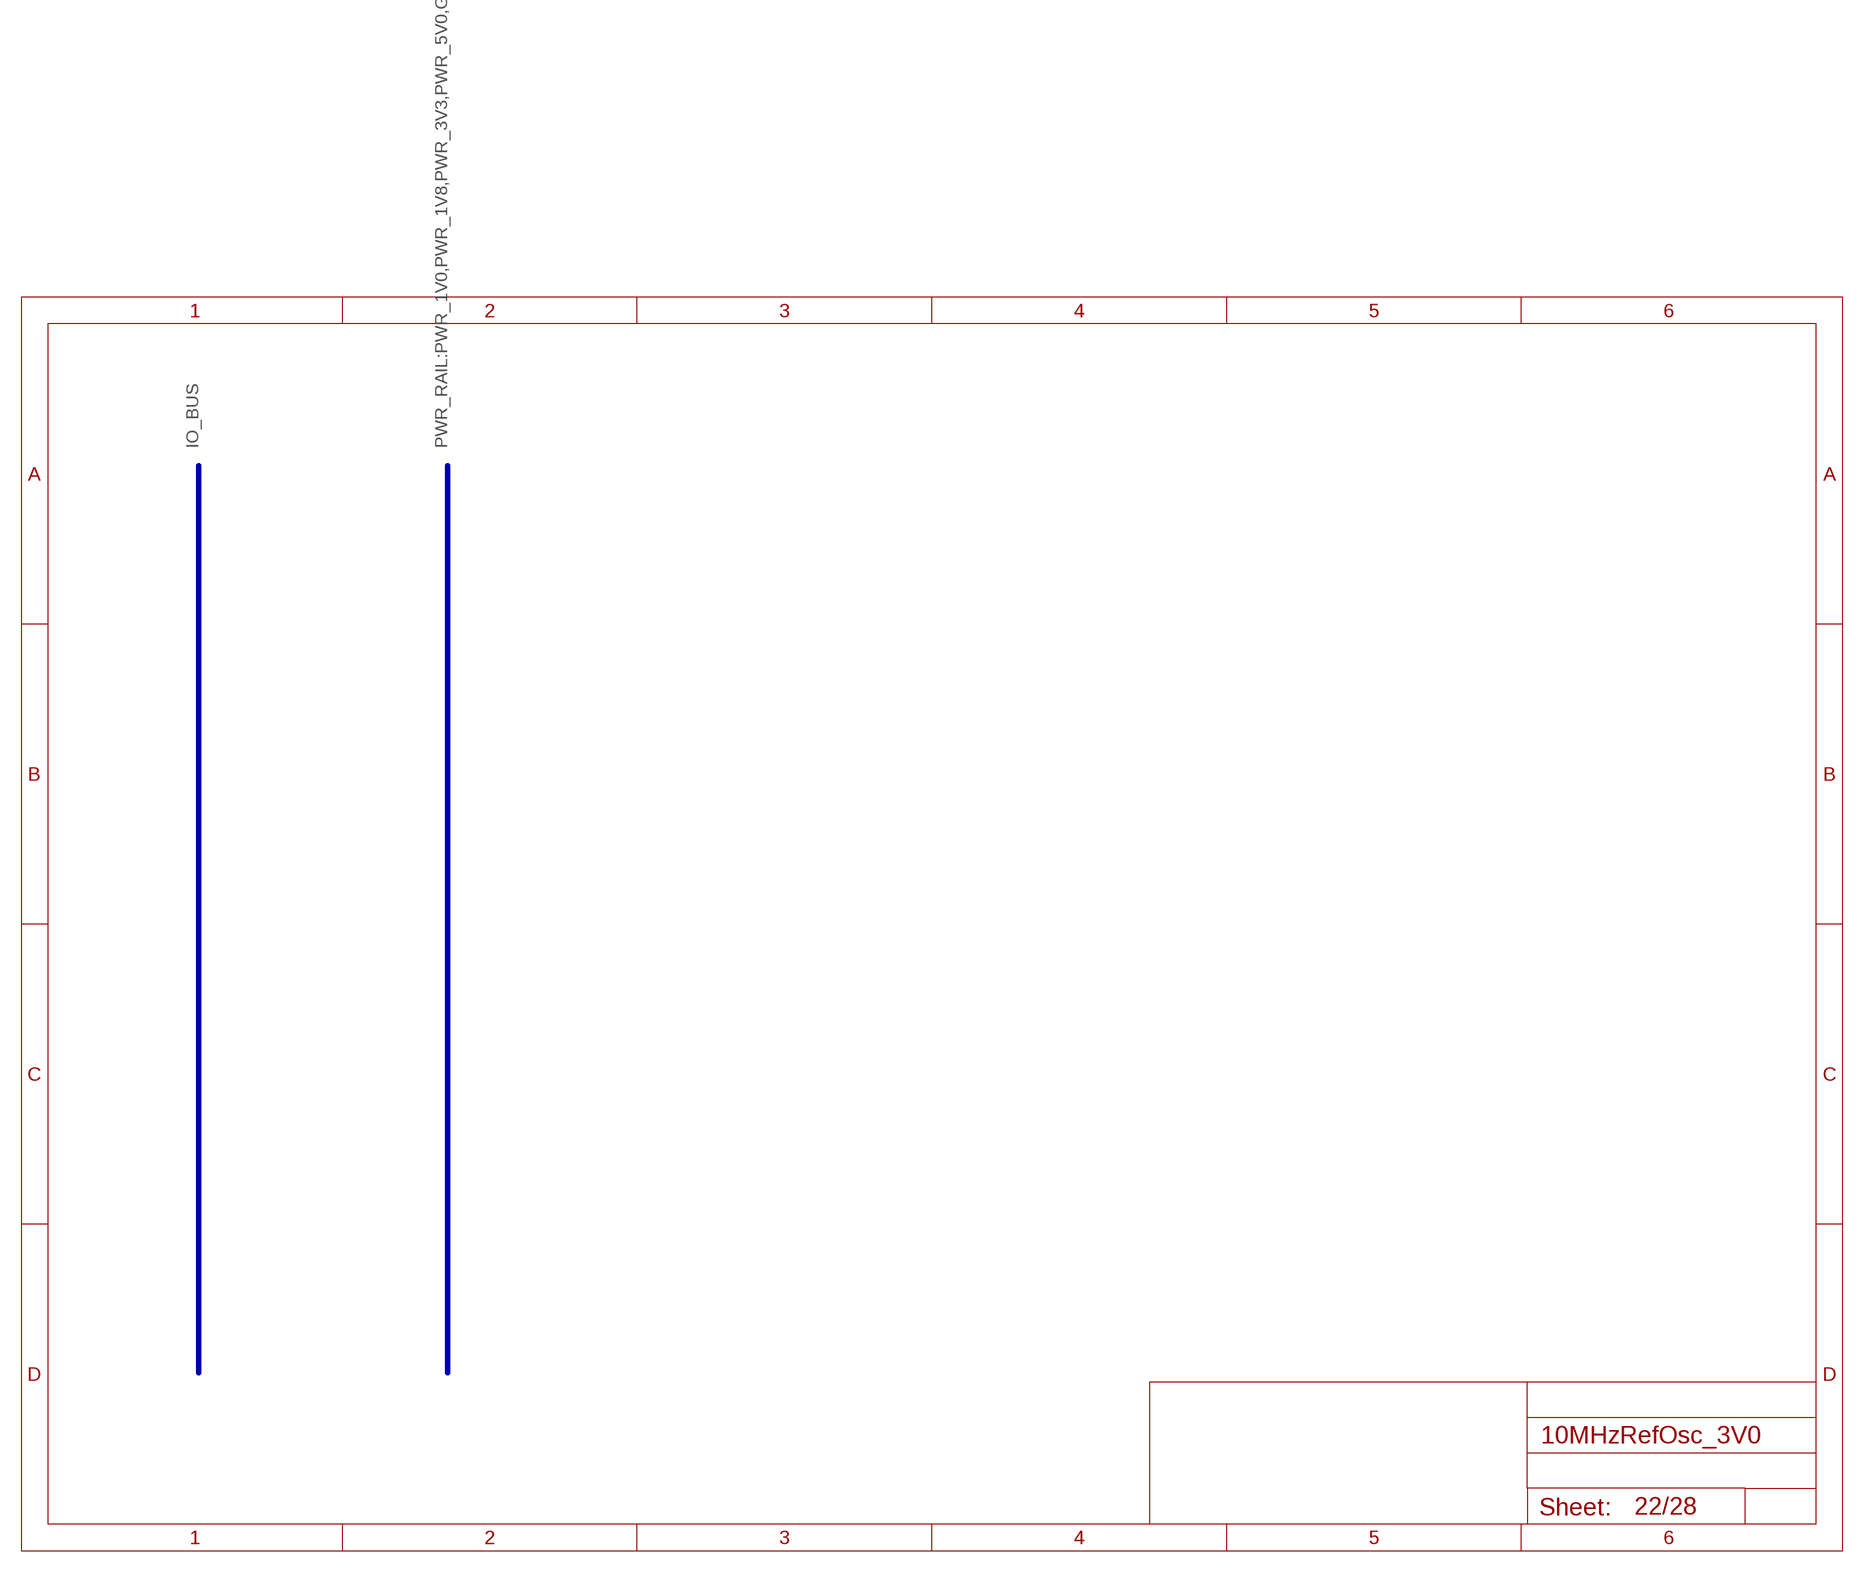
[diagram p21: schematic, sheet 22]

### Buses
IO_BUS
PWR_RAIL:PWR_1V0,PWR_1V8,PWR_3V3,PWR_5V0,GND

## Sheet 23 of 28: Socket_3
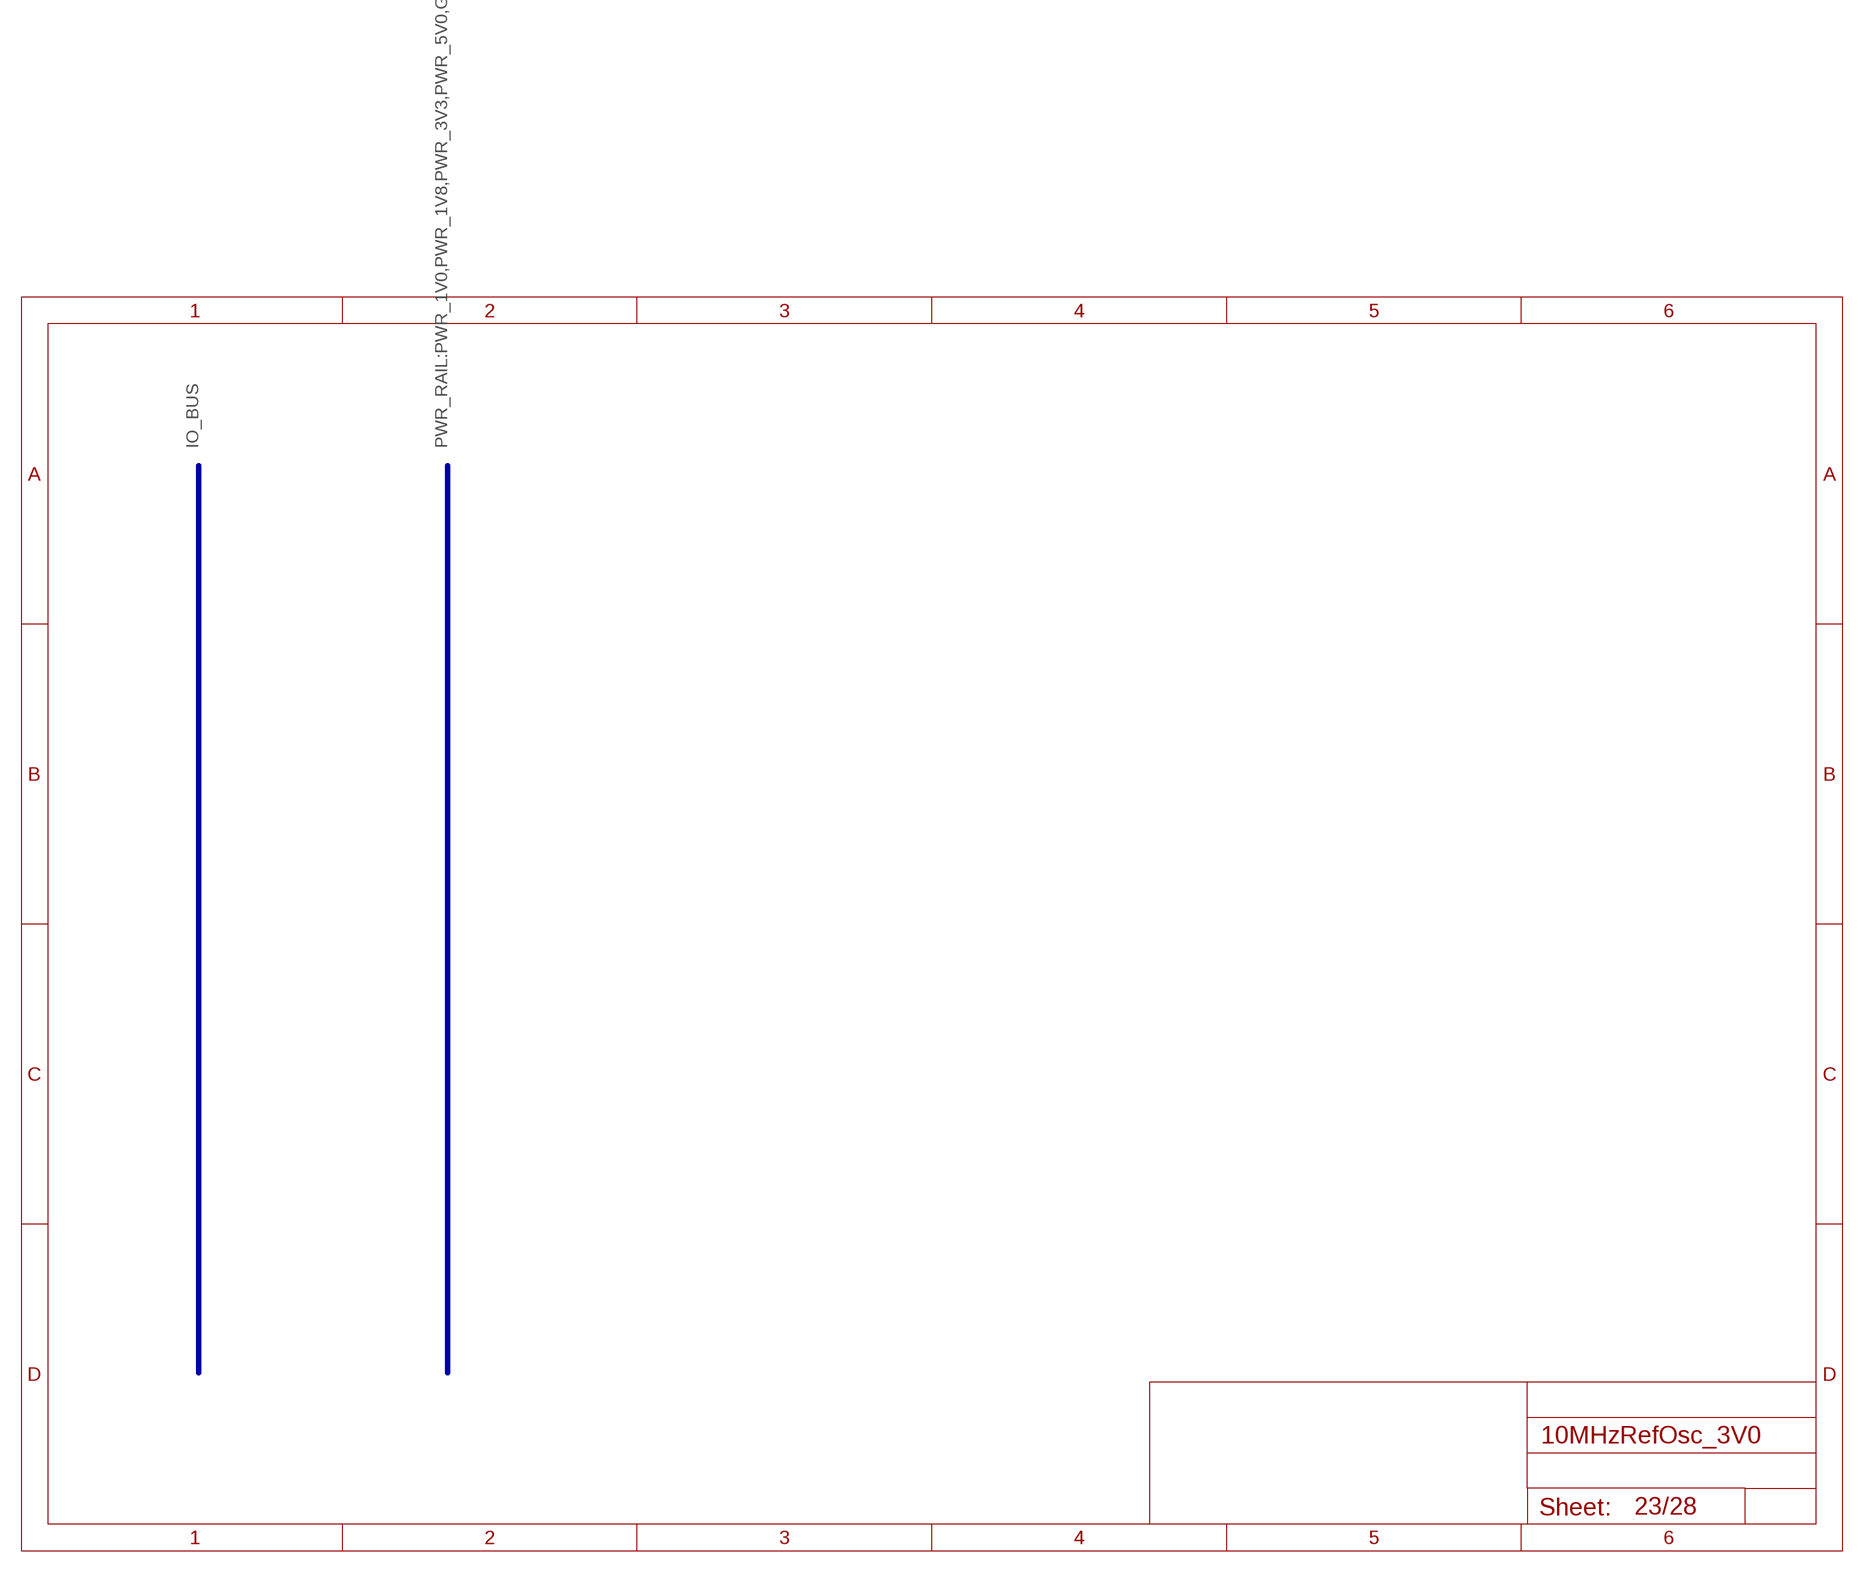
[diagram p22: schematic, sheet 23]

### Buses
IO_BUS
PWR_RAIL:PWR_1V0,PWR_1V8,PWR_3V3,PWR_5V0,GND

## Sheet 24 of 28: Socket_4
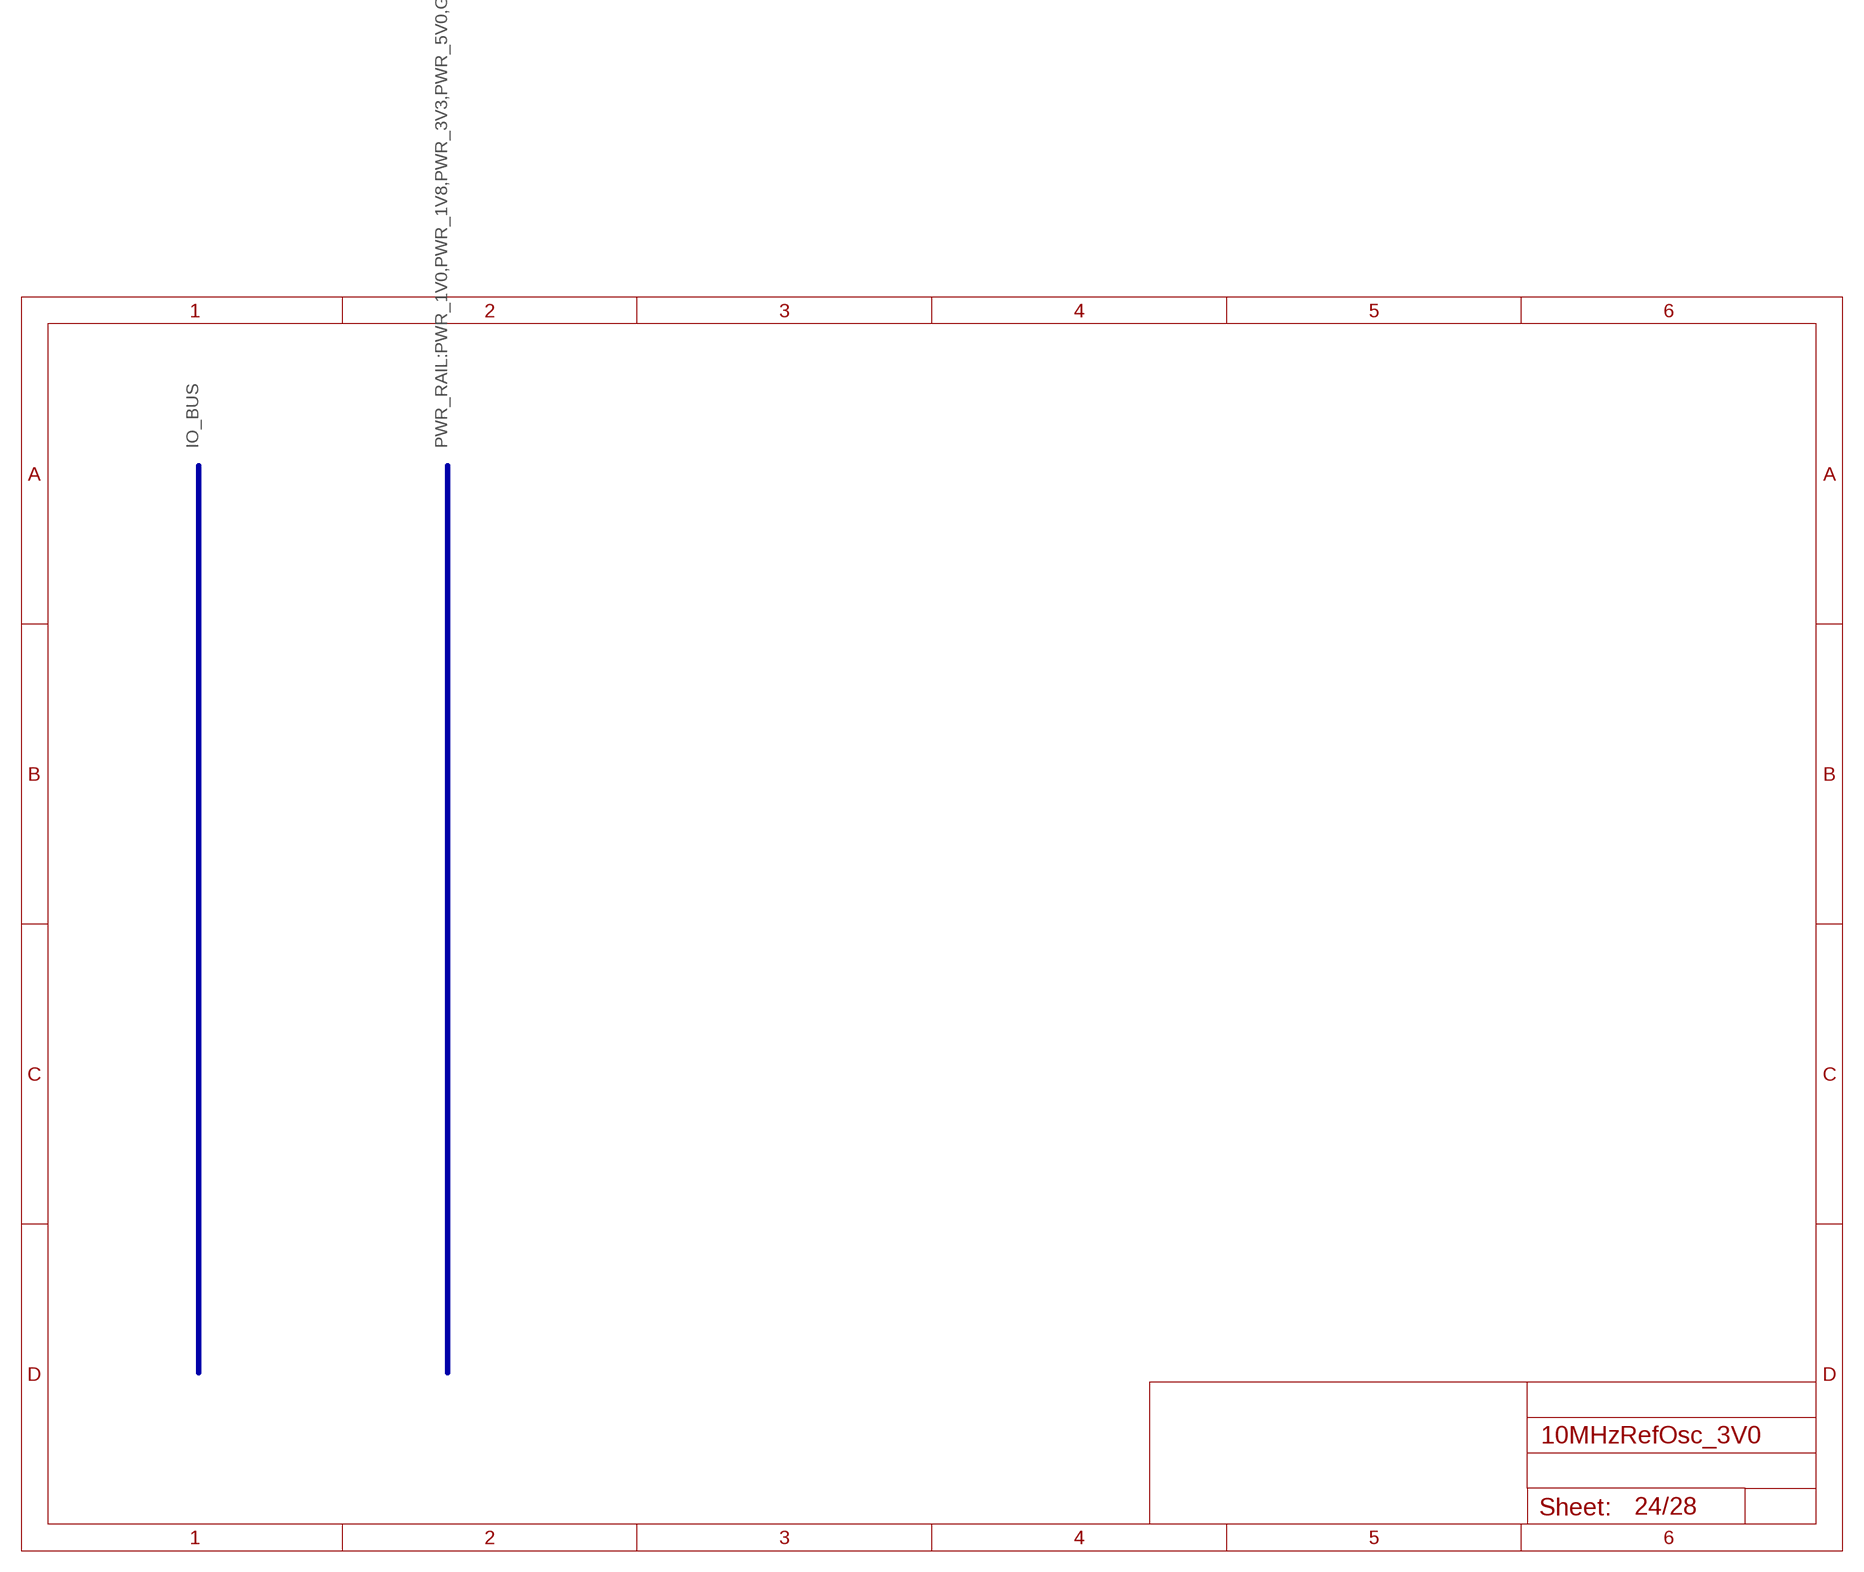
[diagram p23: schematic, sheet 24]

### Buses
IO_BUS
PWR_RAIL:PWR_1V0,PWR_1V8,PWR_3V3,PWR_5V0,GND